# EAGLE schematic boardv2a (EAGLE 6.6.0), part 1 of 2

## Sheet 1 of 28

## Sheet 2 of 28: connector block
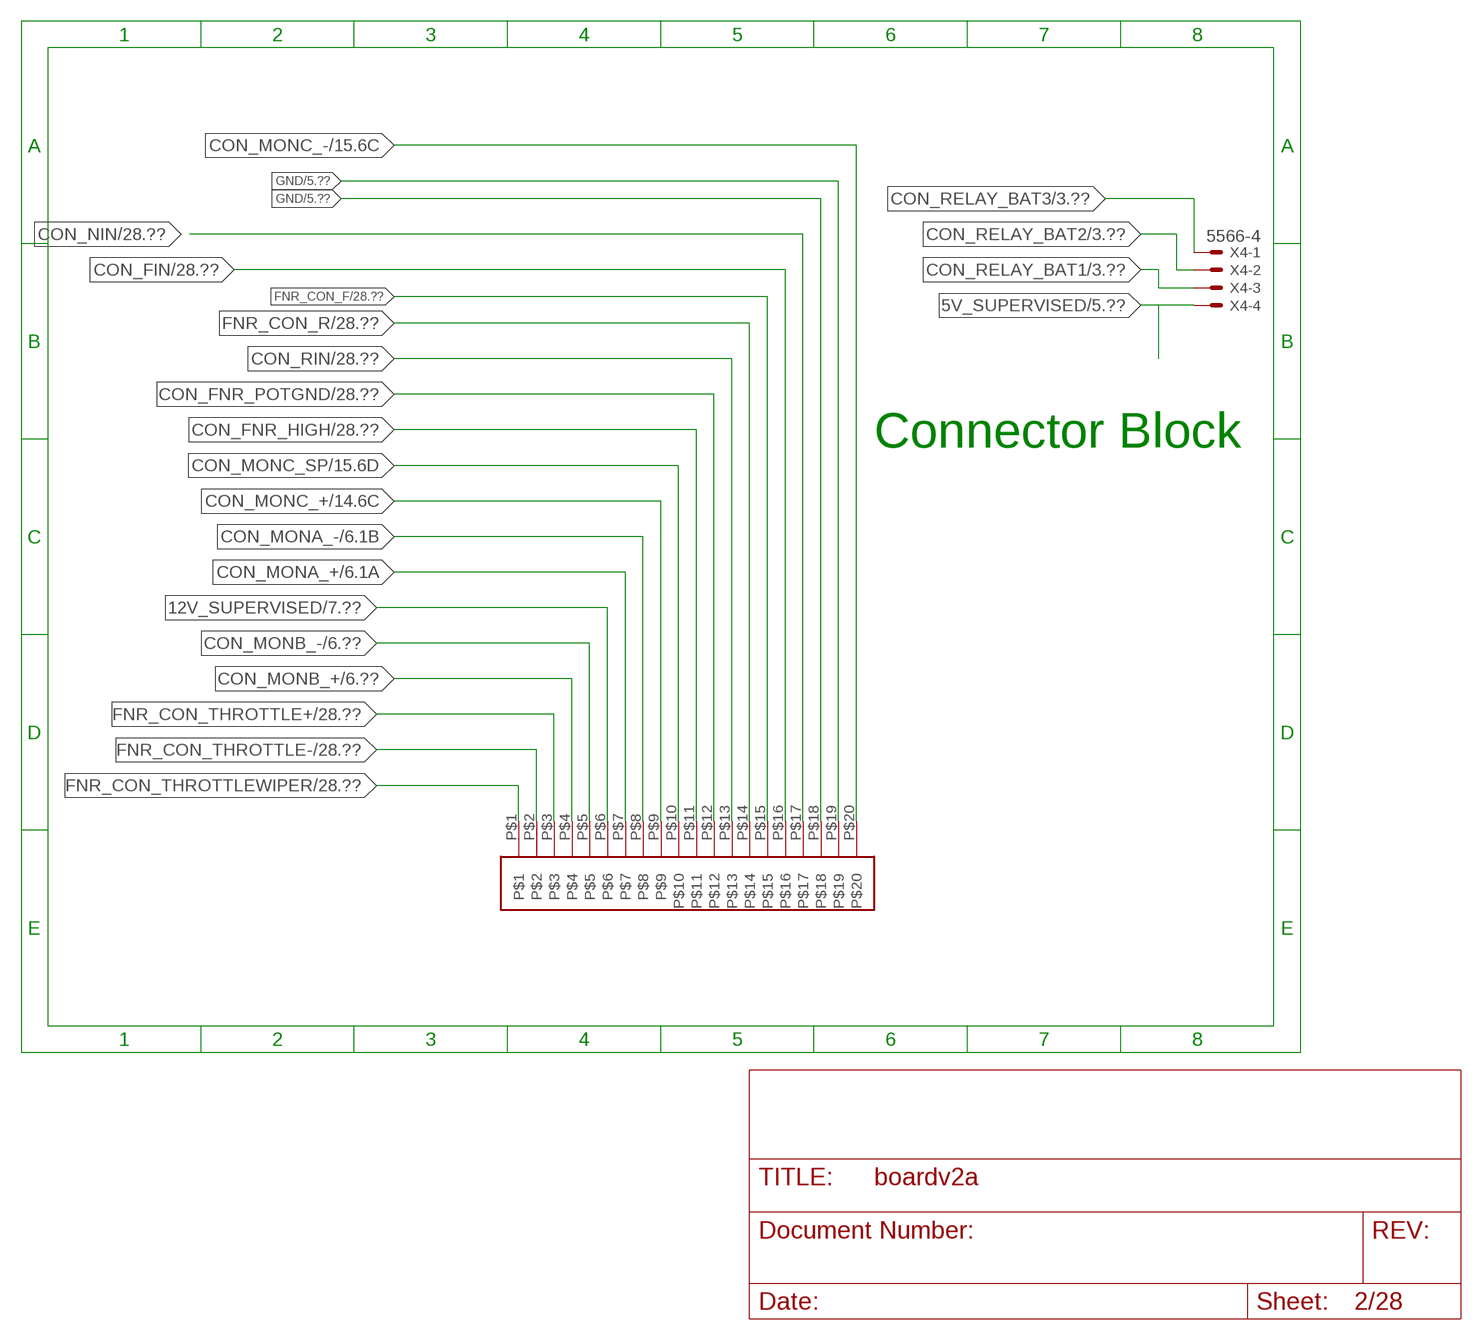
[diagram p0: schematic, sheet 2]

### Parts
U$5  34830-2001  [34830-2001]
X4  5566-4  [5566-4]

### Nets
5V_SUPERVISED: X4.4 ; also sheet 5,7,13,14,15,19,20,21,22,23,24,25,26
12V_SUPERVISED: U$5.P$6 ; also sheet 7
CON_FIN: U$5.P$16 ; also sheet 28
CON_FNR_HIGH: U$5.P$11 ; also sheet 28
CON_FNR_POTGND: U$5.P$12 ; also sheet 28
CON_MONA_+: U$5.P$7 ; also sheet 6,13
CON_MONA_-: U$5.P$8 ; also sheet 6,13
CON_MONB_+: U$5.P$4 ; also sheet 6,13,14
CON_MONB_-: U$5.P$5 ; also sheet 6,14,28
CON_MONC_+: U$5.P$9 ; also sheet 14,15
CON_MONC_-: U$5.P$20 ; also sheet 15
CON_MONC_SP: U$5.P$10 ; also sheet 15
CON_NIN: U$5.P$17 ; also sheet 28
CON_RELAY_BAT1: X4.3 ; also sheet 3
CON_RELAY_BAT2: X4.2 ; also sheet 3
CON_RELAY_BAT3: X4.1 ; also sheet 3
CON_RIN: U$5.P$13 ; also sheet 28
FNR_CON_F: U$5.P$15 ; also sheet 28
FNR_CON_R: U$5.P$14 ; also sheet 28
FNR_CON_THROTTLE+: U$5.P$3 ; also sheet 28
FNR_CON_THROTTLE-: U$5.P$2 ; also sheet 28
FNR_CON_THROTTLEWIPER: U$5.P$1 ; also sheet 28
GND: U$5.P$18 U$5.P$19 ; also sheet 3,4,5,6,7,8,9,12,13,14,15,17,18,19,20,21,22,23,24,25,26,28

### Notes on the sheet
- Connector Block

## Sheet 3 of 28: Relay
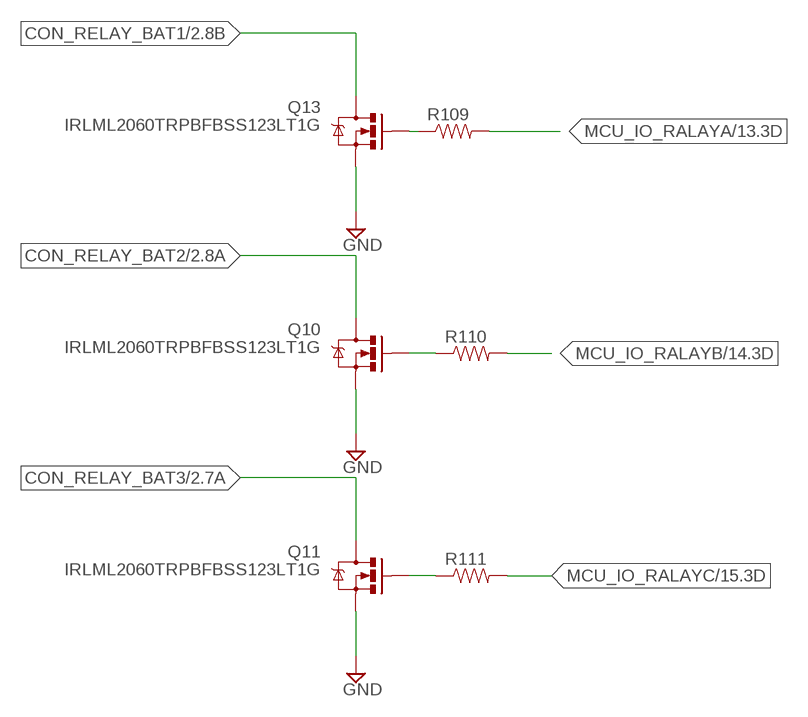
[diagram p1: schematic, sheet 3]

### Parts
Q10  IRLML2060TRPBFBSS123LT1G  [SOT23-3]
Q11  IRLML2060TRPBFBSS123LT1G  [SOT23-3]
Q13  IRLML2060TRPBFBSS123LT1G  [SOT23-3]
R109  RESISTOR0603-RES  [0603-RES]
R110  RESISTOR0603-RES  [0603-RES]
R111  RESISTOR0603-RES  [0603-RES]

### Nets
CON_RELAY_BAT1: Q13.3(D) ; also sheet 2
CON_RELAY_BAT2: Q10.3(D) ; also sheet 2
CON_RELAY_BAT3: Q11.3(D) ; also sheet 2
GND: Q10.2(S) Q11.2(S) Q13.2(S) ; also sheet 2,4,5,6,7,8,9,12,13,14,15,17,18,19,20,21,22,23,24,25,26,28
MCU_IO_RALAYA: R109.2 ; also sheet 13
MCU_IO_RALAYB: R110.2 ; also sheet 14
MCU_IO_RALAYC: R111.2 ; also sheet 15
N$252: Q13.1(G) R109.1
N$255: Q11.1(G) R111.1
N$257: Q10.1(G) R110.1

## Sheet 4 of 28: SPI to USB
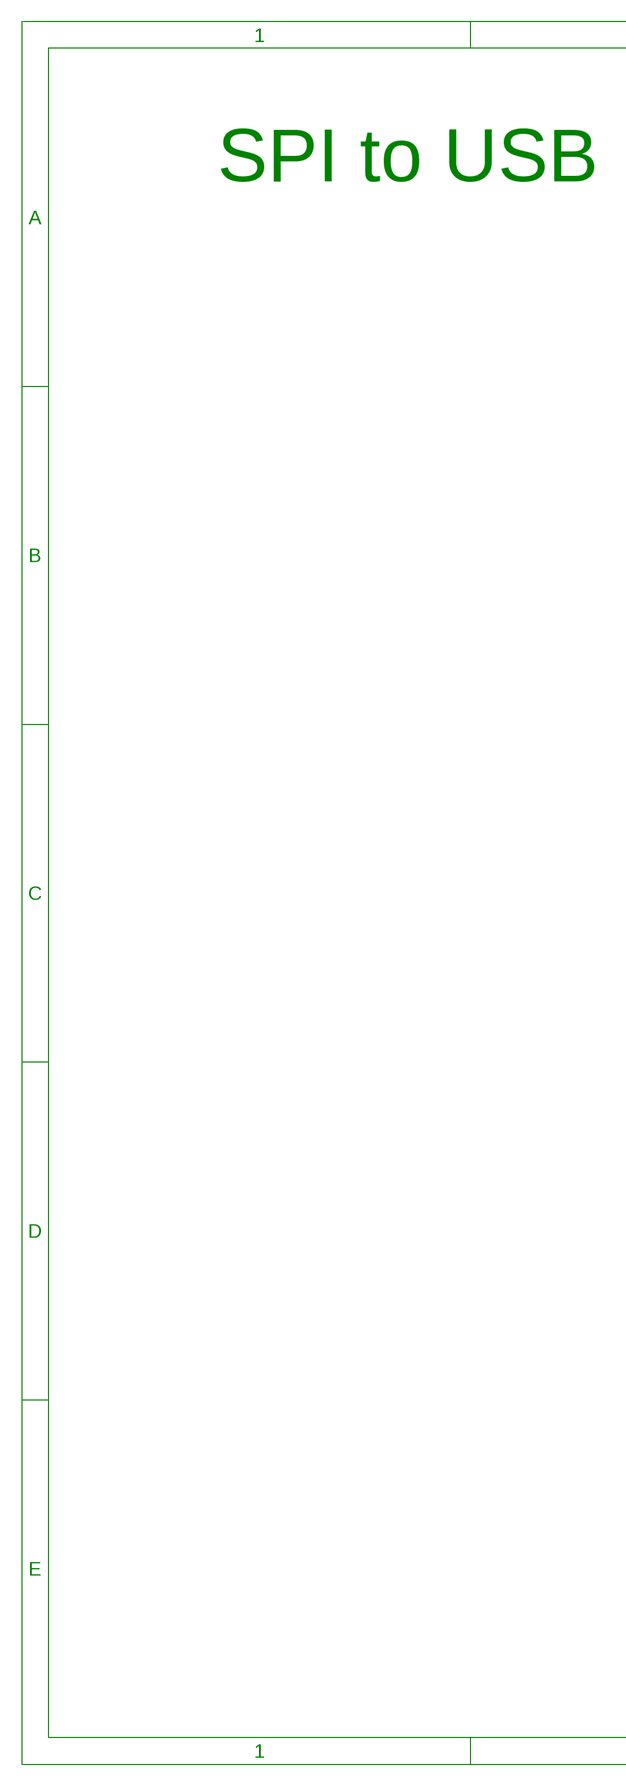
[diagram p2: schematic, sheet 4, part 1 of 2]
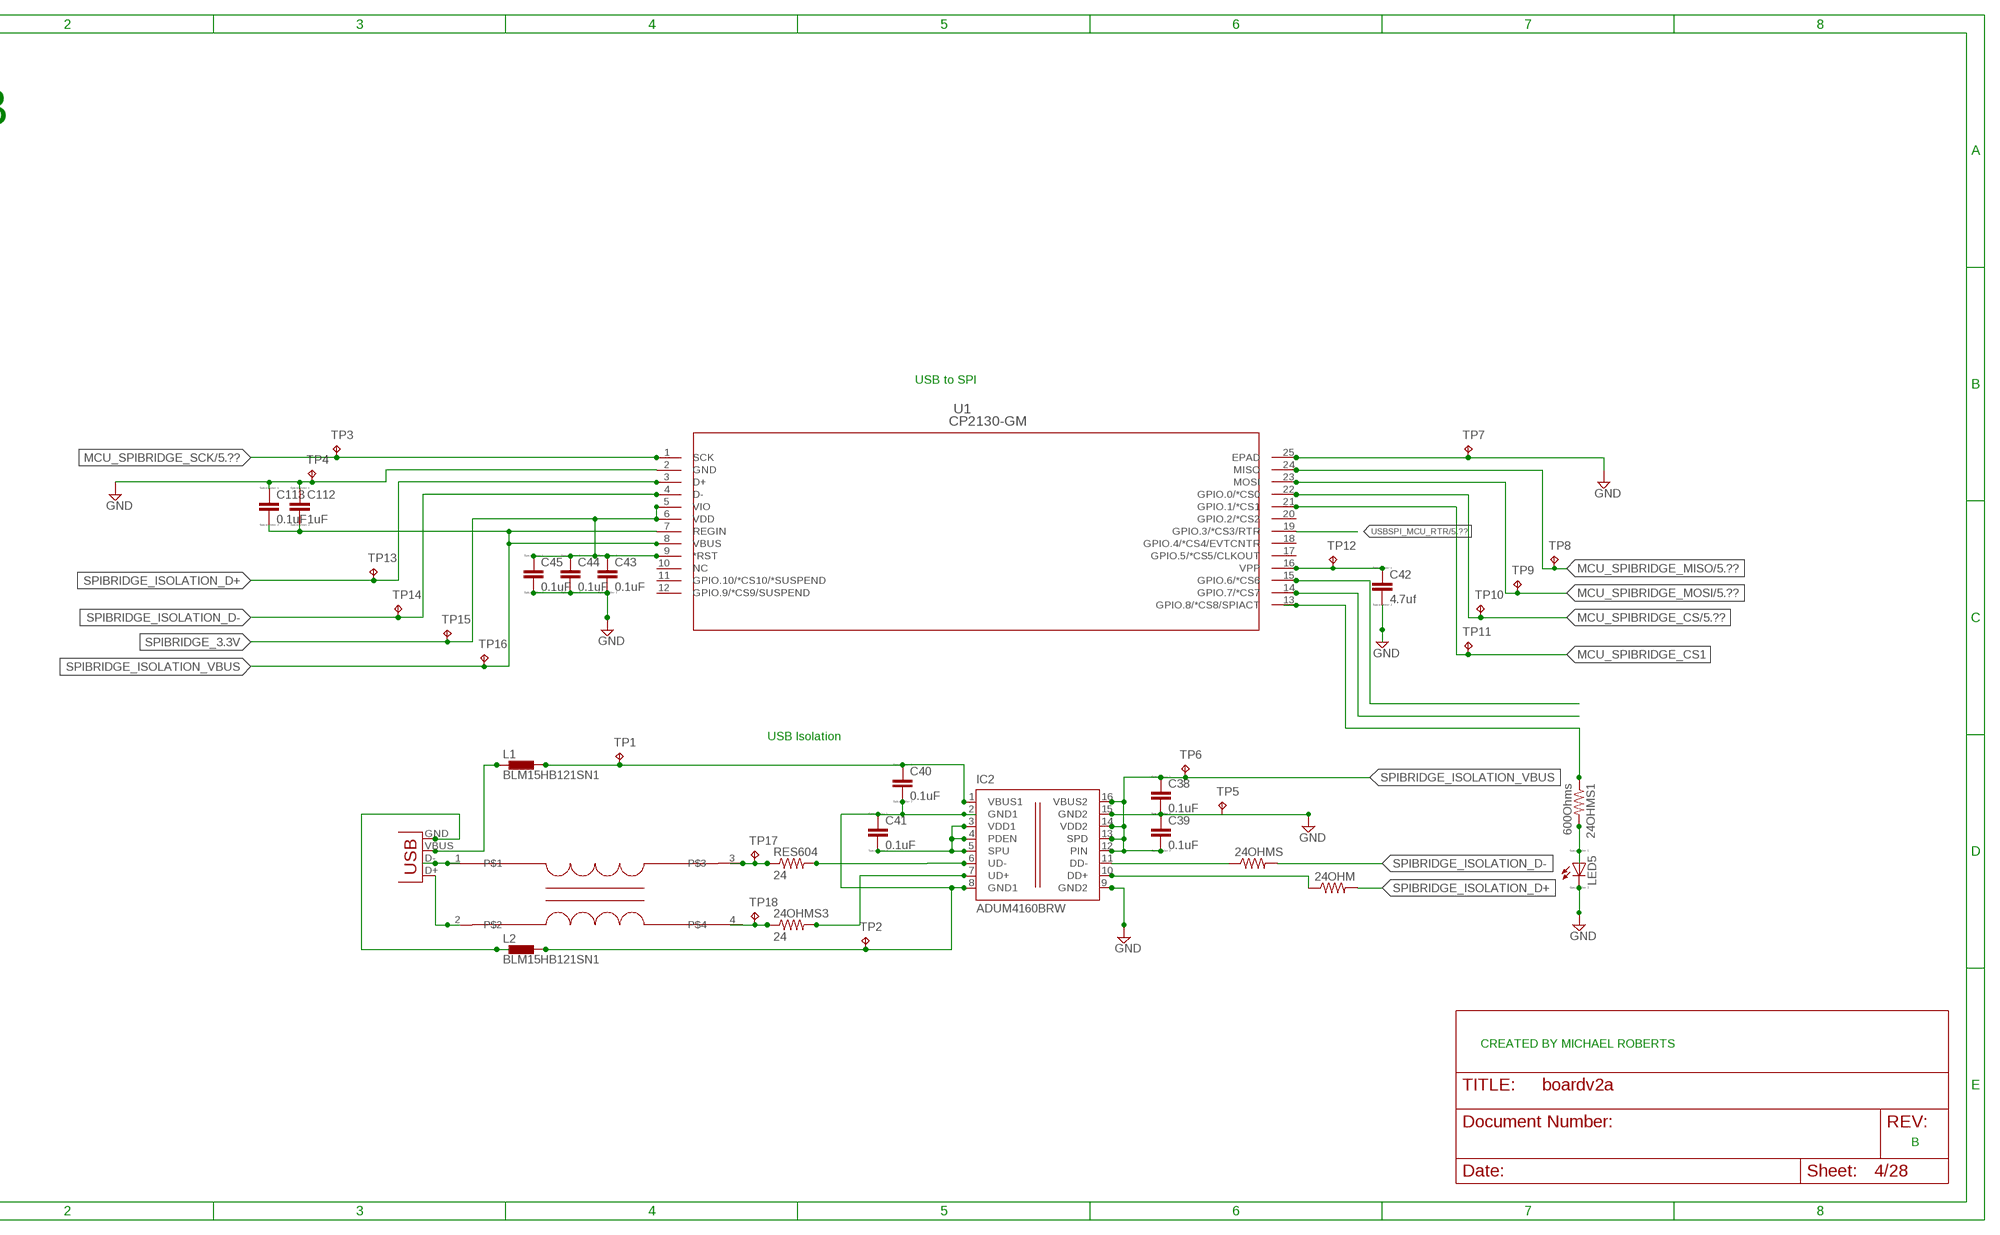
[diagram p3: schematic, sheet 4, part 2 of 2]

### Parts
24OHM  RESISTOR0603-RES  [0603-RES]
24OHMS  RESISTOR0603-RES  [0603-RES]
24OHMS1  600Ohms  RESISTOR0603-RES  [0603-RES]
24OHMS3  24  RESISTOR0603-RES  [0603-RES]
C38  0.1uF  CC0603  [C0603]
C39  0.1uF  CC0603  [C0603]
C40  0.1uF  CC0603  [C0603]
C41  0.1uF  CC0603  [C0603]
C42  4.7uf  CC0603  [C0603]
C43  0.1uF  CC0603  [C0603]
C44  0.1uF  CC0603  [C0603]
C45  0.1uF  CC0603  [C0603]
C112  1uF  CC0603  [C0603]
C113  0.1uF  CC0603  [C0603]
IC2  ADUM4160BRW  [SO16W]
JP81  USB-B  USBPTH  [USB-B-PTH]
L1  BLM15HB121SN1  [0402]
L2  BLM15HB121SN1  [0402]
LED5  LED_E  [LED_1206]
RES604  24  RESISTOR0603-RES  [0603-RES]
TP1  TPB1,27  [B1,27]
TP2  TPB1,27  [B1,27]
TP3  TPB1,27  [B1,27]
TP4  TPB1,27  [B1,27]
TP5  TPB1,27  [B1,27]
TP6  TPB1,27  [B1,27]
TP7  TPB1,27  [B1,27]
TP8  TPB2,54  [B2,54]
TP9  TPB2,54  [B2,54]
TP10  TPB2,54  [B2,54]
TP11  TPB2,54  [B2,54]
TP12  TPB1,27  [B1,27]
TP13  TPB1,27  [B1,27]
TP14  TPB1,27  [B1,27]
TP15  TPB1,27  [B1,27]
TP16  TPB1,27  [B1,27]
TP17  TPB2,54  [B2,54]
TP18  TPB2,54  [B2,54]
U1  CP2130-GM  [QFN24_4X4]
U$8  RFCMF1220100M3T  [RFCMF1220100M3T]

### Nets
GND: C38.2 C39.1 C42.2 C43.2 C44.2 C45.2 C112.1 C113.1 IC2.9(GND2) IC2.15(GND2) LED5.C TP4.TP TP5.TP TP7.TP U1.2(GND) U1.25(EPAD) ; also sheet 2,3,5,6,7,8,9,12,13,14,15,17,18,19,20,21,22,23,24,25,26,28
MCU_SPIBRIDGE_CS: TP10.TP U1.22(GPIO.0/*CS0) ; also sheet 5
MCU_SPIBRIDGE_CS1: TP11.TP U1.21(GPIO.1/*CS1)
MCU_SPIBRIDGE_MISO: TP8.TP U1.24(MISO) ; also sheet 5
MCU_SPIBRIDGE_MOSI: TP9.TP U1.23(MOSI) ; also sheet 5
MCU_SPIBRIDGE_SCK: TP3.TP U1.1(SCK) ; also sheet 5
N$114: 24OHMS.1 IC2.11(DD-)
N$115: 24OHMS3.1 TP18.TP U$8.4
N$144: 24OHMS3.2 IC2.7(UD+)
N$145: C40.2 C41.1 IC2.2(GND1) IC2.8(GND1) L2.2 TP2.TP
N$146: C40.1 IC2.1(VBUS1) L1.2 TP1.TP
N$148: JP81.D- U$8.1
N$149: JP81.D+ U$8.2
N$150: JP81.GND L2.1
N$151: C41.2 IC2.3(VDD1) IC2.4(PDEN) IC2.5(SPU)
N$152: C42.1 TP12.TP U1.16(VPP)
N$154: JP81.VBUS L1.1
N$155: 24OHMS1.1 U1.13(GPIO.8/*CS8/SPIACT)
N$156: U1.14(GPIO.7/*CS7)
N$157: U1.15(GPIO.6/*CS6)
N$158: 24OHMS1.2 LED5.A
N$159: IC2.6(UD-) RES604.2
N$160: RES604.1 TP17.TP U$8.3
N$162: 24OHM.1 IC2.10(DD+)
SPIBRIDGE_3.3V: C43.1 C44.1 C45.1 TP15.TP U1.5(VIO) U1.6(VDD) U1.9(*RST)
SPIBRIDGE_ISOLATION_D+: 24OHM.2 TP13.TP U1.3(D+)
SPIBRIDGE_ISOLATION_D-: 24OHMS.2 TP14.TP U1.4(D-)
SPIBRIDGE_ISOLATION_VBUS: C38.1 C39.2 C112.2 C113.2 IC2.12(PIN) IC2.13(SPD) IC2.14(VDD2) IC2.16(VBUS2) TP6.TP TP16.TP U1.7(REGIN) U1.8(VBUS)
USBSPI_MCU_RTR: U1.19(GPIO.3/*CS3/RTR) ; also sheet 5
Unconnected: U1.10(NC) U1.11(GPIO.10/*CS10/*SUSPEND) U1.12(GPIO.9/*CS9/SUSPEND) U1.17(GPIO.5/*CS5/CLKOUT) U1.18(GPIO.4/*CS4/EVTCNTR) U1.20(GPIO.2/*CS2)

### Notes on the sheet
- SPI to USB
- USB to SPI
- USB Isolation
- CREATED BY MICHAEL ROBERTS
- B

## Sheet 5 of 28: MCU Block
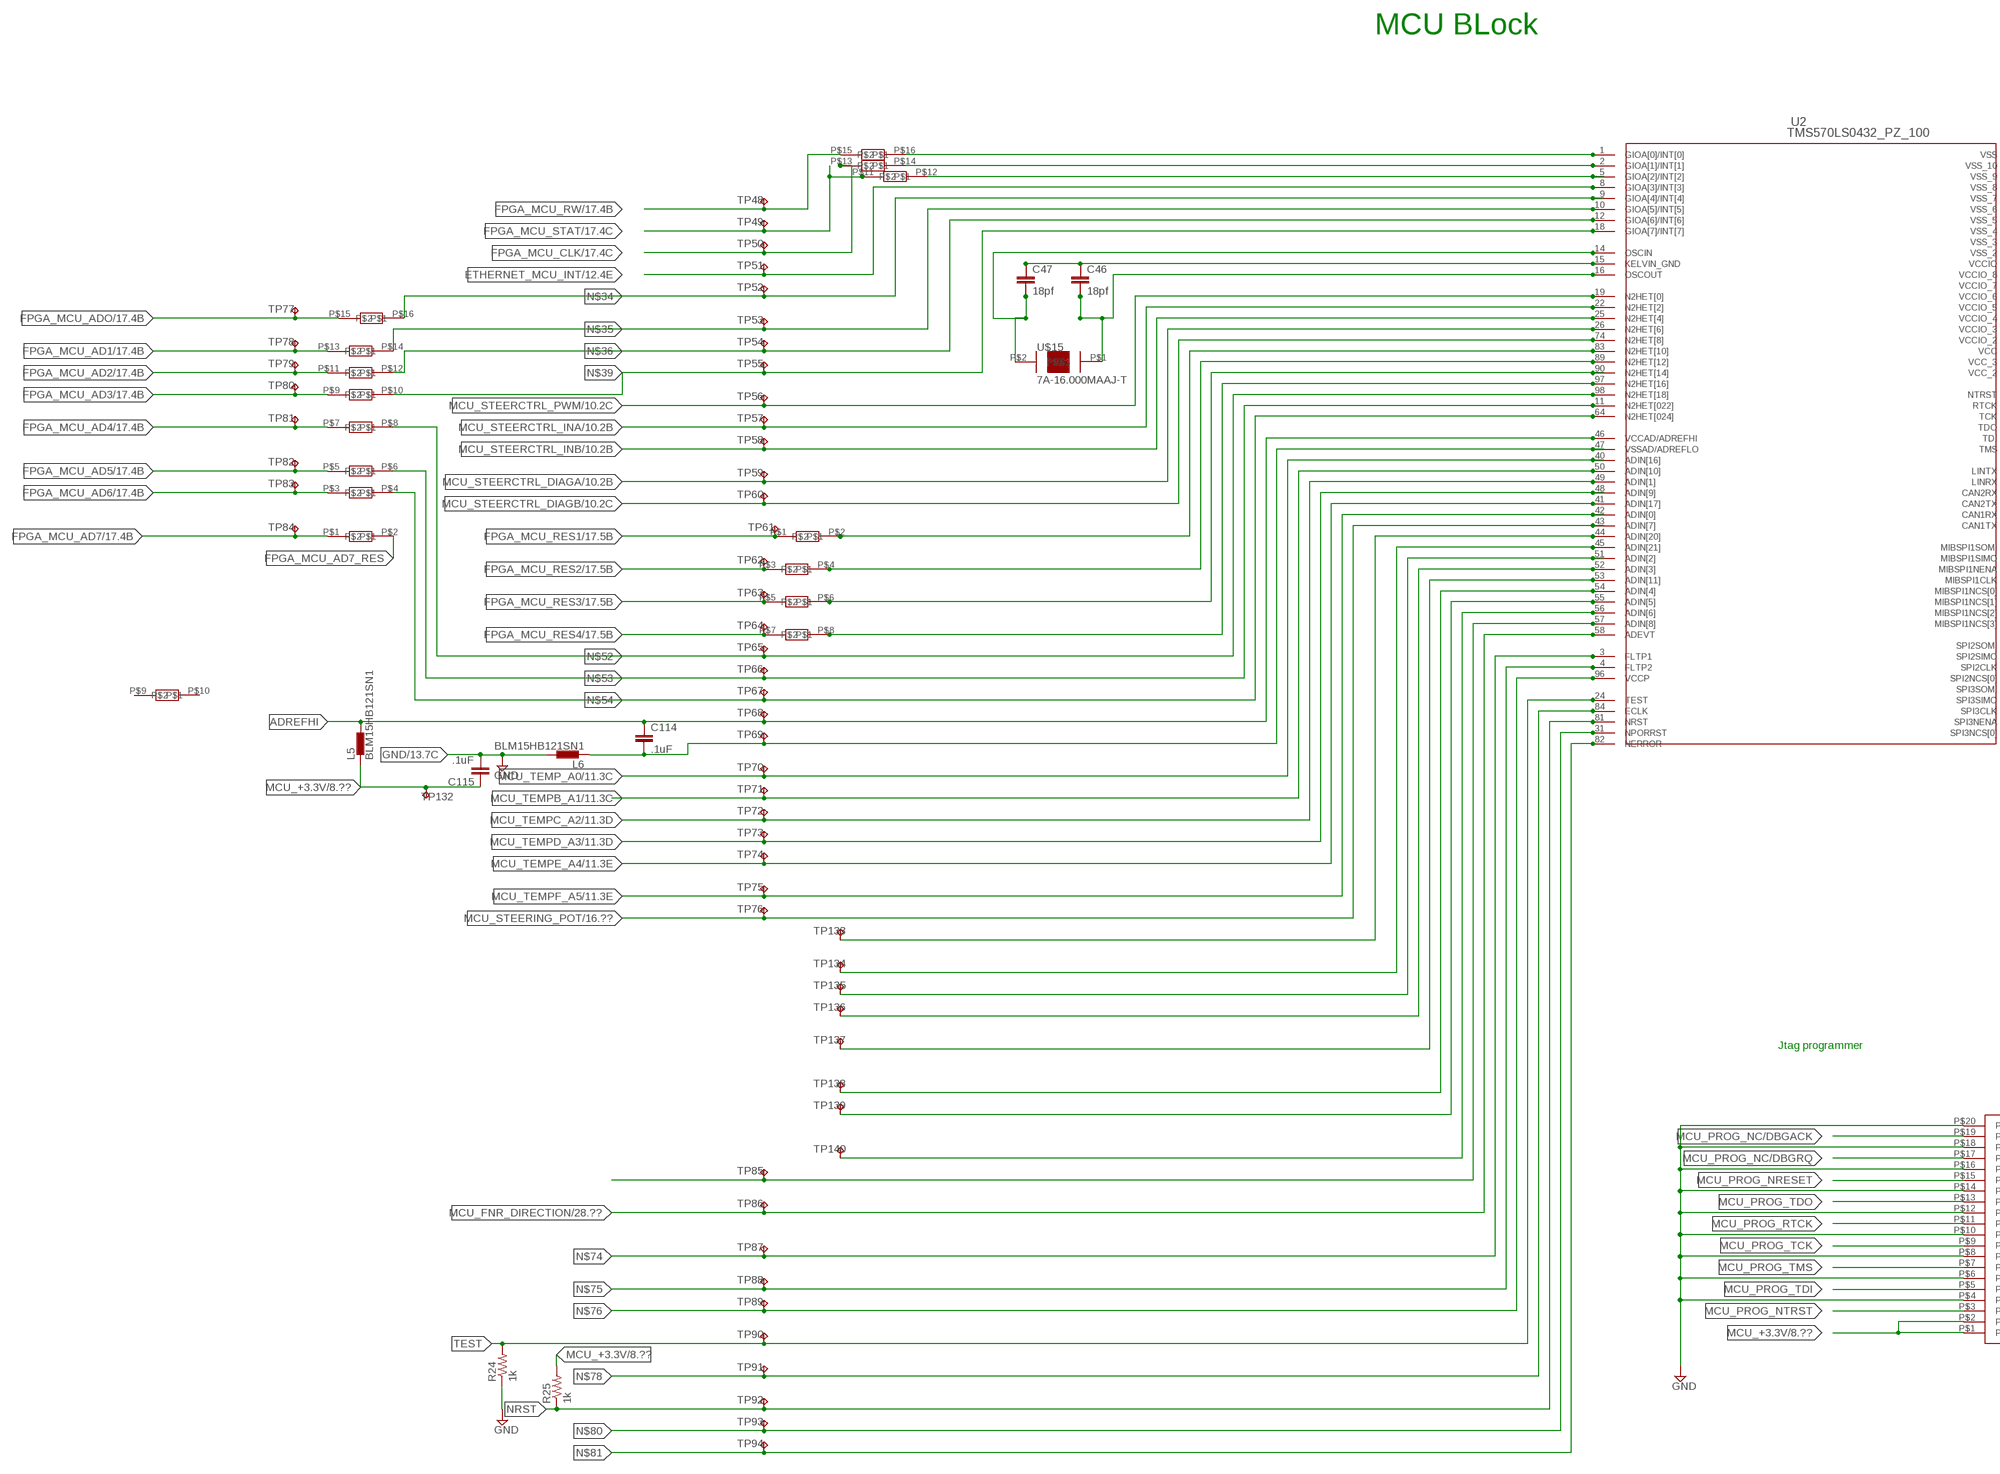
[diagram p4: schematic, sheet 5, part 1 of 2]
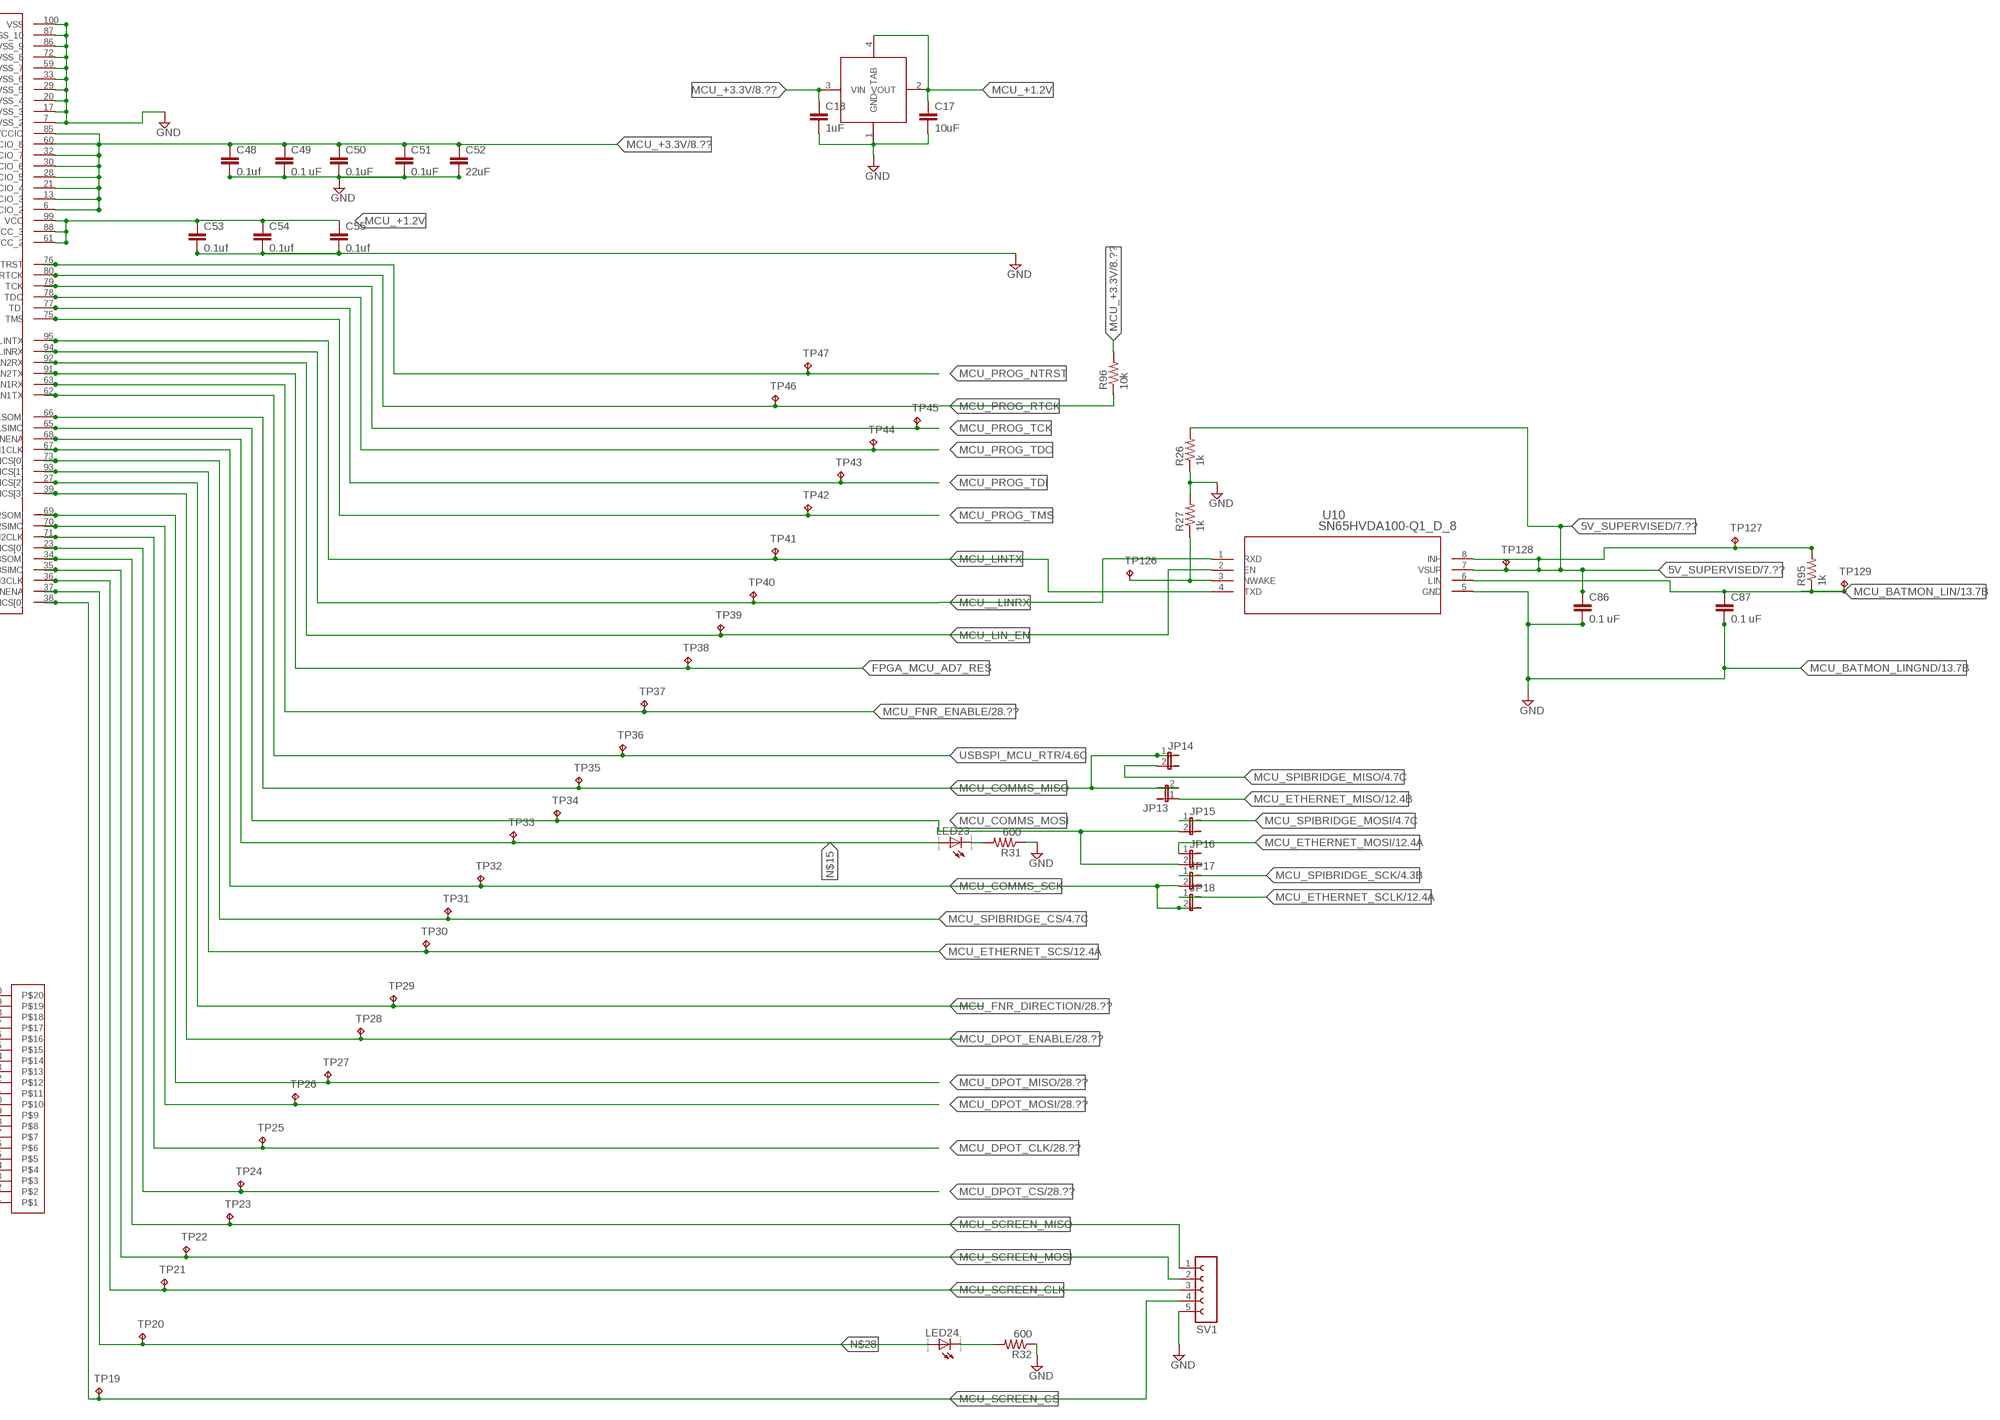
[diagram p5: schematic, sheet 5, part 2 of 2]

### Parts
C17  10uF  CAP0603-CAP  [0603-CAP]
C18  1uF  CAP0603-CAP  [0603-CAP]
C46  18pf  C-EUC0402  [C0402]
C47  18pf  C-EUC0402  [C0402]
C48  0.1uf  C-EUC0402  [C0402]
C49  0.1 uF  C-EUC0402  [C0402]
C50  0.1uF  C-EUC0402  [C0402]
C51  0.1uF  C-EUC0402  [C0402]
C52  22uF  C-EUC0603  [C0603]
C53  0.1uf  C-EUC0402  [C0402]
C54  0.1uf  C-EUC0402  [C0402]
C55  0.1uf  C-EUC0402  [C0402]
C86  0.1 uF  C-EUC0402  [C0402]
C87  0.1 uF  C-EUC0402  [C0402]
C114  .1uF  C-EUC0402  [C0402]
C115  .1uF  C-EUC0402  [C0402]
JP13  JP1E  [JP1]
JP14  JP1E  [JP1]
JP15  JP1E  [JP1]
JP16  JP1E  [JP1]
JP17  JP1E  [JP1]
JP18  JP1E  [JP1]
L5  BLM15HB121SN1  [0402]
L6  BLM15HB121SN1  [0402]
LED23  LED_E  [LED_1206]
LED24  LED_E  [LED_1206]
R24  1k  RESISTOR0603-RES  [0603-RES]
R25  1k  RESISTOR0603-RES  [0603-RES]
R26  1k  RESISTOR0603-RES  [0603-RES]
R27  1k  RESISTOR0603-RES  [0603-RES]
R31  600  RESISTOR0603-RES  [0603-RES]
R32  600  RESISTOR0603-RES  [0603-RES]
R95  1k  RESISTOR0603-RES  [0603-RES]
R96  10k  RESISTOR0603-RES  [0603-RES]
SV1  FE05-1  [FE05-1]
TP19  TPB2,54  [B2,54]
TP20  TPB2,54  [B2,54]
TP21  TPB2,54  [B2,54]
TP22  TPB2,54  [B2,54]
TP23  TPB2,54  [B2,54]
TP24  TPB2,54  [B2,54]
TP25  TPB2,54  [B2,54]
TP26  TPB2,54  [B2,54]
TP27  TPB2,54  [B2,54]
TP28  TPB2,54  [B2,54]
TP29  TPB2,54  [B2,54]
TP30  TPB2,54  [B2,54]
TP31  TPB2,54  [B2,54]
TP32  TPB2,54  [B2,54]
TP33  TPB2,54  [B2,54]
TP34  TPB2,54  [B2,54]
TP35  TPB2,54  [B2,54]
TP36  TPB2,54  [B2,54]
TP37  TPB2,54  [B2,54]
TP38  TPB2,54  [B2,54]
TP39  TPB2,54  [B2,54]
TP40  TPB2,54  [B2,54]
TP41  TPB2,54  [B2,54]
TP42  TPB2,54  [B2,54]
TP43  TPB2,54  [B2,54]
TP44  TPB2,54  [B2,54]
TP45  TPB2,54  [B2,54]
TP46  TPB2,54  [B2,54]
TP47  TPB2,54  [B2,54]
TP48  TPB2,54  [B2,54]
TP49  TPB2,54  [B2,54]
TP50  TPB2,54  [B2,54]
TP51  TPB2,54  [B2,54]
TP52  TPB2,54  [B2,54]
TP53  TPB2,54  [B2,54]
TP54  TPB2,54  [B2,54]
TP55  TPB2,54  [B2,54]
TP56  TPB2,54  [B2,54]
TP57  TPB2,54  [B2,54]
TP58  TPB2,54  [B2,54]
TP59  TPB2,54  [B2,54]
TP60  TPB2,54  [B2,54]
TP61  TPB2,54  [B2,54]
TP62  TPB2,54  [B2,54]
TP63  TPB2,54  [B2,54]
TP64  TPB2,54  [B2,54]
TP65  TPB2,54  [B2,54]
TP66  TPB2,54  [B2,54]
TP67  TPB2,54  [B2,54]
TP68  TPB2,54  [B2,54]
TP69  TPB2,54  [B2,54]
TP70  TPB2,54  [B2,54]
TP71  TPB2,54  [B2,54]
TP72  TPB2,54  [B2,54]
TP73  TPB2,54  [B2,54]
TP74  TPB2,54  [B2,54]
TP75  TPB2,54  [B2,54]
TP76  TPB2,54  [B2,54]
TP77  TPB2,54  [B2,54]
TP78  TPB2,54  [B2,54]
TP79  TPB2,54  [B2,54]
TP80  TPB2,54  [B2,54]
TP81  TPB2,54  [B2,54]
TP82  TPB2,54  [B2,54]
TP83  TPB2,54  [B2,54]
TP84  TPB2,54  [B2,54]
TP85  TPB2,54  [B2,54]
TP86  TPB2,54  [B2,54]
TP87  TPB2,54  [B2,54]
TP88  TPB2,54  [B2,54]
TP89  TPB2,54  [B2,54]
TP90  TPB2,54  [B2,54]
TP91  TPB2,54  [B2,54]
TP92  TPB2,54  [B2,54]
TP93  TPB2,54  [B2,54]
TP94  TPB2,54  [B2,54]
TP126  TPB2,54  [B2,54]
TP127  TPB2,54  [B2,54]
TP128  TPB2,54  [B2,54]
TP129  TPB2,54  [B2,54]
TP132  TPB2,54  [B2,54]
TP133  TPPAD1-13  [P1-13]
TP134  TPPAD1-13  [P1-13]
TP135  TPPAD1-13  [P1-13]
TP136  TPPAD1-13  [P1-13]
TP137  TPPAD1-13  [P1-13]
TP138  TPPAD1-13  [P1-13]
TP139  TPPAD1-13  [P1-13]
TP140  TPPAD1-13  [P1-13]
U2  TMS570LS0432_PZ_100  [PZ100]
U10  SN65HVDA100-Q1_D_8  [D8]
U$4  RHM1620CT-ND  [MNR18]
U$9  JTAG20PIN  [15-80-0201]
U$15  7A-16.000MAAJ-T  [2-SMD]
U$32  RHM1620CT-ND  [MNR18]
U$33  1.2VREG  [SOT-223]

### Nets
5V_SUPERVISED: C86.1 R26.2 R95.2 TP127.TP TP128.TP U10.7(VSUP) U10.8(INH) ; also sheet 2,7,13,14,15,19,20,21,22,23,24,25,26
ADREFHI: C114.1 L5.2 TP68.TP U2.46(VCCAD/ADREFHI)
ETHERNET_MCU_INT: TP51.TP U2.8(GIOA[3]/INT[3]) ; also sheet 12
FPGA_MCU_AD1: TP78.TP U$4.P$13 ; also sheet 17
FPGA_MCU_AD2: TP79.TP U$4.P$11 ; also sheet 17
FPGA_MCU_AD3: TP80.TP U$4.P$9 ; also sheet 17
FPGA_MCU_AD4: TP81.TP U$4.P$7 ; also sheet 17
FPGA_MCU_AD5: TP82.TP U$4.P$5 ; also sheet 17
FPGA_MCU_AD6: TP83.TP U$4.P$3 ; also sheet 17
FPGA_MCU_AD7: TP84.TP U$4.P$1 ; also sheet 17
FPGA_MCU_AD7_RES: TP38.TP U2.91(CAN2TX) U$4.P$2
FPGA_MCU_ADO: TP77.TP U$4.P$15 ; also sheet 17
FPGA_MCU_CLK: TP50.TP U$32.P$13 ; also sheet 17
FPGA_MCU_CLKJ: U2.5(GIOA[2]/INT[2]) U$32.P$12
FPGA_MCU_RES1: TP61.TP U$32.P$1 ; also sheet 17
FPGA_MCU_RES1_RES: U2.83(N2HET[10]) U$32.P$2
FPGA_MCU_RES2: TP62.TP U$32.P$3 ; also sheet 17
FPGA_MCU_RES2_RES: U2.89(N2HET[12]) U$32.P$4
FPGA_MCU_RES3: TP63.TP U$32.P$5 ; also sheet 17
FPGA_MCU_RES3_RES: U2.90(N2HET[14]) U$32.P$6
FPGA_MCU_RES4: TP64.TP U$32.P$7 ; also sheet 17
FPGA_MCU_RES4_RES: U2.97(N2HET[16]) U$32.P$8
FPGA_MCU_RW: TP48.TP U$32.P$15 ; also sheet 17
FPGA_MCU_RWJ: U2.1(GIOA[0]/INT[0]) U$32.P$16
FPGA_MCU_STAT: TP49.TP U$32.P$11 ; also sheet 17
FPGA_MCU_STATJ: U2.2(GIOA[1]/INT[1]) U$32.P$14
GND: C17.2 C18.2 C48.2 C49.2 C50.2 C51.2 C52.2 C53.2 C54.2 C55.2 C115.2 L6.2 R24.1 R26.1 R27.2 R31.1 R32.1 SV1.5 U2.7(VSS_2) U2.17(VSS_3) U2.20(VSS_4) U2.29(VSS_5) U2.33(VSS_6) U2.59(VSS_7) U2.72(VSS_8) U2.86(VSS_9) U2.87(VSS_10) U2.100(VSS) U$9.P$4 U$9.P$6 U$9.P$8 U$9.P$10 U$9.P$12 U$9.P$14 U$9.P$16 U$9.P$18 U$9.P$20 U$33.1(GND) ; also sheet 2,3,4,6,7,8,9,12,13,14,15,17,18,19,20,21,22,23,24,25,26,28
MCU_+1.2V: C17.1 C53.1 C54.1 C55.1 U2.61(VCC_2) U2.88(VCC_3) U2.99(VCC) U$33.2(VOUT) U$33.4(TAB)
MCU_+3.3V: C18.1 C48.1 C49.1 C50.1 C51.1 C52.1 C115.1 L5.1 R25.2 R96.2 TP132.TP U2.6(VCCIO_2) U2.13(VCCIO_3) U2.21(VCCIO_4) U2.28(VCCIO_5) U2.30(VCCIO_6) U2.32(VCCIO_7) U2.60(VCCIO_8) U2.85(VCCIO) U$9.P$1 U$9.P$2 U$33.3(VIN) ; also sheet 8,11,16,28
MCU__LINRX: TP40.TP U2.94(LINRX) U10.1(RXD)
MCU_A_GND: C114.2 L6.1 TP69.TP U2.47(VSSAD/ADREFLO) ; also sheet 11,16
MCU_BATMON_LIN: C87.1 R95.1 TP129.TP U10.6(LIN) ; also sheet 13,14,15
MCU_BATMON_LINGND: C86.2 C87.2 U10.5(GND) ; supply symbol labelled GND ; also sheet 13,14,15
MCU_COMMS_MISO: JP13.2 JP14.1 TP35.TP U2.66(MIBSPI1SOMI)
MCU_COMMS_MOSI: JP15.2 JP16.2 TP34.TP U2.65(MIBSPI1SIMO)
MCU_COMMS_SCK: JP17.2 JP18.2 TP32.TP U2.67(MIBSPI1CLK)
MCU_DPOT_CLK: TP25.TP U2.71(SPI2CLK) ; also sheet 28
MCU_DPOT_CS: TP24.TP U2.23(SPI2NCS[0]) ; also sheet 28
MCU_DPOT_ENABLE: TP28.TP U2.39(MIBSPI1NCS[3]) ; also sheet 28
MCU_DPOT_MISO: TP27.TP U2.69(SPI2SOMI) ; also sheet 28
MCU_DPOT_MOSI: TP26.TP U2.70(SPI2SIMO) ; also sheet 28
MCU_ETHERNET_MISO: JP13.1 ; also sheet 12
MCU_ETHERNET_MOSI: JP16.1 ; also sheet 12
MCU_ETHERNET_SCLK: JP18.1 ; also sheet 12
MCU_ETHERNET_SCS: TP30.TP U2.93(MIBSPI1NCS[1]) ; also sheet 12
MCU_FNR_DIRECTION: TP29.TP TP86.TP U2.27(MIBSPI1NCS[2]) U2.58(ADEVT) ; also sheet 28
MCU_FNR_ENABLE: TP37.TP U2.63(CAN1RX) ; also sheet 28
MCU_LIN_EN: TP39.TP U2.92(CAN2RX) U10.2(EN)
MCU_LINTX: TP41.TP U2.95(LINTX) U10.4(TXD)
MCU_PROG_NC/DBGACK: U$9.P$19
MCU_PROG_NC/DBGRQ: U$9.P$17
MCU_PROG_NRESET: U$9.P$15
MCU_PROG_NTRST: TP47.TP U2.76(NTRST) U$9.P$3
MCU_PROG_RTCK: R96.1 TP46.TP U2.80(RTCK) U$9.P$11
MCU_PROG_TCK: TP45.TP U2.79(TCK) U$9.P$9
MCU_PROG_TDI: TP43.TP U2.77(TDI) U$9.P$5
MCU_PROG_TDO: TP44.TP U2.78(TDO) U$9.P$13
MCU_PROG_TMS: TP42.TP U2.75(TMS) U$9.P$7
MCU_SCREEN_CLK: SV1.3 TP21.TP U2.36(SPI3CLK)
MCU_SCREEN_CS: SV1.4 TP19.TP U2.38(SPI3NCS[0])
MCU_SCREEN_MISO: SV1.1 TP23.TP U2.34(SPI3SOMI)
MCU_SCREEN_MOSI: SV1.2 TP22.TP U2.35(SPI3SIMO)
MCU_SPIBRIDGE_CS: TP31.TP U2.73(MIBSPI1NCS[0]) ; also sheet 4
MCU_SPIBRIDGE_MISO: JP14.2 ; also sheet 4
MCU_SPIBRIDGE_MOSI: JP15.1 ; also sheet 4
MCU_SPIBRIDGE_SCK: JP17.1 ; also sheet 4
MCU_STEERCTRL_DIAGA: TP59.TP U2.26(N2HET[6]) ; also sheet 10
MCU_STEERCTRL_DIAGB: TP60.TP U2.74(N2HET[8]) ; also sheet 10
MCU_STEERCTRL_INA: TP57.TP U2.22(N2HET[2]) ; also sheet 10
MCU_STEERCTRL_INB: TP58.TP U2.25(N2HET[4]) ; also sheet 10
MCU_STEERCTRL_PWM: TP56.TP U2.19(N2HET[0]) ; also sheet 10
MCU_STEERING_POT: TP76.TP U2.43(ADIN[7]) ; also sheet 16
MCU_TEMP_A0: TP70.TP U2.40(ADIN[16]) ; also sheet 11
MCU_TEMPB_A1: TP71.TP U2.50(ADIN[10]) ; also sheet 11
MCU_TEMPC_A2: TP72.TP U2.49(ADIN[1]) ; also sheet 11
MCU_TEMPD_A3: TP73.TP U2.48(ADIN[9]) ; also sheet 11
MCU_TEMPE_A4: TP74.TP U2.41(ADIN[17]) ; also sheet 11
MCU_TEMPF_A5: TP75.TP U2.42(ADIN[0]) ; also sheet 11
N$15: LED23.A TP33.TP U2.68(MIBSPI1NENA)
N$18: LED23.C R31.2
N$22: LED24.C R32.2
N$28: LED24.A TP20.TP U2.37(SPI3NENA)
N$34: TP52.TP U2.9(GIOA[4]/INT[4]) U$4.P$16
N$35: TP53.TP U2.10(GIOA[5]/INT[5]) U$4.P$14
N$36: TP54.TP U2.12(GIOA[6]/INT[6]) U$4.P$12
N$39: TP55.TP U2.18(GIOA[7]/INT[7]) U$4.P$10
N$52: TP65.TP U2.98(N2HET[18]) U$4.P$8
N$53: TP66.TP U2.11(N2HET[022]) U$4.P$6
N$54: TP67.TP U2.64(N2HET[024]) U$4.P$4
N$74: TP87.TP U2.3(FLTP1)
N$75: TP88.TP U2.4(FLTP2)
N$76: TP89.TP U2.96(VCCP)
N$78: TP91.TP U2.84(ECLK)
N$80: TP93.TP U2.31(NPORRST)
N$81: TP94.TP U2.82(NERROR)
N$116: R27.1 TP126.TP U10.3(NWAKE)
N$164: C46.1 C47.1 U2.15(KELVIN_GND)
N$165: C47.2 U2.14(OSCIN) U$15.P$2
N$166: C46.2 U2.16(OSCOUT) U$15.P$1
N$300: TP85.TP U2.57(ADIN[8])
N$306: TP133.TP U2.44(ADIN[20])
N$307: TP134.TP U2.45(ADIN[21])
N$308: TP135.TP U2.51(ADIN[2])
N$309: TP136.TP U2.52(ADIN[3])
N$310: TP137.TP U2.53(ADIN[11])
N$311: TP138.TP U2.54(ADIN[4])
N$312: TP139.TP U2.55(ADIN[5])
N$313: TP140.TP U2.56(ADIN[6])
NRST: R25.1 TP92.TP U2.81(NRST)
TEST: R24.2 TP90.TP U2.24(TEST)
USBSPI_MCU_RTR: TP36.TP U2.62(CAN1TX) ; also sheet 4
Unconnected: U$32.P$9 U$32.P$10

### Notes on the sheet
- MCU BLock
- Jtag programmer

## Sheet 6 of 28: Power Regulators
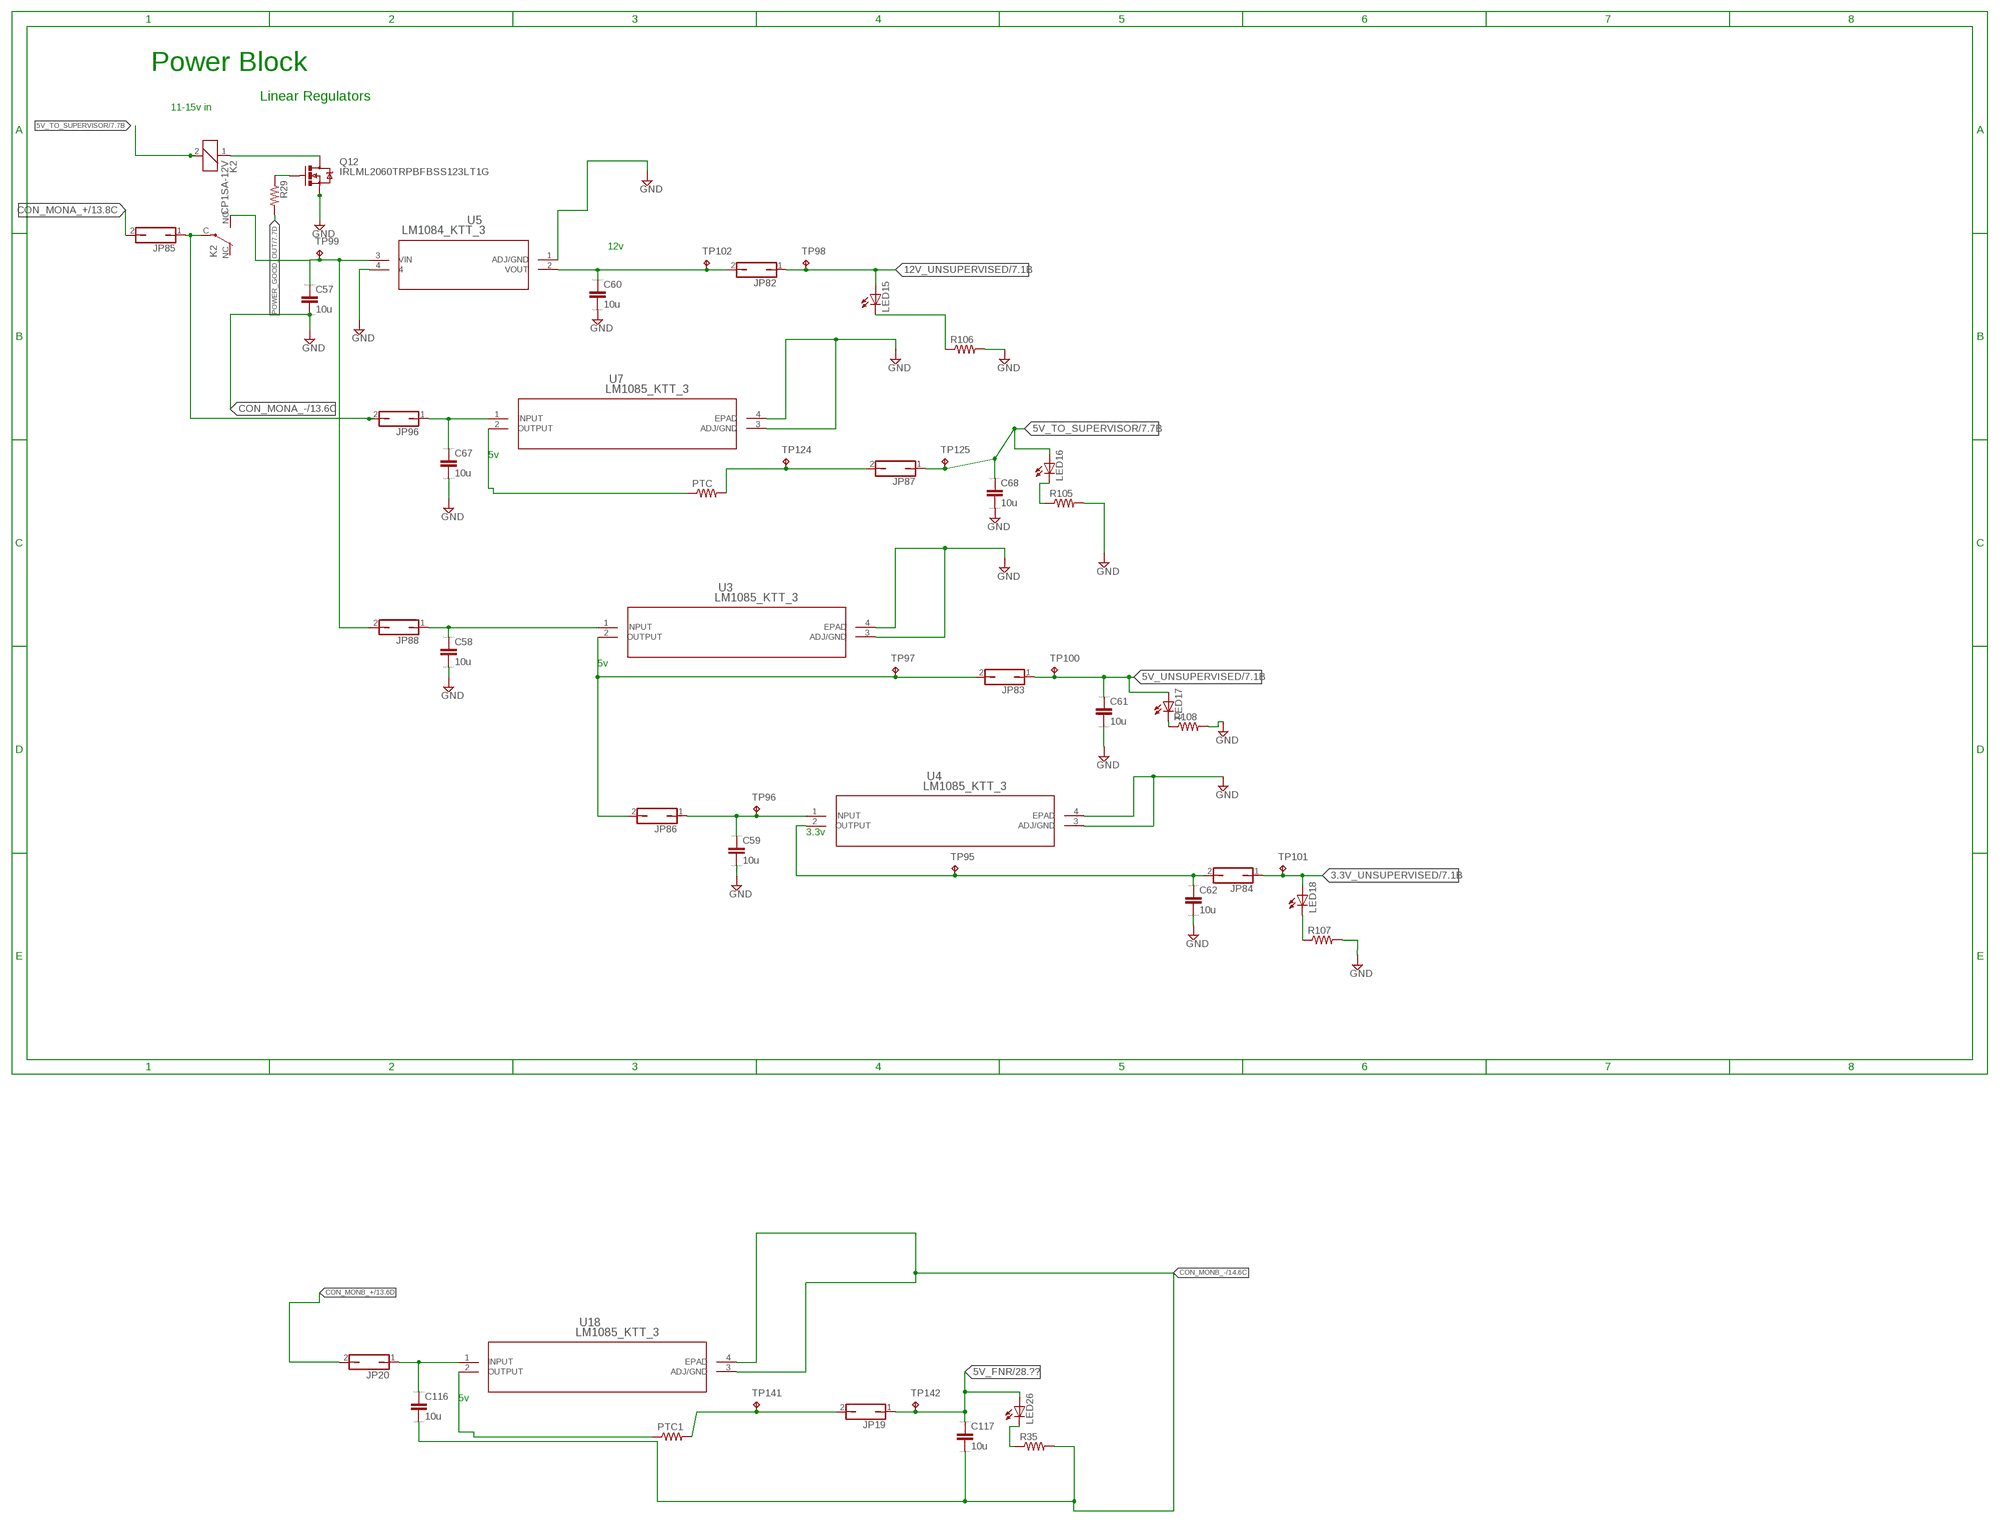
[diagram p6: schematic, sheet 6]

### Parts
C57  10u  CC0603  [C0603]
C58  10u  CC0603  [C0603]
C59  10u  CC0603  [C0603]
C60  10u  CC0603  [C0603]
C61  10u  CC0603  [C0603]
C62  10u  CC0603  [C0603]
C67  10u  CC0603  [C0603]
C68  10u  CC0603  [C0603]
C116  10u  CC0603  [C0603]
C117  10u  CC0603  [C0603]
JP19  JP1Q  [JP1]
JP20  JP1Q  [JP1]
JP82  JP1Q  [JP1]
JP83  JP1Q  [JP1]
JP84  JP1Q  [JP1]
JP85  JP1Q  [JP1]
JP86  JP1Q  [JP1]
JP87  JP1Q  [JP1]
JP88  JP1Q  [JP1]
JP96  JP1Q  [JP1]
K2  CP1SA-12V  [CP1SA]
LED15  LEDSML1206  [SML1206]
LED16  LEDSML1206  [SML1206]
LED17  LEDSML1206  [SML1206]
LED18  LEDSML1206  [SML1206]
LED26  LEDSML1206  [SML1206]
PTC  R-US_R1206W  [R1206W]
PTC1  R-US_R1206W  [R1206W]
Q12  IRLML2060TRPBFBSS123LT1G  [SOT23-3]
R29  RESISTOR0603-RES  [0603-RES]
R35  RESISTOR0603-RES  [0603-RES]
R105  RESISTOR0603-RES  [0603-RES]
R106  RESISTOR0603-RES  [0603-RES]
R107  RESISTOR0603-RES  [0603-RES]
R108  RESISTOR0603-RES  [0603-RES]
TP95  TPB1,27  [B1,27]
TP96  TPB1,27  [B1,27]
TP97  TPB1,27  [B1,27]
TP98  TPB1,27  [B1,27]
TP99  TPB1,27  [B1,27]
TP100  TPB1,27  [B1,27]
TP101  TPB1,27  [B1,27]
TP102  TPB1,27  [B1,27]
TP124  TPB1,27  [B1,27]
TP125  TPB1,27  [B1,27]
TP141  TPB1,27  [B1,27]
TP142  TPB1,27  [B1,27]
U3  LM1085_KTT_3  [KTT3]
U4  LM1085_KTT_3  [KTT3]
U5  LM1084_KTT_3  [TS3B]
U7  LM1085_KTT_3  [KTT3]
U18  LM1085_KTT_3  [KTT3]

### Nets
3.3V_UNSUPERVISED: JP84.1 LED18.A TP101.TP ; also sheet 7
5V_FNR: C117.1 JP19.1 LED26.A TP142.TP ; also sheet 28
5V_TO_SUPERVISOR: C68.1 JP87.1 K2.2 LED16.A TP125.TP ; also sheet 7
5V_UNSUPERVISED: C61.1 JP83.1 LED17.A TP100.TP ; also sheet 7
12V_UNSUPERVISED: JP82.1 LED15.A TP98.TP ; also sheet 7
CON_MONA_+: JP85.2 ; also sheet 2,13
CON_MONA_-: C57.2 ; supply symbol labelled GND ; also sheet 2,13
CON_MONB_+: JP20.2 ; also sheet 2,13,14
CON_MONB_-: C116.2 C117.2 R35.2 U18.3(ADJ/GND) U18.4(EPAD) ; also sheet 2,14,28
GND: C58.2 C59.2 C60.2 C61.2 C62.2 C67.2 C68.2 Q12.2(S) R105.2 R106.2 R107.2 R108.2 U3.3(ADJ/GND) U3.4(EPAD) U4.3(ADJ/GND) U4.4(EPAD) U5.1(ADJ/GND) U5.4 U7.3(ADJ/GND) U7.4(EPAD) ; also sheet 2,3,4,5,7,8,9,12,13,14,15,17,18,19,20,21,22,23,24,25,26,28
N$10: JP19.2 PTC1.2 TP141.TP
N$11: C116.1 JP20.1 U18.1(INPUT)
N$20: JP85.1 JP96.2 K2.C(2:P)
N$24: LED26.C R35.1
N$25: PTC1.1 U18.2(OUTPUT)
N$63: K2.1 Q12.3(D)
N$167: C60.1 JP82.2 TP102.TP U5.2(VOUT)
N$169: C62.1 JP84.2 TP95.TP U4.2(OUTPUT)
N$173: C59.1 JP86.1 TP96.TP U4.1(INPUT)
N$174: JP87.2 PTC.2 TP124.TP
N$176: C58.1 JP88.1 U3.1(INPUT)
N$177: C67.1 JP96.1 U7.1(INPUT)
N$242: LED15.C R106.1
N$249: LED16.C R105.1
N$251: LED17.C R108.1
N$253: LED18.C R107.1
N$261: JP83.2 JP86.2 TP97.TP U3.2(OUTPUT)
N$262: PTC.1 U7.2(OUTPUT)
POWER_GOOD_OUT: R29.2 ; also sheet 7
POWER_GOOD_OUTD: Q12.1(G) R29.1
VOLTAGEJMP_+_TO_INPUT_VREG: C57.1 JP88.2 K2.NO(2:S) TP99.TP U5.3(VIN)
Unconnected: K2.NC(2:O)

### Notes on the sheet
- Power Block
- Linear Regulators
- 11-15v in
- 12v
- 5v
- 5v
- 3.3v
- 5v

## Sheet 7 of 28: Supervisor
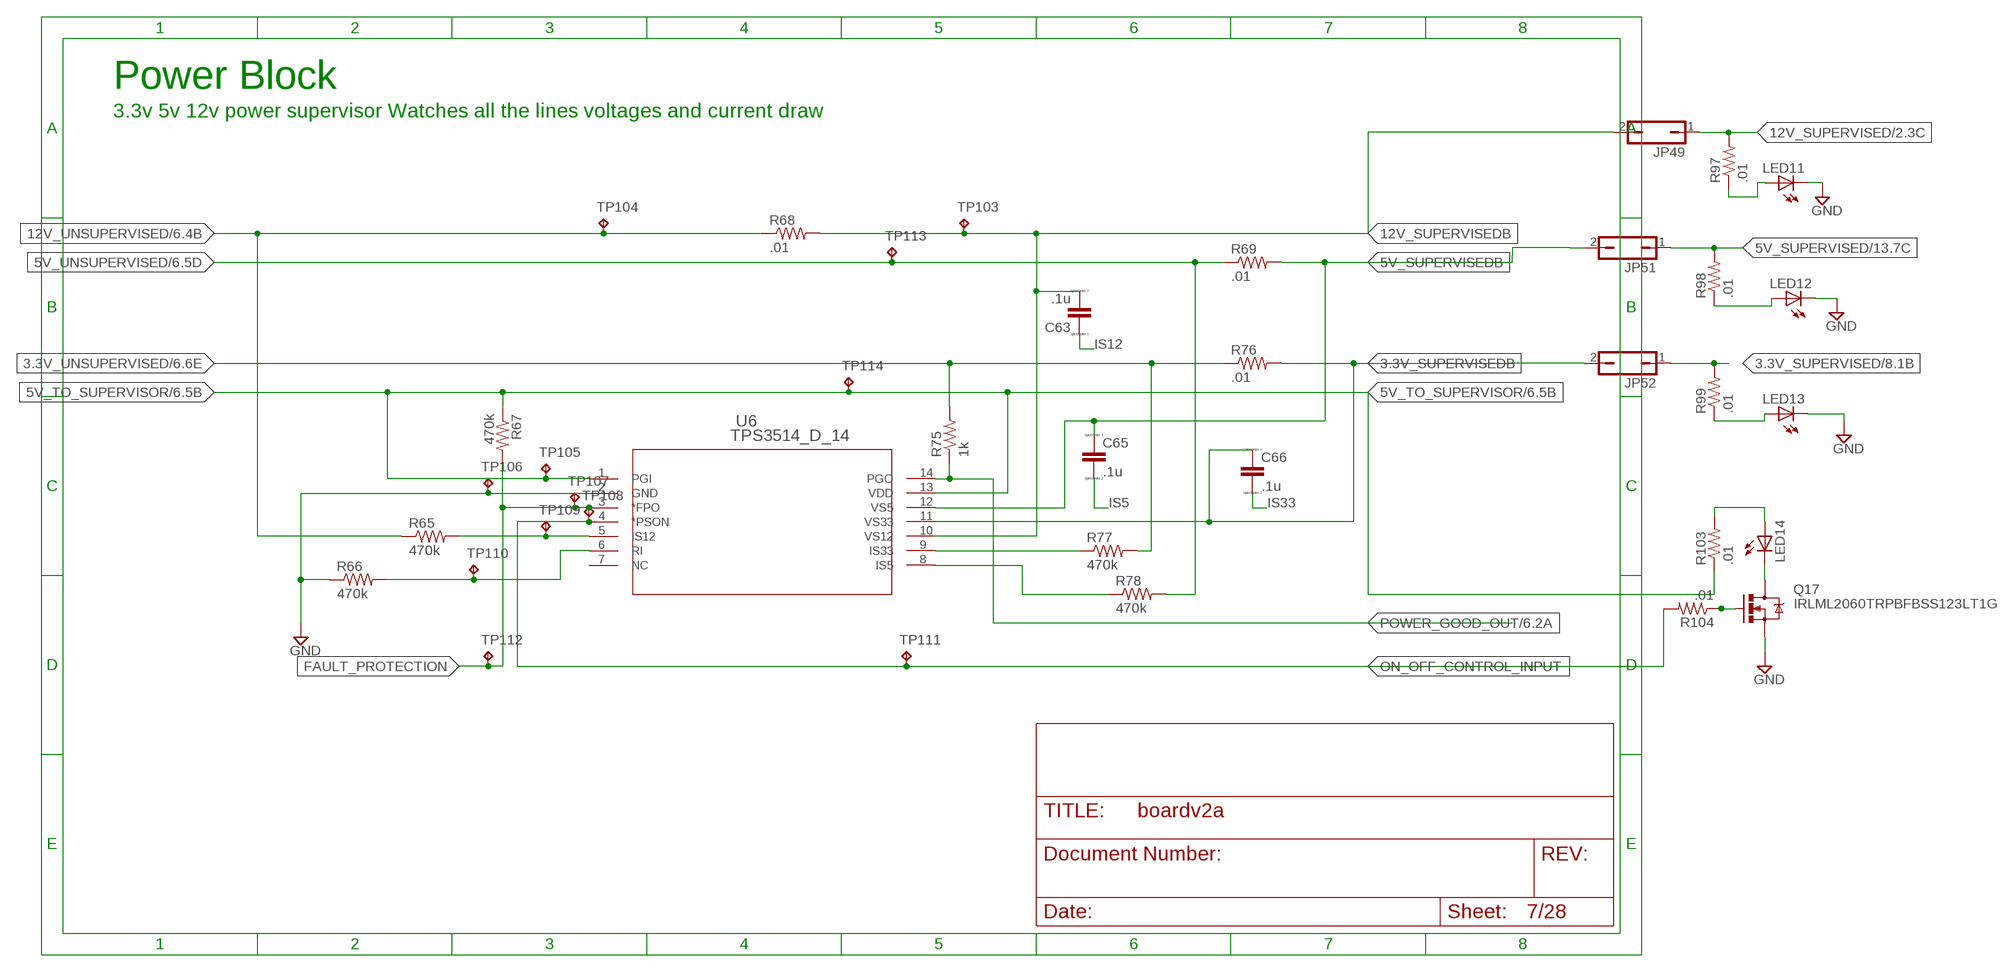
[diagram p7: schematic, sheet 7]

### Parts
C63  .1u  CC0603  [C0603]
C65  .1u  CC0603  [C0603]
C66  .1u  CC0603  [C0603]
JP49  JP1Q  [JP1]
JP51  JP1Q  [JP1]
JP52  JP1Q  [JP1]
LED11  LEDSML1206  [SML1206]
LED12  LEDSML1206  [SML1206]
LED13  LEDSML1206  [SML1206]
LED14  LEDSML1206  [SML1206]
Q17  IRLML2060TRPBFBSS123LT1G  [SOT23-3]
R65  470k  RESISTOR0603-RES  [0603-RES]
R66  470k  RESISTOR0603-RES  [0603-RES]
R67  470k  RESISTOR0603-RES  [0603-RES]
R68  .01  RESISTOR0603-RES  [0603-RES]
R69  .01  RESISTOR0603-RES  [0603-RES]
R75  1k  RESISTOR0603-RES  [0603-RES]
R76  .01  RESISTOR0603-RES  [0603-RES]
R77  470k  RESISTOR0603-RES  [0603-RES]
R78  470k  RESISTOR0603-RES  [0603-RES]
R97  .01  RESISTOR0603-RES  [0603-RES]
R98  .01  RESISTOR0603-RES  [0603-RES]
R99  .01  RESISTOR0603-RES  [0603-RES]
R103  .01  RESISTOR0603-RES  [0603-RES]
R104  .01  RESISTOR0603-RES  [0603-RES]
TP103  TPB1,27  [B1,27]
TP104  TPTP06R  [TP06R]
TP105  TPB1,27  [B1,27]
TP106  TPB1,27  [B1,27]
TP107  TPB1,27  [B1,27]
TP108  TPB1,27  [B1,27]
TP109  TPB1,27  [B1,27]
TP110  TPB1,27  [B1,27]
TP111  TPB1,27  [B1,27]
TP112  TPB1,27  [B1,27]
TP113  TPB1,27  [B1,27]
TP114  TPB1,27  [B1,27]
U6  TPS3514_D_14  [D14]

### Nets
3.3V_SUPERVISED: JP52.1 R99.2 ; also sheet 8,9,12,19,20,21,22,23,24,25,26
3.3V_SUPERVISEDB: C66.1 JP52.2 R76.2 U6.11(VS33)
3.3V_UNSUPERVISED: R75.2 R76.1 R77.2 ; also sheet 6
5V_SUPERVISED: JP51.1 R98.2 ; also sheet 2,5,13,14,15,19,20,21,22,23,24,25,26
5V_SUPERVISEDB: C65.1 JP51.2 R69.2 U6.12(VS5)
5V_TO_SUPERVISOR: R67.1 R103.1 TP105.TP TP114.TP U6.1(PGI) U6.13(VDD) ; also sheet 6
5V_UNSUPERVISED: R69.1 R78.2 TP113.TP ; also sheet 6
12V_SUPERVISED: JP49.1 R97.2 ; also sheet 2
12V_SUPERVISEDB: C63.2 JP49.2 R68.2 TP103.TP U6.10(VS12)
12V_UNSUPERVISED: R65.1 R68.1 TP104.TP ; also sheet 6
FAULT_PROTECTION: R67.2 TP107.TP TP112.TP U6.3(*FPO)
GND: LED11.C LED12.C LED13.C Q17.2(S) R66.1 TP106.TP U6.2(GND) ; also sheet 2,3,4,5,6,8,9,12,13,14,15,17,18,19,20,21,22,23,24,25,26,28
IS5: C65.2 R78.1 U6.8(IS5)
IS12: C63.1 R65.2 TP109.TP U6.5(IS12)
IS33: C66.2 R77.1 U6.9(IS33)
N$12: LED14.C Q17.3(D)
N$178: R66.2 TP110.TP U6.6(RI)
N$241: LED13.A R99.1
N$245: LED12.A R98.1
N$246: LED11.A R97.1
N$247: LED14.A R103.2
N$248: Q17.1(G) R104.1
ON_OFF_CONTROL_INPUT: R104.2 TP108.TP TP111.TP U6.4(*PSON)
POWER_GOOD_OUT: R75.1 U6.14(PGO) ; also sheet 6
Unconnected: U6.7(NC)

### Notes on the sheet
- Power Block
- 3.3v 5v 12v power supervisor Watches all the lines voltages and current draw

## Sheet 8 of 28: MCU Power Protection
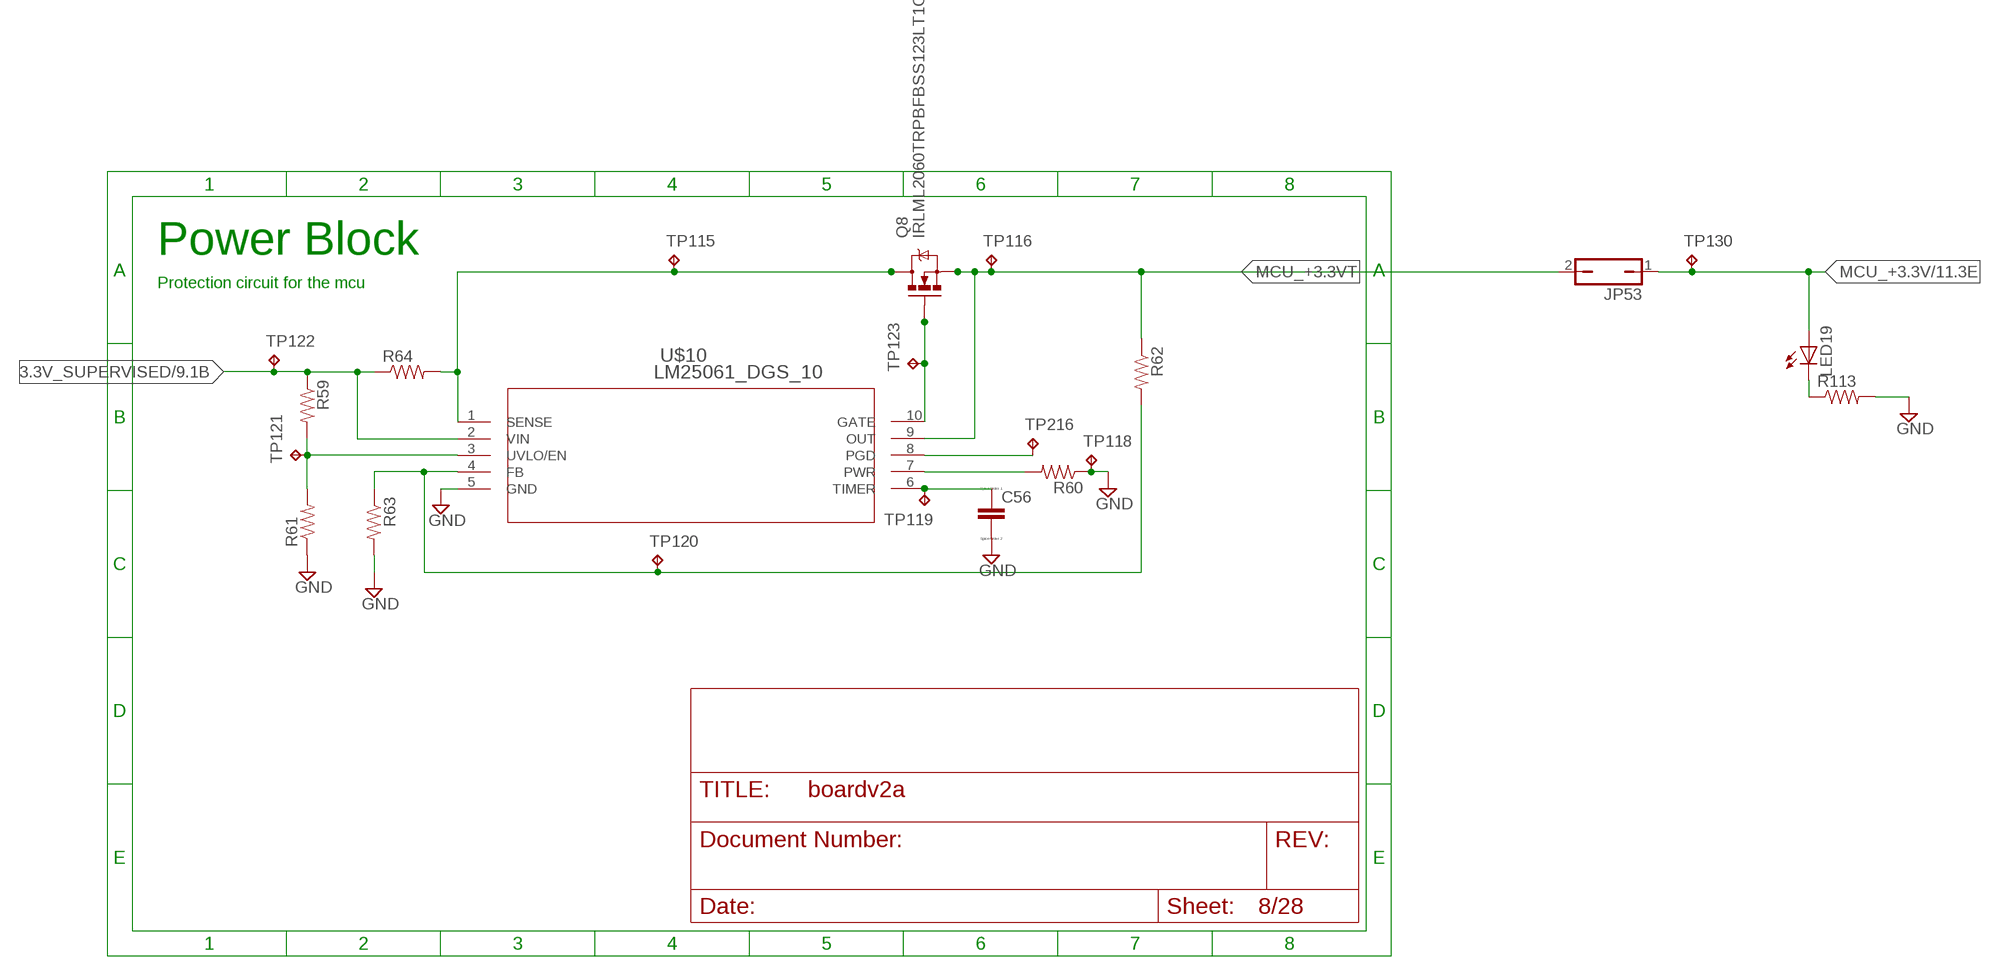
[diagram p8: schematic, sheet 8]

### Parts
C56  CC0603  [C0603]
JP53  JP1Q  [JP1]
LED19  LEDSML1206  [SML1206]
Q8  IRLML2060TRPBFBSS123LT1G  [SOT23-3]
R59  RESISTOR0603-RES  [0603-RES]
R60  RESISTOR0603-RES  [0603-RES]
R61  RESISTOR0603-RES  [0603-RES]
R62  RESISTOR0603-RES  [0603-RES]
R63  RESISTOR0603-RES  [0603-RES]
R64  RESISTOR0603-RES  [0603-RES]
R113  RESISTOR0603-RES  [0603-RES]
TP115  TPB1,27  [B1,27]
TP116  TPB1,27  [B1,27]
TP118  TPB1,27  [B1,27]
TP119  TPB1,27  [B1,27]
TP120  TPB1,27  [B1,27]
TP121  TPB1,27  [B1,27]
TP122  TPB1,27  [B1,27]
TP123  TPB1,27  [B1,27]
TP130  TPB1,27  [B1,27]
TP216  TPB1,27  [B1,27]
U$10  LM25061_DGS_10  [MUB10A]

### Nets
3.3V_SUPERVISED: R59.1 R64.1 TP122.TP U$10.2(VIN) ; also sheet 7,9,12,19,20,21,22,23,24,25,26
GND: C56.2 R60.1 R61.1 R63.2 R113.2 TP118.TP U$10.5(GND) ; also sheet 2,3,4,5,6,7,9,12,13,14,15,17,18,19,20,21,22,23,24,25,26,28
MCU_+3.3V: JP53.1 LED19.A TP130.TP ; also sheet 5,11,16,28
MCU_+3.3VT: JP53.2 Q8.2(S) R62.1 TP116.TP U$10.9(OUT)
N$179: C56.1 TP119.TP U$10.6(TIMER)
N$180: R60.2 U$10.7(PWR)
N$181: R59.2 R61.2 TP121.TP U$10.3(UVLO/EN)
N$182: Q8.3(D) R64.2 TP115.TP U$10.1(SENSE)
N$183: Q8.1(G) TP123.TP U$10.10(GATE)
N$184: R62.2 R63.1 TP120.TP U$10.4(FB)
N$185: TP216.TP U$10.8(PGD)
N$258: LED19.C R113.1

### Notes on the sheet
- Power Block
- Protection circuit for the mcu

## Sheet 9 of 28: FPGA Power Protection
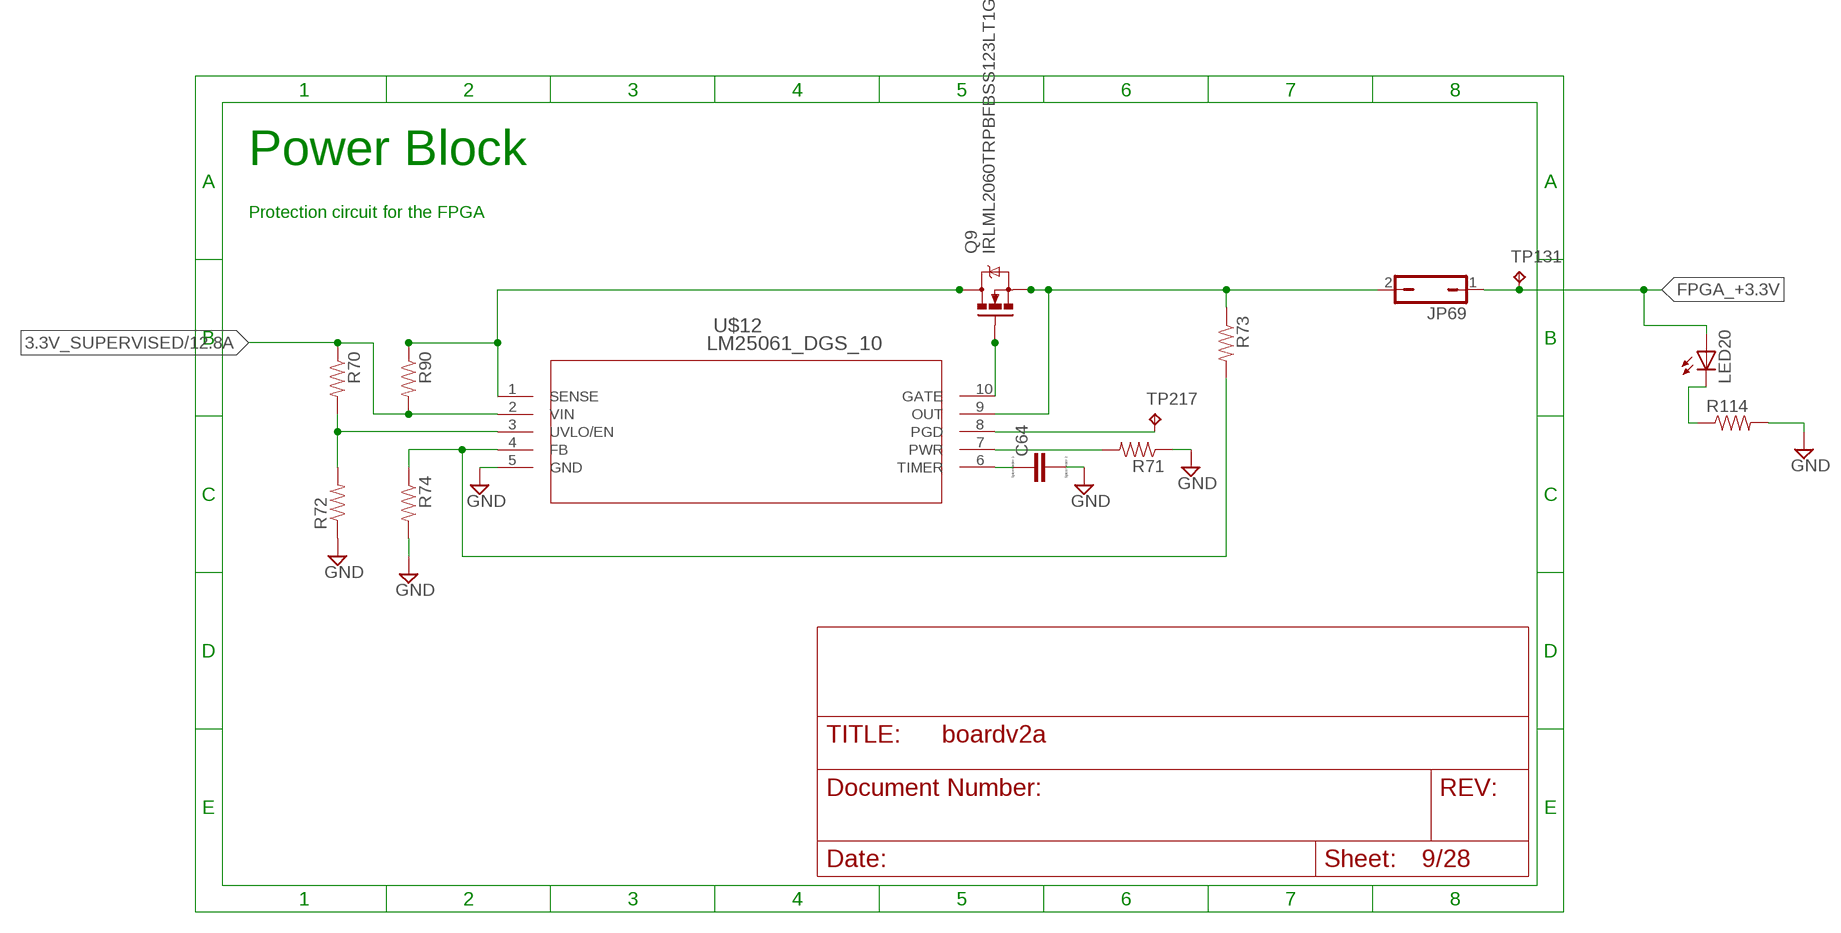
[diagram p9: schematic, sheet 9]

### Parts
C64  CC0603  [C0603]
JP69  JP1Q  [JP1]
LED20  LEDSML1206  [SML1206]
Q9  IRLML2060TRPBFBSS123LT1G  [SOT23-3]
R70  RESISTOR0603-RES  [0603-RES]
R71  RESISTOR0603-RES  [0603-RES]
R72  RESISTOR0603-RES  [0603-RES]
R73  RESISTOR0603-RES  [0603-RES]
R74  RESISTOR0603-RES  [0603-RES]
R90  RESISTOR0603-RES  [0603-RES]
R114  RESISTOR0603-RES  [0603-RES]
TP131  TPB1,27  [B1,27]
TP217  TPB1,27  [B1,27]
U$12  LM25061_DGS_10  [MUB10A]

### Nets
3.3V_SUPERVISED: R70.1 R90.2 U$12.2(VIN) ; also sheet 7,8,12,19,20,21,22,23,24,25,26
FPGA_+3.3V: JP69.1 LED20.A TP131.TP
GND: C64.2 R71.1 R72.1 R74.2 R114.2 U$12.5(GND) ; also sheet 2,3,4,5,6,7,8,12,13,14,15,17,18,19,20,21,22,23,24,25,26,28
N$186: C64.1 U$12.6(TIMER)
N$187: R71.2 U$12.7(PWR)
N$188: R70.2 R72.2 U$12.3(UVLO/EN)
N$189: Q9.3(D) R90.1 U$12.1(SENSE)
N$190: Q9.1(G) U$12.10(GATE)
N$191: R73.2 R74.1 U$12.4(FB)
N$192: JP69.2 Q9.2(S) R73.1 U$12.9(OUT)
N$193: TP217.TP U$12.8(PGD)
N$195: LED20.C R114.1

### Notes on the sheet
- Power Block
- Protection circuit for the FPGA

## Sheet 10 of 28: Steering Controller
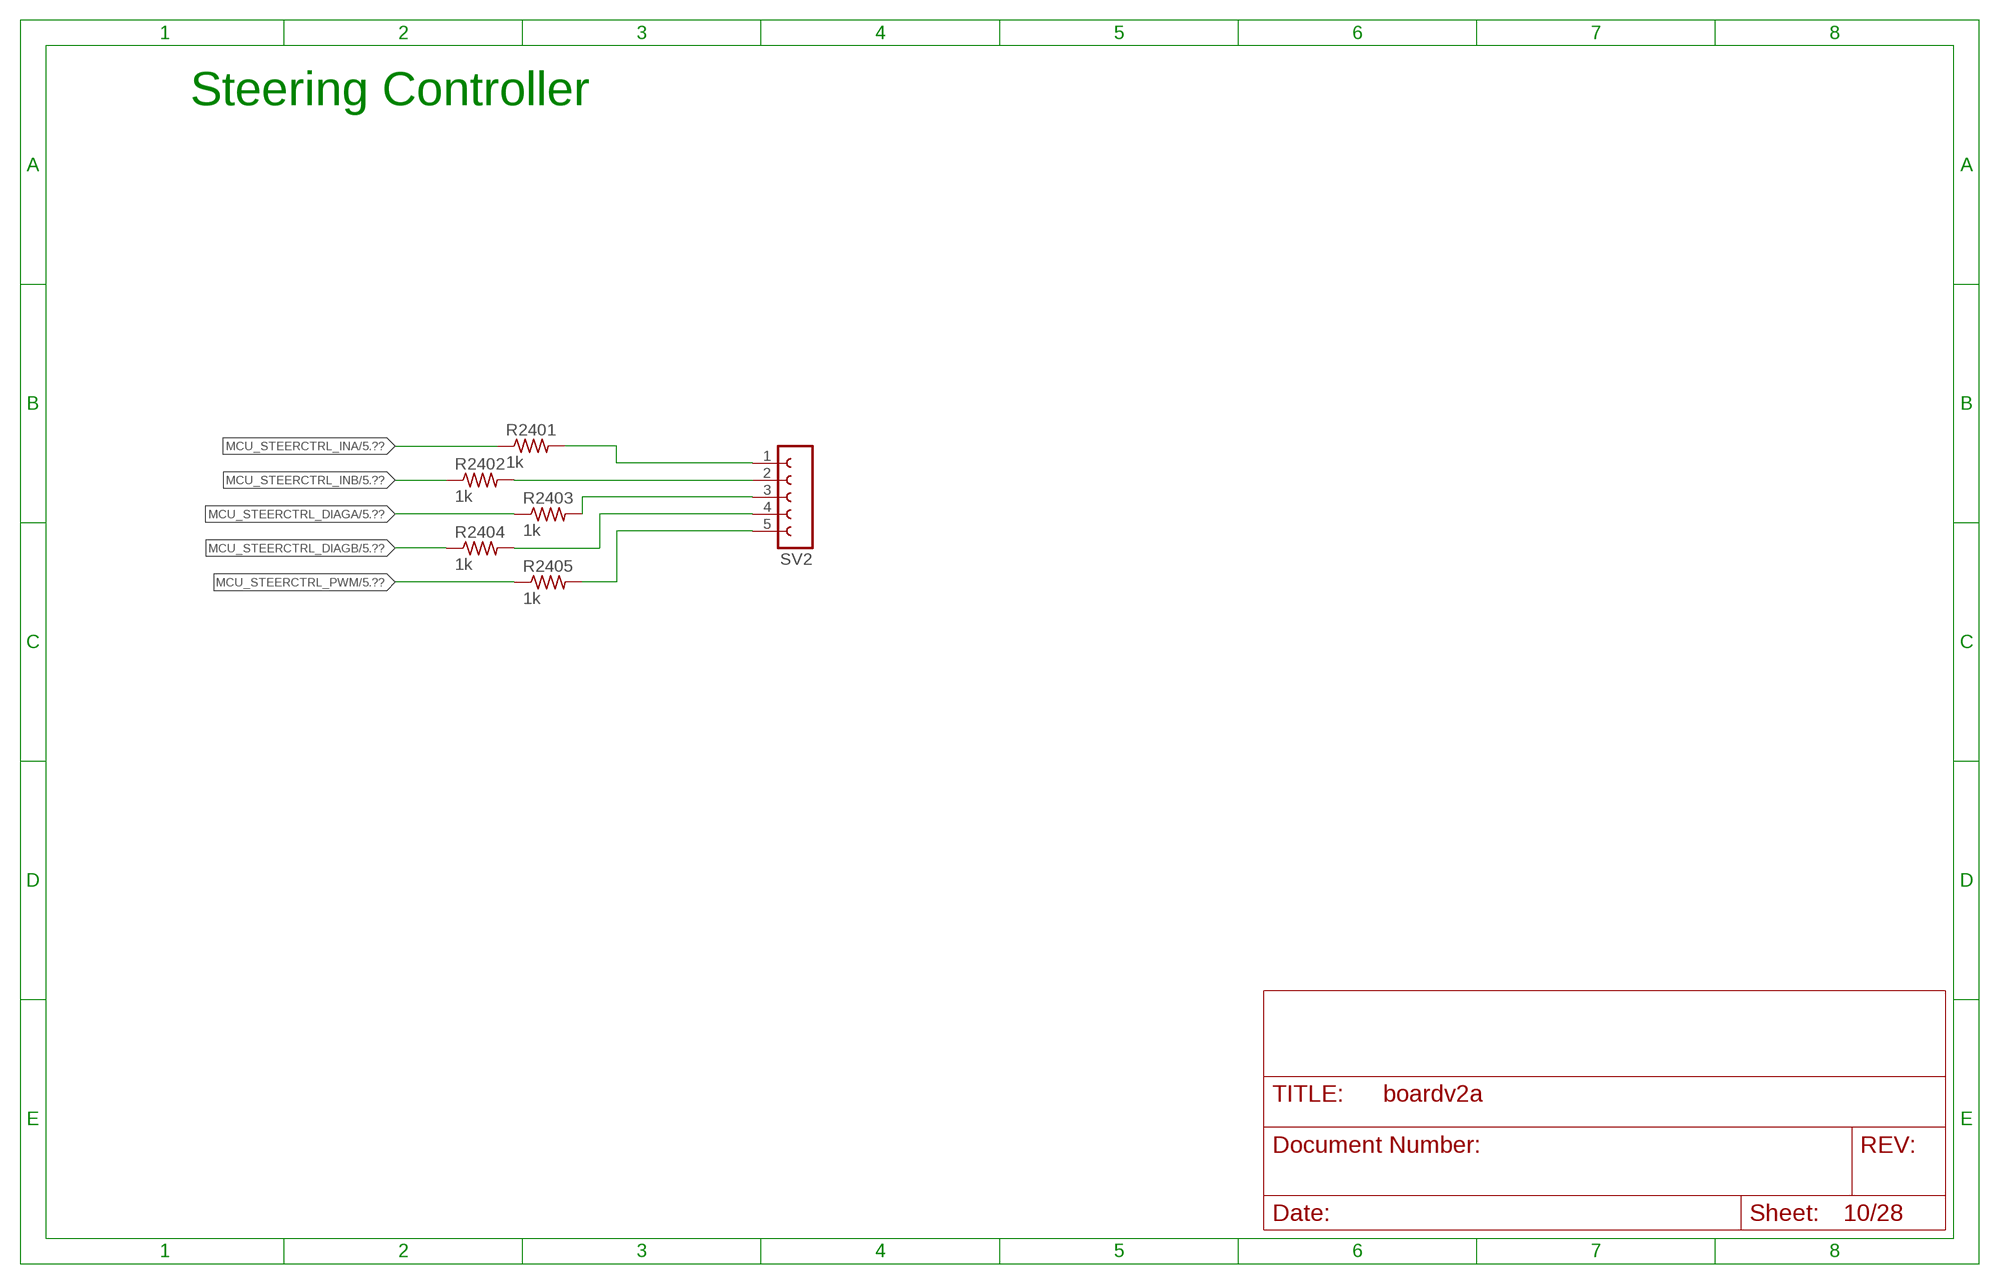
[diagram p10: schematic, sheet 10]

### Parts
R2401  1k  R-US_R0603  [R0603]
R2402  1k  R-US_R0603  [R0603]
R2403  1k  R-US_R0603  [R0603]
R2404  1k  R-US_R0603  [R0603]
R2405  1k  R-US_R0603  [R0603]
SV2  FE05-1  [FE05-1]

### Nets
MCU_STEERCTRL_DIAGA: R2403.1 ; also sheet 5
MCU_STEERCTRL_DIAGB: R2404.1 ; also sheet 5
MCU_STEERCTRL_INA: R2401.1 ; also sheet 5
MCU_STEERCTRL_INB: R2402.1 ; also sheet 5
MCU_STEERCTRL_PWM: R2405.1 ; also sheet 5
N$26: R2401.2 SV2.1
N$27: R2404.2 SV2.4
N$29: R2402.2 SV2.2
N$72: R2403.2 SV2.3
N$77: R2405.2 SV2.5

### Notes on the sheet
- Steering Controller

## Sheet 11 of 28: Temperature Measurement Block
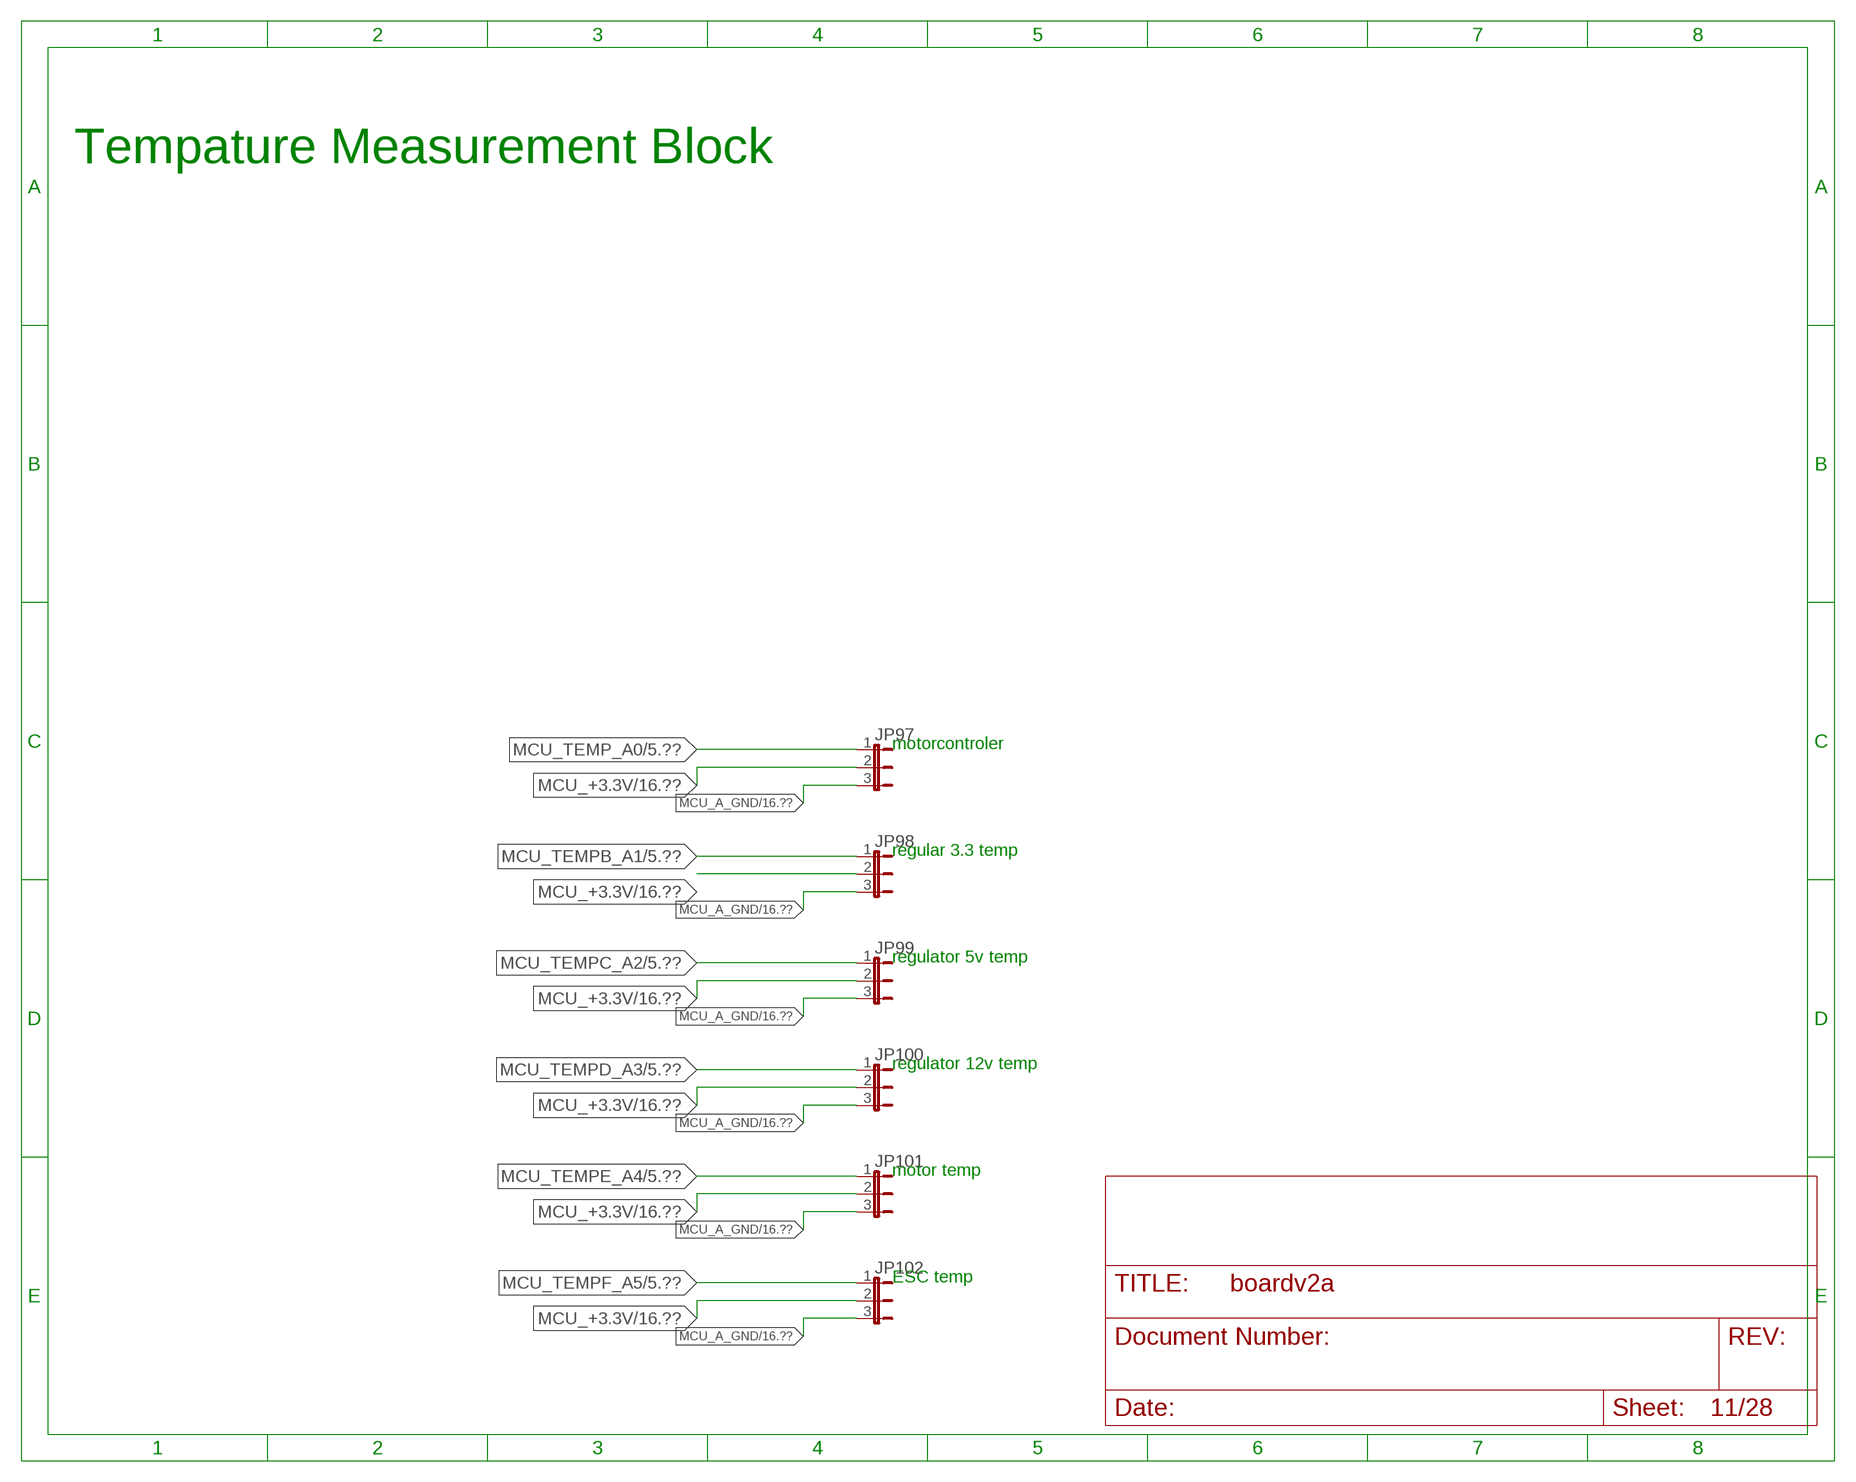
[diagram p11: schematic, sheet 11]

### Parts
JP97  JP2E  [JP2]
JP98  JP2E  [JP2]
JP99  JP2E  [JP2]
JP100  JP2E  [JP2]
JP101  JP2E  [JP2]
JP102  JP2E  [JP2]

### Nets
MCU_+3.3V: JP97.2 JP98.2 JP99.2 JP100.2 JP101.2 JP102.2 ; also sheet 5,8,16,28
MCU_A_GND: JP97.3 JP98.3 JP99.3 JP100.3 JP101.3 JP102.3 ; also sheet 5,16
MCU_TEMP_A0: JP97.1 ; also sheet 5
MCU_TEMPB_A1: JP98.1 ; also sheet 5
MCU_TEMPC_A2: JP99.1 ; also sheet 5
MCU_TEMPD_A3: JP100.1 ; also sheet 5
MCU_TEMPE_A4: JP101.1 ; also sheet 5
MCU_TEMPF_A5: JP102.1 ; also sheet 5

### Notes on the sheet
- Tempature Measurement Block
- motorcontroler
- regular 3.3 temp
- regulator 5v temp
- regulator 12v temp
- motor temp
- ESC temp

## Sheet 12 of 28: Ethernet Hardware
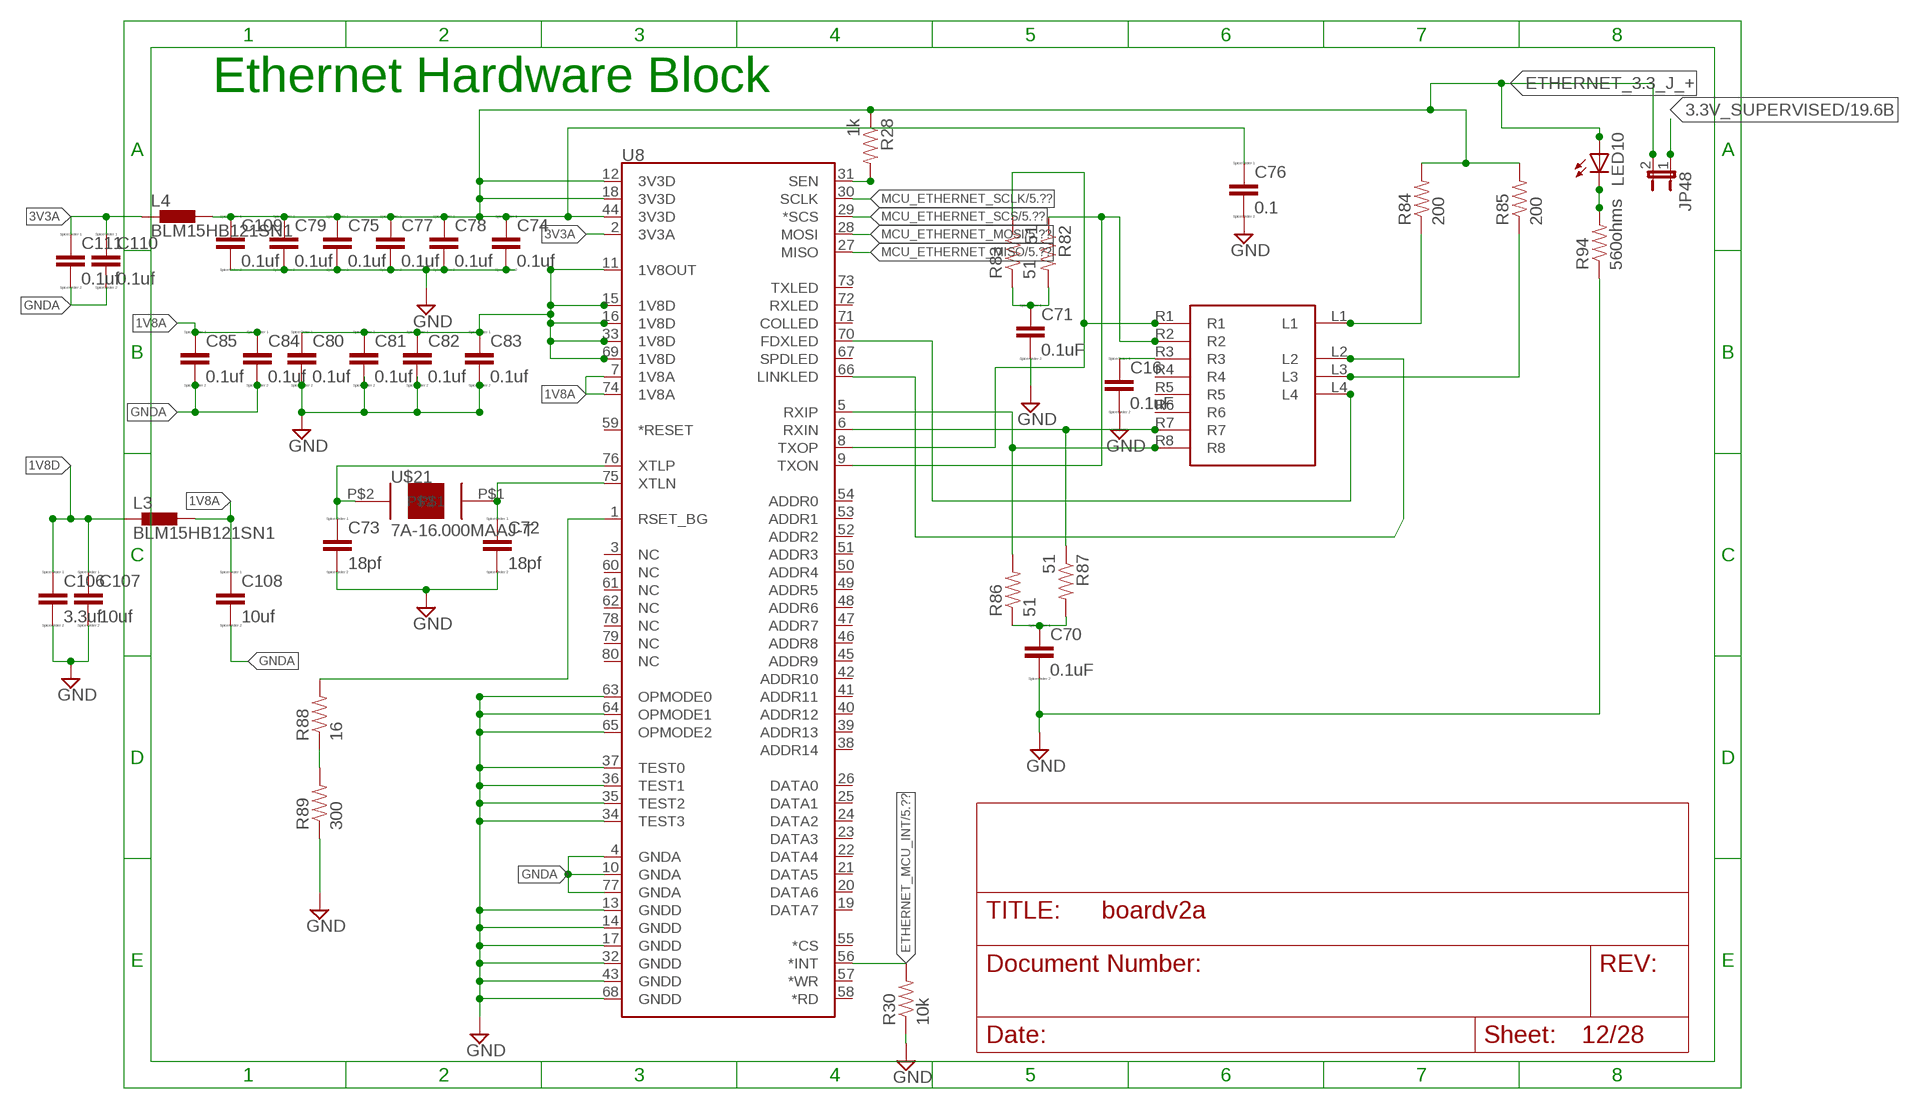
[diagram p12: schematic, sheet 12]

### Parts
C16  0.1uF  CC0603  [C0603]
C70  0.1uF  CC0603  [C0603]
C71  0.1uF  CC0603  [C0603]
C72  18pf  CC0603  [C0603]
C73  18pf  CC0603  [C0603]
C74  0.1uf  CC0603  [C0603]
C75  0.1uf  CC0603  [C0603]
C76  0.1  CC0603  [C0603]
C77  0.1uf  CC0603  [C0603]
C78  0.1uf  CC0603  [C0603]
C79  0.1uf  CC0603  [C0603]
C80  0.1uf  CC0603  [C0603]
C81  0.1uf  CC0603  [C0603]
C82  0.1uf  CC0603  [C0603]
C83  0.1uf  CC0603  [C0603]
C84  0.1uf  CC0603  [C0603]
C85  0.1uf  CC0603  [C0603]
C106  3.3uf  CC0603  [C0603]
C107  10uf  CC0603  [C0603]
C108  10uf  CC0603  [C0603]
C109  0.1uf  CC0603  [C0603]
C110  0.1uf  CC0603  [C0603]
C111  0.1uf  CC0603  [C0603]
JP48  JP1E  [JP1]
L3  BLM15HB121SN1  [0402]
L4  BLM15HB121SN1  [0402]
LED10  LEDSML1206  [SML1206]
R28  1k  RESISTOR0603-RES  [0603-RES]
R30  10k  RESISTOR0603-RES  [0603-RES]
R82  51  RESISTOR0603-RES  [0603-RES]
R83  51  RESISTOR0603-RES  [0603-RES]
R84  200  RESISTOR0603-RES  [0603-RES]
R85  200  RESISTOR0603-RES  [0603-RES]
R86  51  RESISTOR0603-RES  [0603-RES]
R87  51  RESISTOR0603-RES  [0603-RES]
R88  16  RESISTOR0603-RES  [0603-RES]
R89  300  RESISTOR0603-RES  [0603-RES]
R94  560ohms  RESISTOR0603-RES  [0603-RES]
U8  W5100  [LQFP-80]
U$21  7A-16.000MAAJ-T  [2-SMD]
U$22  ETHERNET_CONNECTOR  [RB1-125BAG1A]

### Nets
0.1: R83.2 U8.8(TXOP) U$22.R1
1V8A: C84.1 C85.1 C108.1 L3.2 U8.7(1V8A) U8.74(1V8A)
1V8D: C106.1 C107.1 L3.1
3.3V_SUPERVISED: JP48.1 ; also sheet 7,8,9,19,20,21,22,23,24,25,26
3V3A: C110.1 C111.1 L4.1 U8.2(3V3A)
ETHERNET_3.3_J_+: C16.1 C74.1 C75.1 C76.1 C77.1 C78.1 C79.1 C109.1 JP48.2 L4.2 LED10.A R28.1 R84.2 R85.2 U8.12(3V3D) U8.18(3V3D) U8.44(3V3D) U$22.R3
ETHERNET_MCU_INT: R30.2 U8.56(*INT) ; also sheet 5
GND: C16.2 C70.2 C71.2 C72.2 C73.2 C74.2 C75.2 C76.2 C77.2 C78.2 C79.2 C80.2 C81.2 C82.2 C83.2 C106.2 C107.2 C109.2 R30.1 R89.1 R94.1 ; also sheet 2,3,4,5,6,7,8,9,13,14,15,17,18,19,20,21,22,23,24,25,26,28
GNDA: C84.2 C85.2 C108.2 C110.2 C111.2 U8.4(GNDA) U8.10(GNDA) U8.77(GNDA)
MCU_ETHERNET_MISO: U8.27(MISO) ; also sheet 5
MCU_ETHERNET_MOSI: U8.28(MOSI) ; also sheet 5
MCU_ETHERNET_SCLK: U8.30(SCLK) ; also sheet 5
MCU_ETHERNET_SCS: U8.29(*SCS) ; also sheet 5
MCU_ETHERNET_SEN: R28.2 U8.31(SEN)
N$196: C71.1 R82.2 R83.1
N$197: C70.1 R86.1 R87.2
N$199: R82.1 U8.9(TXON) U$22.R2
N$200: R84.1 U$22.L1
N$201: R85.1 U$22.L3
N$202: R87.1 U8.6(RXIN) U$22.R7
N$203: R86.2 U8.5(RXIP) U$22.R8
N$204: U8.66(LINKLED) U$22.L2
N$205: U8.70(FDXLED) U$22.L4
N$206: LED10.C R94.2
N$207: C80.1 C81.1 C82.1 C83.1 U8.11(1V8OUT) U8.15(1V8D) U8.16(1V8D) U8.33(1V8D) U8.69(1V8D)
N$208: R88.1 R89.2
N$209: R88.2 U8.1(RSET_BG)
P$1_CLK_TO_XTLN_WIZNET: C72.1 U8.75(XTLN) U$21.P$1
P$2_CLK_TO_XTLP_WIZNET: C73.1 U8.76(XTLP) U$21.P$2
WIZNET_TO_GND: U8.13(GNDD) U8.14(GNDD) U8.17(GNDD) U8.32(GNDD) U8.34(TEST3) U8.35(TEST2) U8.36(TEST1) U8.37(TEST0) U8.43(GNDD) U8.63(OPMODE0) U8.64(OPMODE1) U8.65(OPMODE2) U8.68(GNDD) ; supply symbol labelled GND
Unconnected: U8.3(NC) U8.19(DATA7) U8.20(DATA6) U8.21(DATA5) U8.22(DATA4) U8.23(DATA3) U8.24(DATA2) U8.25(DATA1) U8.26(DATA0) U8.38(ADDR14) U8.39(ADDR13) U8.40(ADDR12) U8.41(ADDR11) U8.42(ADDR10) U8.45(ADDR9) U8.46(ADDR8) U8.47(ADDR7) U8.48(ADDR6) U8.49(ADDR5) U8.50(ADDR4) U8.51(ADDR3) U8.52(ADDR2) U8.53(ADDR1) U8.54(ADDR0) U8.55(*CS) U8.57(*WR) U8.58(*RD) U8.59(*RESET) U8.60(NC) U8.61(NC) U8.62(NC) U8.67(SPDLED) U8.71(COLLED) U8.72(RXLED) U8.73(TXLED) U8.78(NC) U8.79(NC) U8.80(NC) U$22.R4 U$22.R5 U$22.R6

### Notes on the sheet
- Ethernet Hardware Block

## Sheet 13 of 28: Battery A
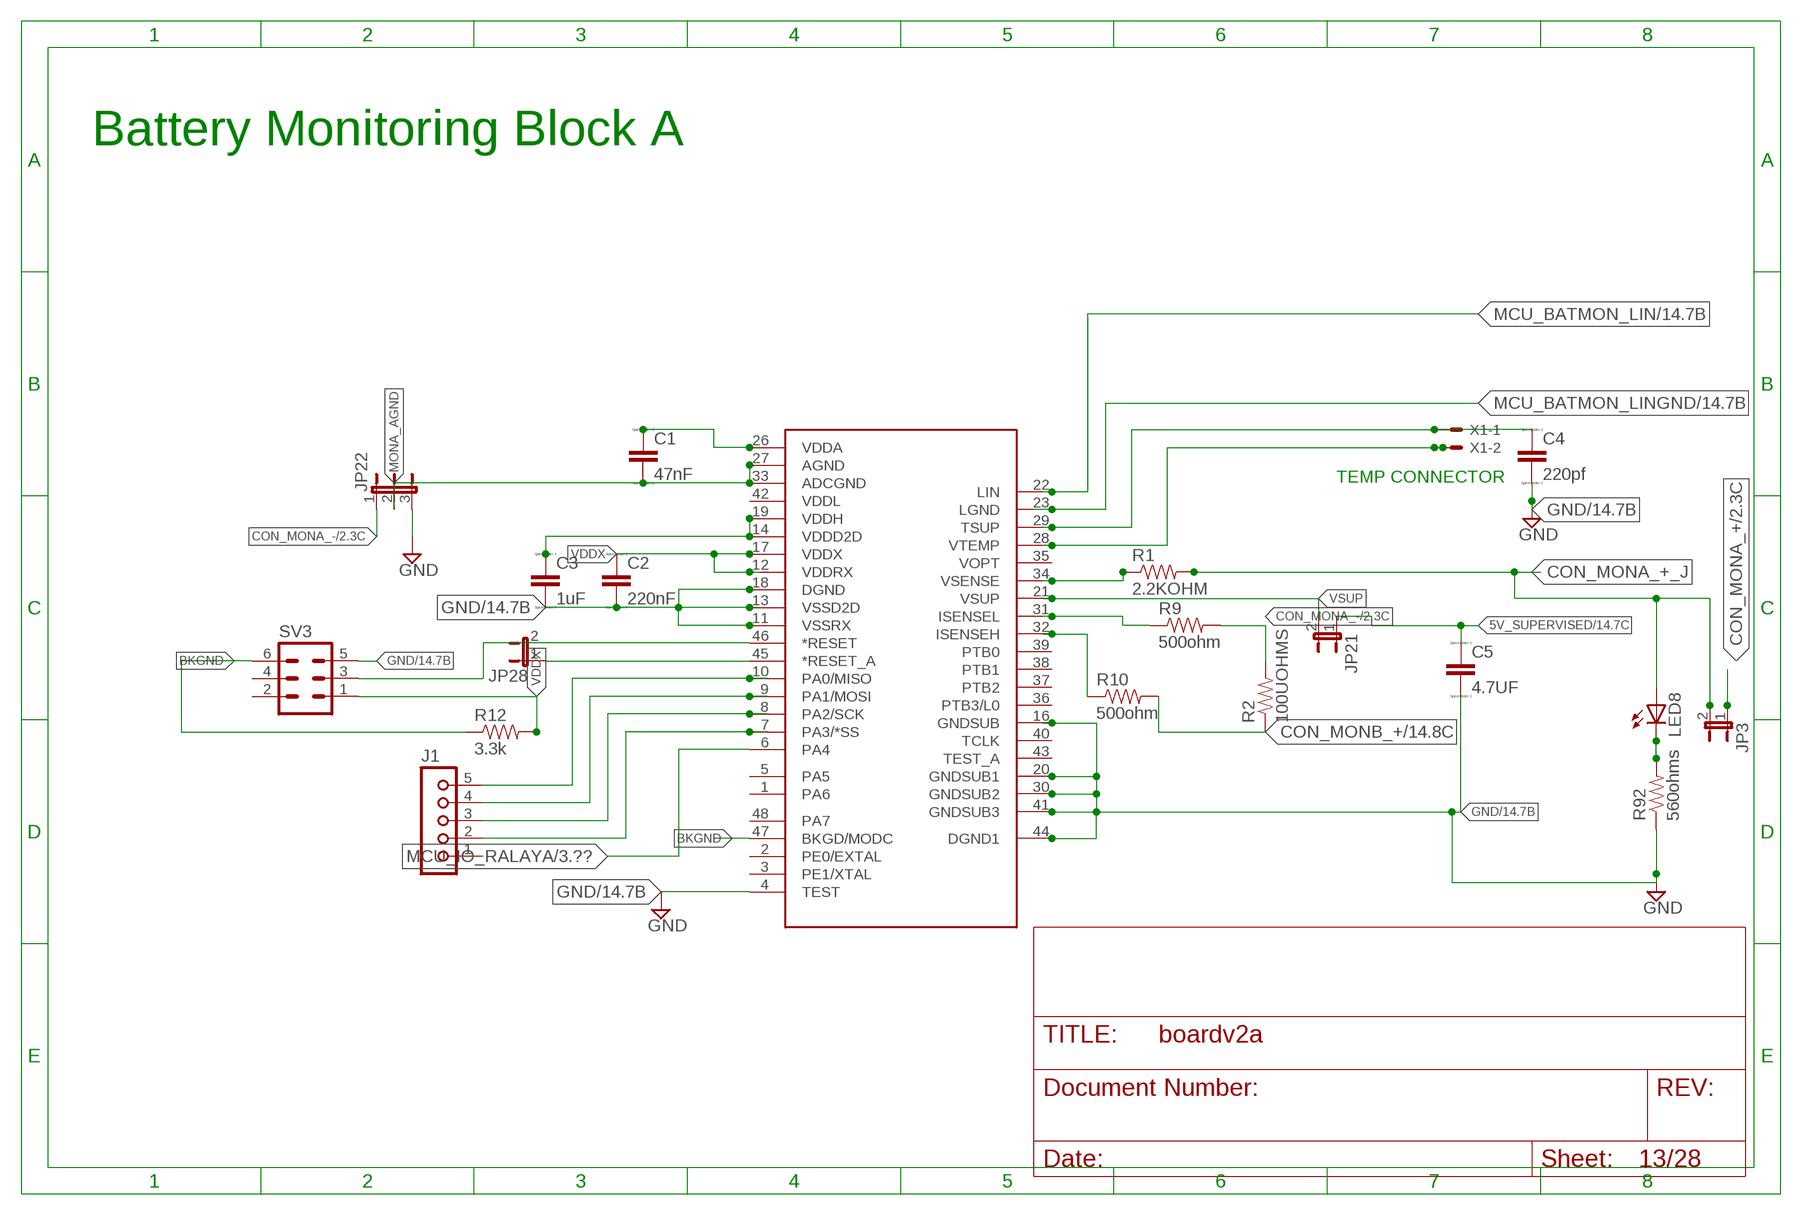
[diagram p13: schematic, sheet 13]

### Parts
C1  47nF  CC0603  [C0603]
C2  220nF  CC0603  [C0603]
C3  1uF  CC0603  [C0603]
C4  220pf  CC0603  [C0603]
C5  4.7UF  CC0603  [C0603]
J1  JU05  [JU05]
JP3  JP1E  [JP1]
JP21  JP1E  [JP1]
JP22  JP2E  [JP2]
JP28  JP1E  [JP1]
LED8  LEDSML1206  [SML1206]
R1  2.2KOHM  RESISTOR0603-RES  [0603-RES]
R2  100UOHMS  RESISTOR0603-RES  [0603-RES]
R9  500ohm  RESISTOR0603-RES  [0603-RES]
R10  500ohm  RESISTOR0603-RES  [0603-RES]
R12  3.3k  RESISTOR0603-RES  [0603-RES]
R92  560ohms  RESISTOR0603-RES  [0603-RES]
SV3  MA03-2  [MA03-2]
U$1  MM912_637D1  [QFN48]
X1  KK-156-2  [KK-156-2]

### Nets
5V_SUPERVISED: C5.1 JP21.1 ; also sheet 2,5,7,14,15,19,20,21,22,23,24,25,26
BKGND: R12.1 SV3.6 U$1.47(BKGD/MODC)
CON_MONA_+: JP3.1 ; also sheet 2,6
CON_MONA_+_J: JP3.2 LED8.A R1.2
CON_MONA_-: JP22.1 R2.2 R9.2 ; also sheet 2,6
CON_MONB_+: R2.1 R10.2 ; also sheet 2,6,14
GND: C2.2 C3.2 C4.2 C5.2 JP22.3 R92.1 SV3.5 U$1.4(TEST) U$1.11(VSSRX) U$1.13(VSSD2D) U$1.16(GNDSUB) U$1.18(DGND) U$1.20(GNDSUB1) U$1.30(GNDSUB2) U$1.41(GNDSUB3) U$1.44(DGND1) ; also sheet 2,3,4,5,6,7,8,9,12,14,15,17,18,19,20,21,22,23,24,25,26,28
MCU_BATMON_LIN: U$1.22(LIN) ; also sheet 5,14,15
MCU_BATMON_LINGND: U$1.23(LGND) ; also sheet 5,14,15
MCU_IO_RALAYA: U$1.6(PA4) ; also sheet 3
MONA_AGND: C1.2 JP22.2 U$1.27(AGND) U$1.33(ADCGND)
N$1: R1.1 U$1.34(VSENSE)
N$4: J1.5 U$1.10(PA0/MISO)
N$5: J1.4 U$1.9(PA1/MOSI)
N$6: J1.3 U$1.8(PA2/SCK)
N$7: J1.2 U$1.7(PA3/*SS)
N$8: C4.1 U$1.29(TSUP) X1.1
N$13: U$1.28(VTEMP) X1.2
N$14: JP28.2 SV3.3 U$1.46(*RESET)
N$16: C3.1 U$1.14(VDDD2D) U$1.19(VDDH)
N$21: JP28.1 U$1.45(*RESET_A)
N$45: R10.1 U$1.32(ISENSEH)
N$46: R9.1 U$1.31(ISENSEL)
N$47: C1.1 U$1.26(VDDA)
N$233: LED8.C R92.2
VDDX: C2.1 R12.2 SV3.1 U$1.12(VDDRX) U$1.17(VDDX)
VSUP: JP21.2 U$1.21(VSUP)
Unconnected: J1.1 SV3.2 SV3.4 U$1.1(PA6) U$1.2(PE0/EXTAL) U$1.3(PE1/XTAL) U$1.5(PA5) U$1.35(VOPT) U$1.36(PTB3/L0) U$1.37(PTB2) U$1.38(PTB1) U$1.39(PTB0) U$1.40(TCLK) U$1.42(VDDL) U$1.43(TEST_A) U$1.48(PA7)

### Notes on the sheet
- Battery Monitoring Block A
- TEMP CONNECTOR

## Sheet 14 of 28: Battery B
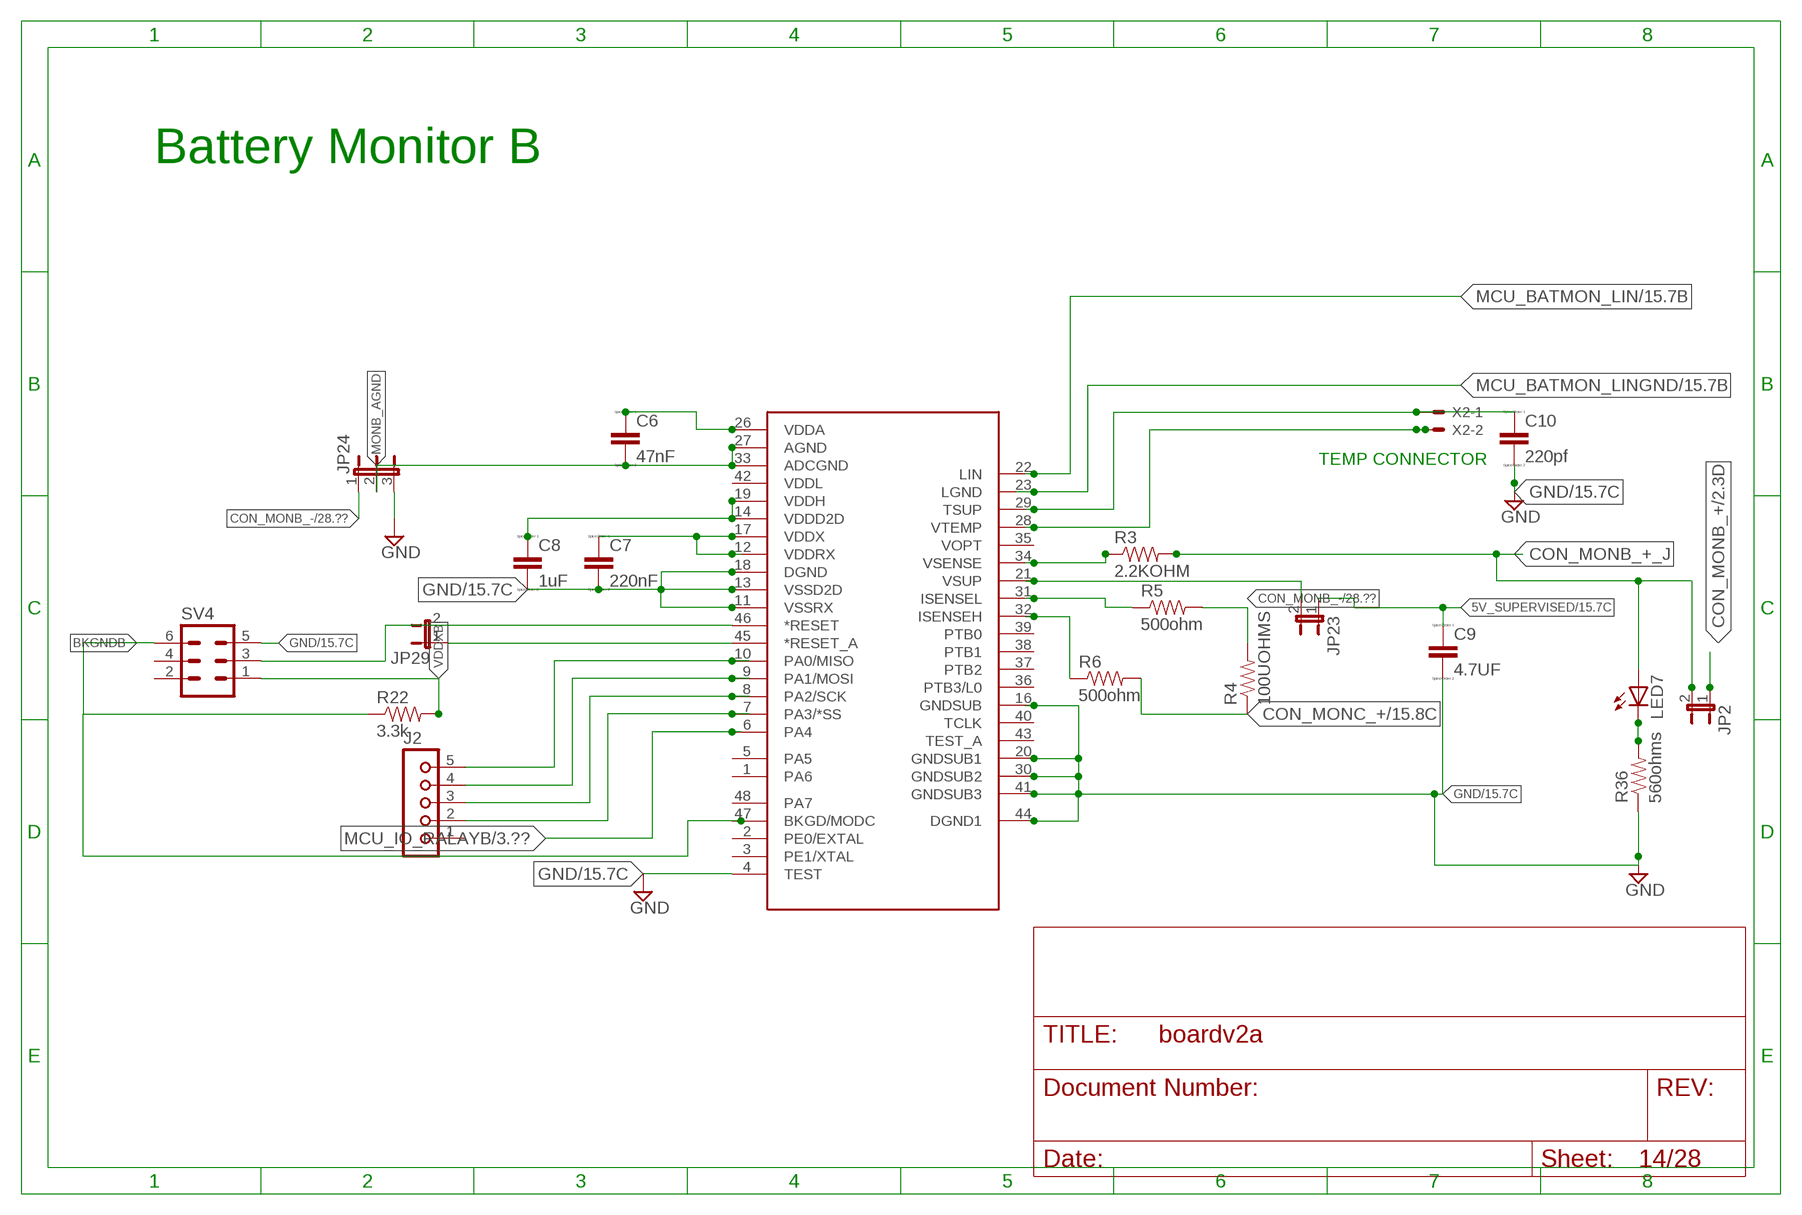
[diagram p14: schematic, sheet 14]

### Parts
C6  47nF  CC0603  [C0603]
C7  220nF  CC0603  [C0603]
C8  1uF  CC0603  [C0603]
C9  4.7UF  CC0603  [C0603]
C10  220pf  CC0603  [C0603]
J2  JU05  [JU05]
JP2  JP1E  [JP1]
JP23  JP1E  [JP1]
JP24  JP2E  [JP2]
JP29  JP1E  [JP1]
LED7  LEDSML1206  [SML1206]
R3  2.2KOHM  RESISTOR0603-RES  [0603-RES]
R4  100UOHMS  RESISTOR0603-RES  [0603-RES]
R5  500ohm  RESISTOR0603-RES  [0603-RES]
R6  500ohm  RESISTOR0603-RES  [0603-RES]
R22  3.3k  RESISTOR0603-RES  [0603-RES]
R36  560ohms  RESISTOR0603-RES  [0603-RES]
SV4  MA03-2  [MA03-2]
U$2  MM912_637D1  [QFN48]
X2  KK-156-2  [KK-156-2]

### Nets
5V_SUP_J1: JP23.2 U$2.21(VSUP)
5V_SUPERVISED: C9.1 JP23.1 ; also sheet 2,5,7,13,15,19,20,21,22,23,24,25,26
BKGNDB: R22.1 SV4.6
CON_MONB_+: JP2.1 ; also sheet 2,6,13
CON_MONB_+_J: JP2.2 LED7.A R3.2
CON_MONB_-: JP24.1 R4.2 R5.2 ; also sheet 2,6,28
CON_MONC_+: R4.1 R6.2 ; also sheet 2,15
GND: C7.2 C8.2 C9.2 C10.2 JP24.3 R36.1 SV4.5 U$2.4(TEST) U$2.11(VSSRX) U$2.13(VSSD2D) U$2.16(GNDSUB) U$2.18(DGND) U$2.20(GNDSUB1) U$2.30(GNDSUB2) U$2.41(GNDSUB3) U$2.44(DGND1) ; also sheet 2,3,4,5,6,7,8,9,12,13,15,17,18,19,20,21,22,23,24,25,26,28
MCU_BATMON_LIN: U$2.22(LIN) ; also sheet 5,13,15
MCU_BATMON_LINGND: U$2.23(LGND) ; also sheet 5,13,15
MCU_IO_RALAYB: U$2.6(PA4) ; also sheet 3
MONB_AGND: C6.2 JP24.2 U$2.27(AGND) U$2.33(ADCGND)
N$3: J2.5 U$2.10(PA0/MISO)
N$9: JP29.1 U$2.45(*RESET_A)
N$17: J2.4 U$2.9(PA1/MOSI)
N$30: J2.3 U$2.8(PA2/SCK)
N$31: J2.2 U$2.7(PA3/*SS)
N$32: R3.1 U$2.34(VSENSE)
N$37: C10.1 U$2.29(TSUP) X2.1
N$38: U$2.28(VTEMP) X2.2
N$40: JP29.2 SV4.3 U$2.46(*RESET)
N$41: R6.1 U$2.32(ISENSEH)
N$42: C6.1 U$2.26(VDDA)
N$43: R5.1 U$2.31(ISENSEL)
N$44: C8.1 U$2.14(VDDD2D) U$2.19(VDDH)
N$73: LED7.C R36.2
VDDXB: C7.1 R22.2 SV4.1 U$2.12(VDDRX) U$2.17(VDDX)
Unconnected: J2.1 SV4.2 SV4.4 U$2.1(PA6) U$2.2(PE0/EXTAL) U$2.3(PE1/XTAL) U$2.5(PA5) U$2.35(VOPT) U$2.36(PTB3/L0) U$2.37(PTB2) U$2.38(PTB1) U$2.39(PTB0) U$2.40(TCLK) U$2.42(VDDL) U$2.43(TEST_A) U$2.47(BKGD/MODC) U$2.48(PA7)

### Notes on the sheet
- Battery Monitor B
- TEMP CONNECTOR

## Sheet 15 of 28: Battery C
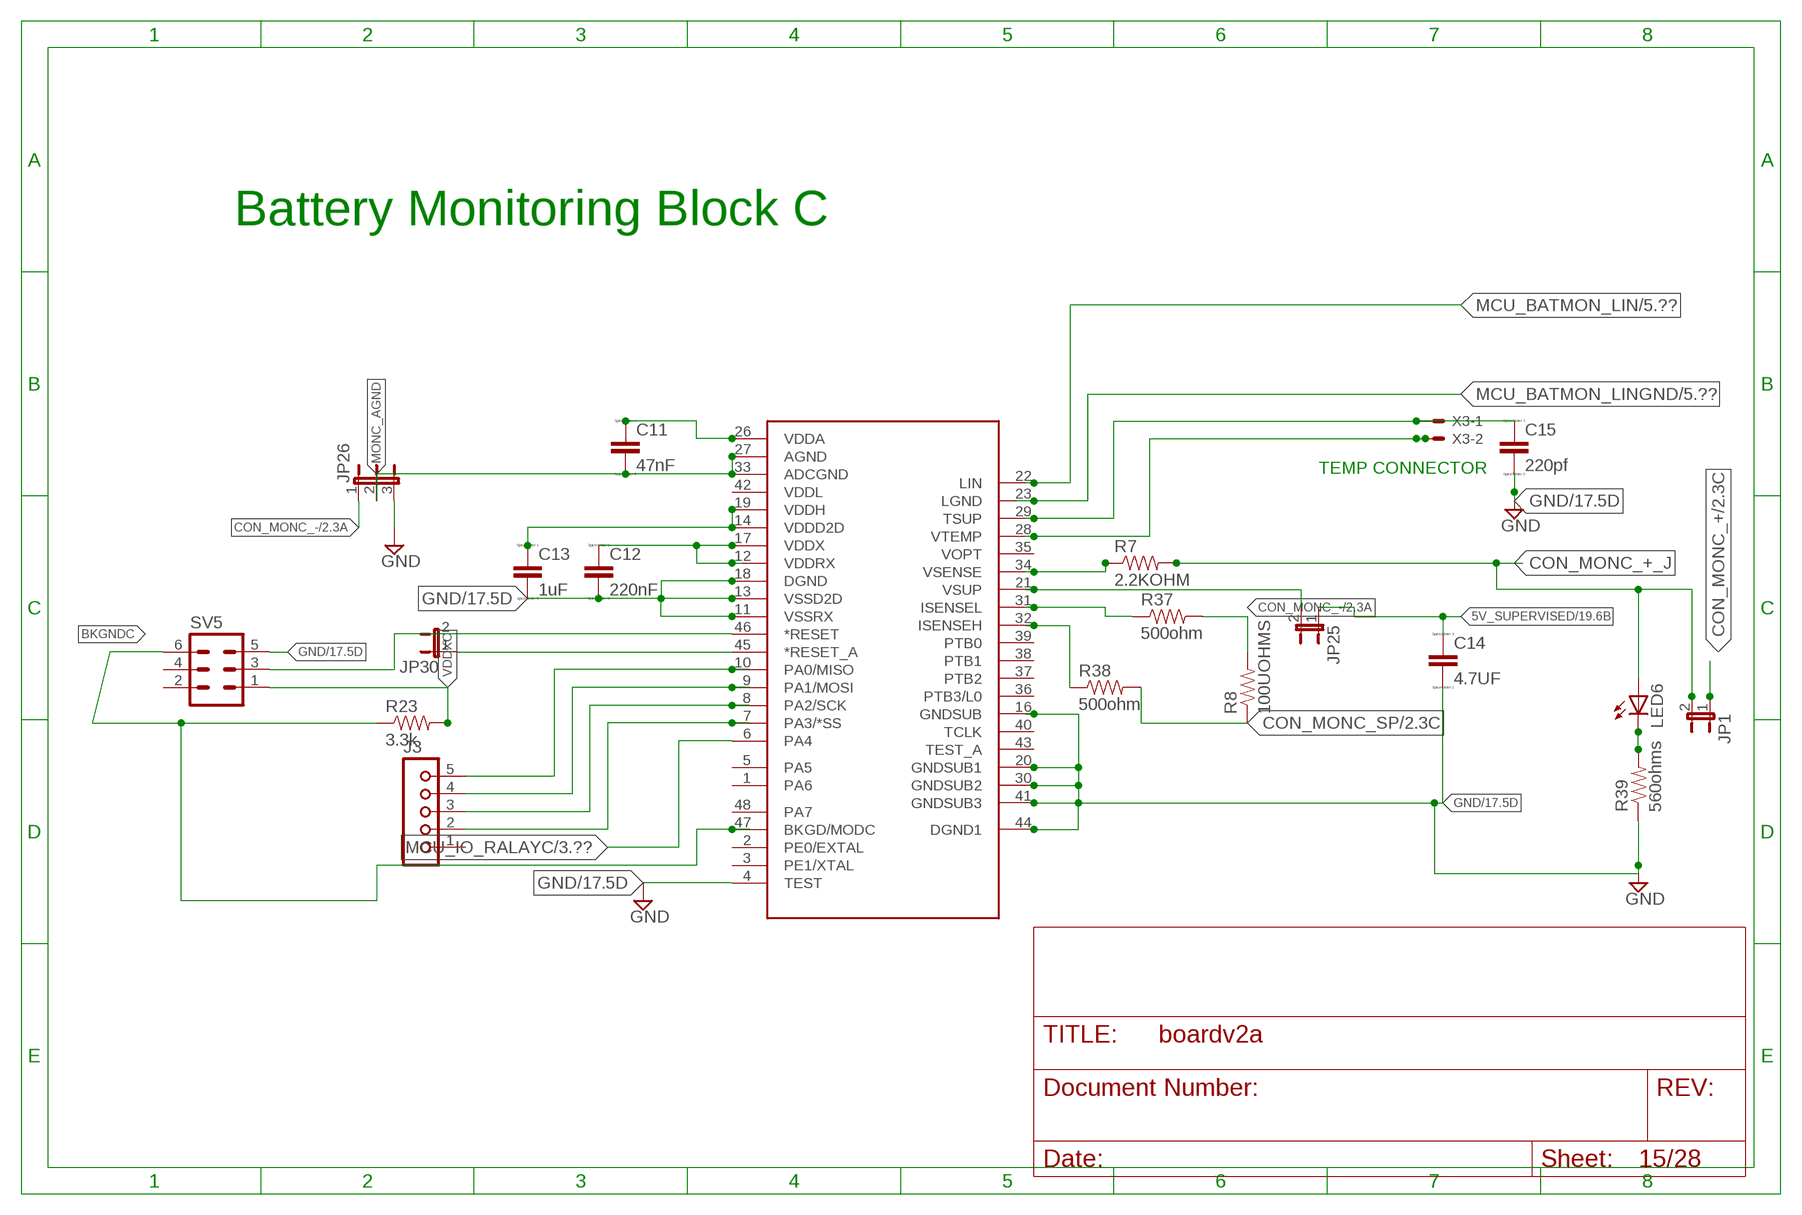
[diagram p15: schematic, sheet 15]

### Parts
C11  47nF  CC0603  [C0603]
C12  220nF  CC0603  [C0603]
C13  1uF  CC0603  [C0603]
C14  4.7UF  CC0603  [C0603]
C15  220pf  CC0603  [C0603]
J3  JU05  [JU05]
JP1  JP1E  [JP1]
JP25  JP1E  [JP1]
JP26  JP2E  [JP2]
JP30  JP1E  [JP1]
LED6  LEDSML1206  [SML1206]
R7  2.2KOHM  RESISTOR0603-RES  [0603-RES]
R8  100UOHMS  RESISTOR0603-RES  [0603-RES]
R23  3.3k  RESISTOR0603-RES  [0603-RES]
R37  500ohm  RESISTOR0603-RES  [0603-RES]
R38  500ohm  RESISTOR0603-RES  [0603-RES]
R39  560ohms  RESISTOR0603-RES  [0603-RES]
SV5  MA03-2  [MA03-2]
U$3  MM912_637D1  [QFN48]
X3  KK-156-2  [KK-156-2]

### Nets
5V_SU_J123: JP25.2 U$3.21(VSUP)
5V_SUPERVISED: C14.1 JP25.1 ; also sheet 2,5,7,13,14,19,20,21,22,23,24,25,26
BKGNDC: R23.1 SV5.6 U$3.47(BKGD/MODC)
CON_MONC_+: JP1.1 ; also sheet 2,14
CON_MONC_+_J: JP1.2 LED6.A R7.2
CON_MONC_-: JP26.1 R8.2 R37.2 ; also sheet 2
CON_MONC_SP: R8.1 R38.2 ; also sheet 2
GND: C12.2 C13.2 C14.2 C15.2 JP26.3 R39.1 SV5.5 U$3.4(TEST) U$3.11(VSSRX) U$3.13(VSSD2D) U$3.16(GNDSUB) U$3.18(DGND) U$3.20(GNDSUB1) U$3.30(GNDSUB2) U$3.41(GNDSUB3) U$3.44(DGND1) ; also sheet 2,3,4,5,6,7,8,9,12,13,14,17,18,19,20,21,22,23,24,25,26,28
MCU_BATMON_LIN: U$3.22(LIN) ; also sheet 5,13,14
MCU_BATMON_LINGND: U$3.23(LGND) ; also sheet 5,13,14
MCU_IO_RALAYC: U$3.6(PA4) ; also sheet 3
MONC_AGND: C11.2 JP26.2 U$3.27(AGND) U$3.33(ADCGND)
N$2: JP30.2 SV5.3 U$3.46(*RESET)
N$19: JP30.1 U$3.45(*RESET_A)
N$79: J3.5 U$3.10(PA0/MISO)
N$117: J3.4 U$3.9(PA1/MOSI)
N$118: J3.3 U$3.8(PA2/SCK)
N$119: J3.2 U$3.7(PA3/*SS)
N$120: R7.1 U$3.34(VSENSE)
N$121: C12.1 U$3.12(VDDRX) U$3.17(VDDX)
N$122: C15.1 U$3.29(TSUP) X3.1
N$123: U$3.28(VTEMP) X3.2
N$125: R38.1 U$3.32(ISENSEH)
N$126: C11.1 U$3.26(VDDA)
N$127: R37.1 U$3.31(ISENSEL)
N$129: LED6.C R39.2
VDDXC: C13.1 R23.2 SV5.1 U$3.14(VDDD2D) U$3.19(VDDH)
Unconnected: J3.1 SV5.2 SV5.4 U$3.1(PA6) U$3.2(PE0/EXTAL) U$3.3(PE1/XTAL) U$3.5(PA5) U$3.35(VOPT) U$3.36(PTB3/L0) U$3.37(PTB2) U$3.38(PTB1) U$3.39(PTB0) U$3.40(TCLK) U$3.42(VDDL) U$3.43(TEST_A) U$3.48(PA7)

### Notes on the sheet
- Battery Monitoring Block C
- TEMP CONNECTOR

## Sheet 16 of 28: Analog Connector
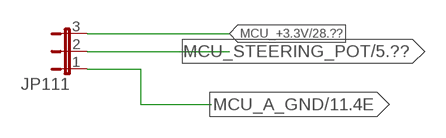
[diagram p16: schematic, sheet 16]

### Parts
JP111  JP2E  [JP2]

### Nets
MCU_+3.3V: JP111.3 ; also sheet 5,8,11,28
MCU_A_GND: JP111.1 ; also sheet 5,11
MCU_STEERING_POT: JP111.2 ; also sheet 5

## Sheet 17 of 28: Primary FPGA Block
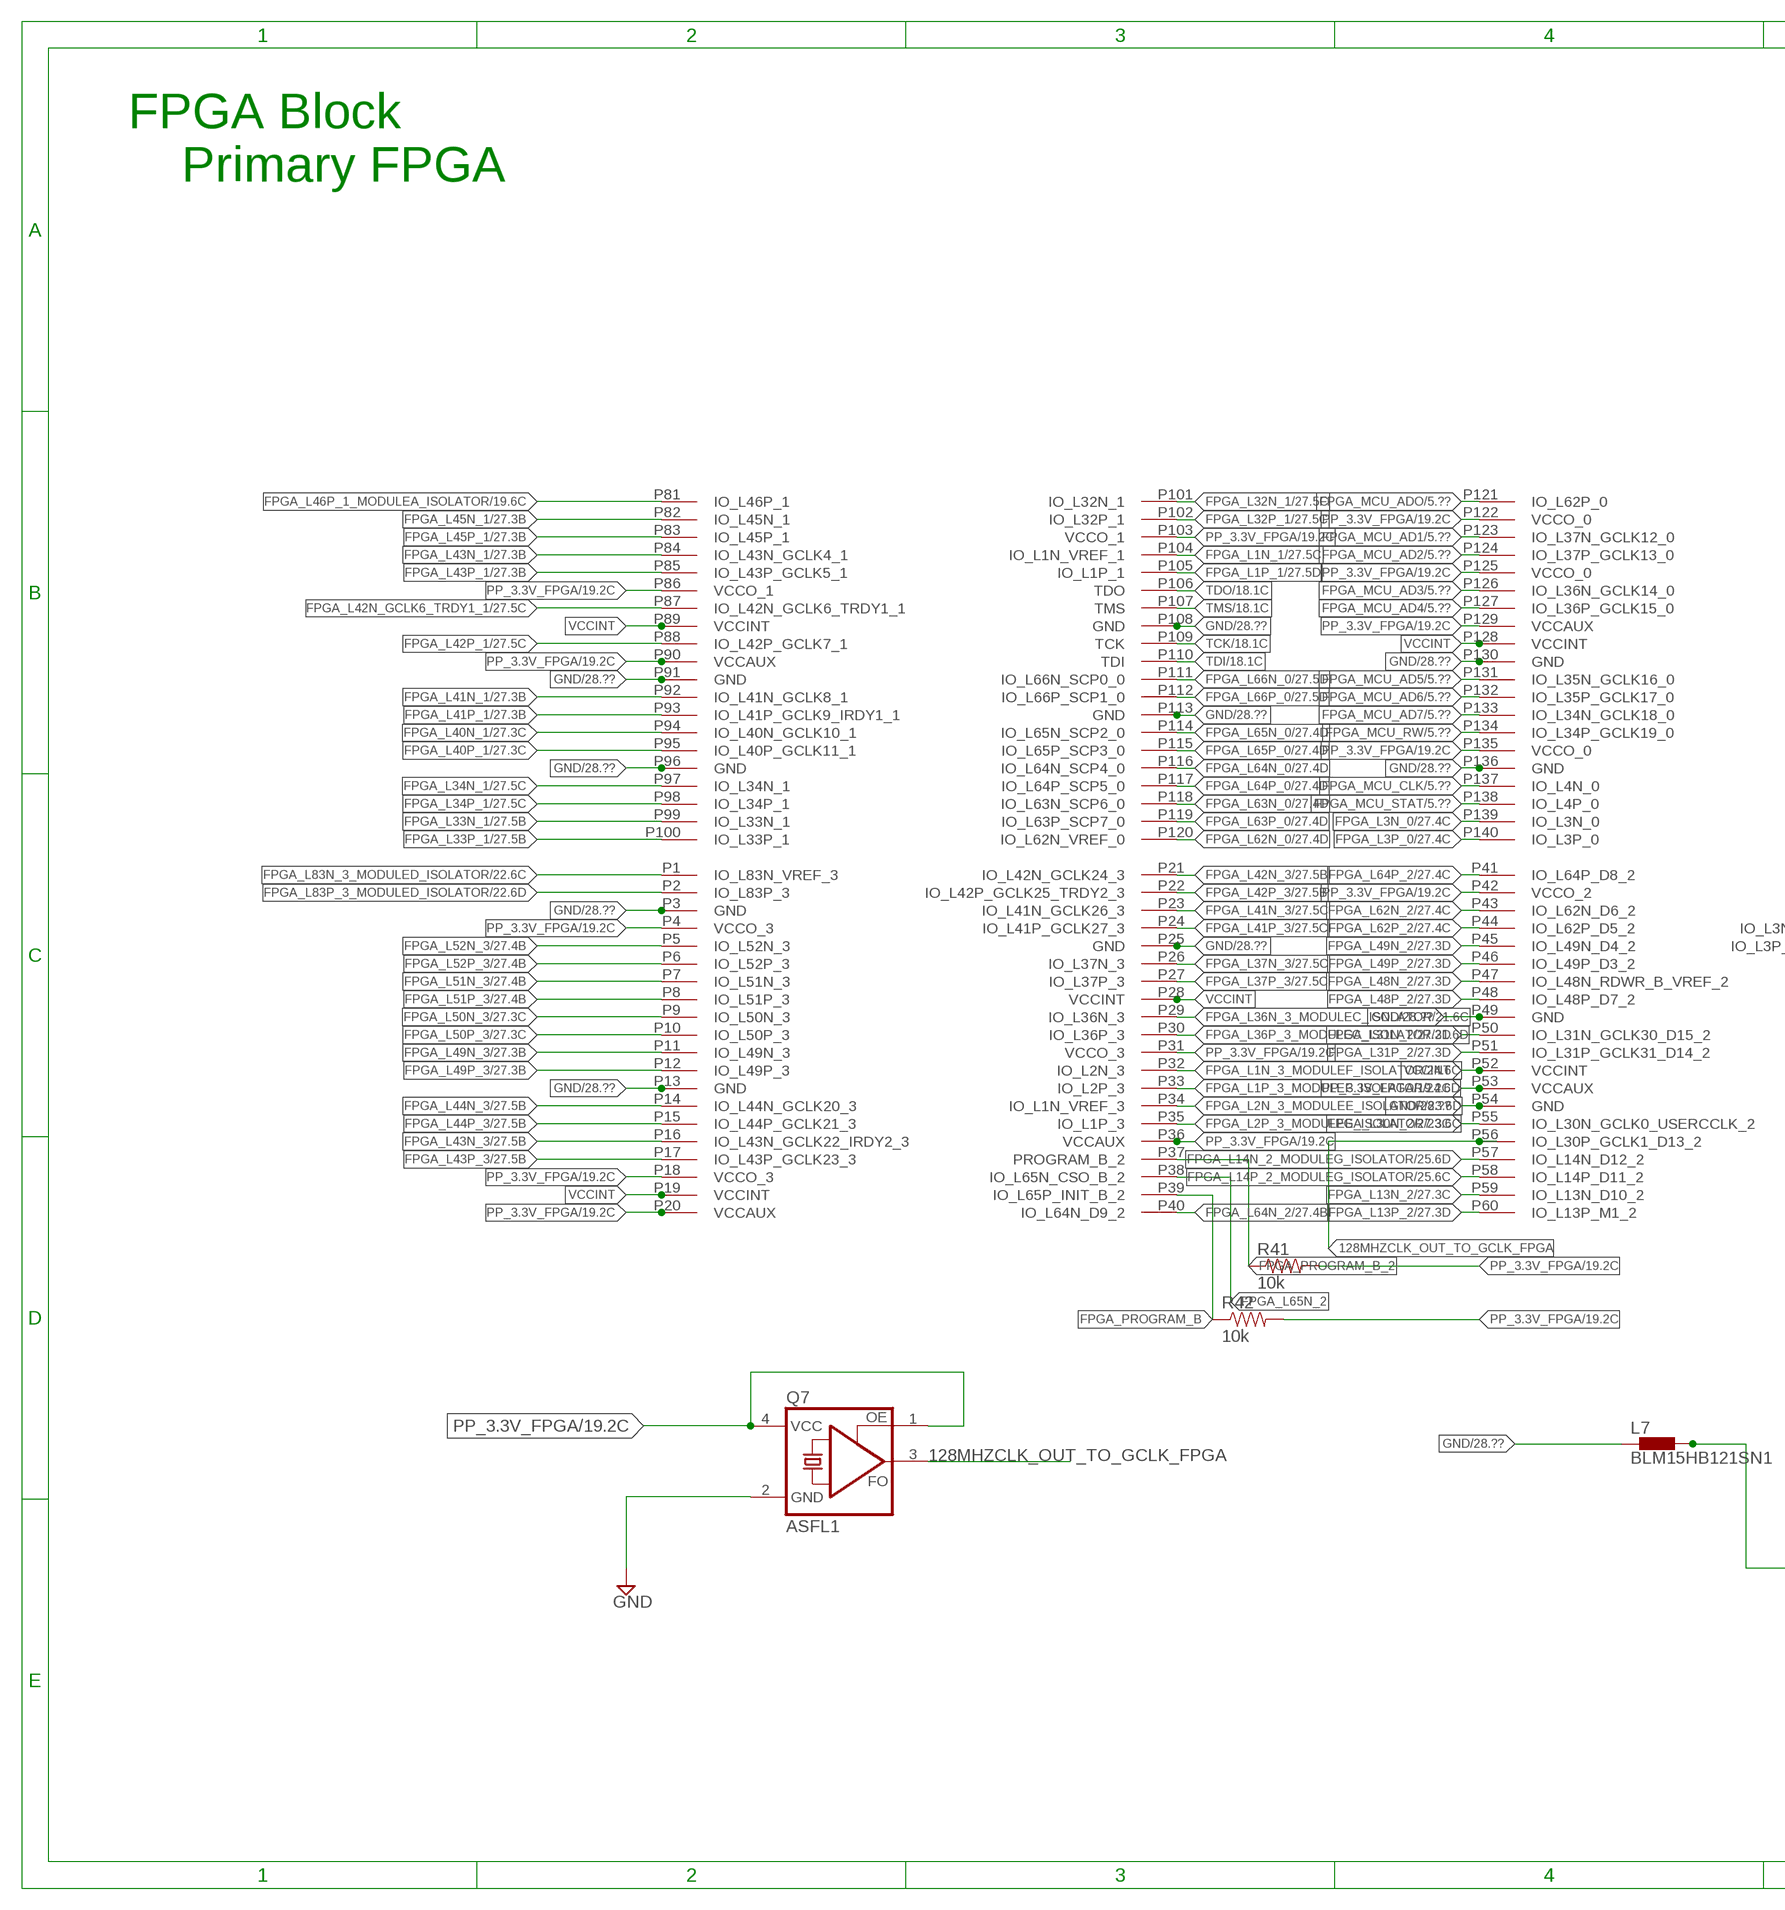
[diagram p17: schematic, sheet 17, part 1 of 2]
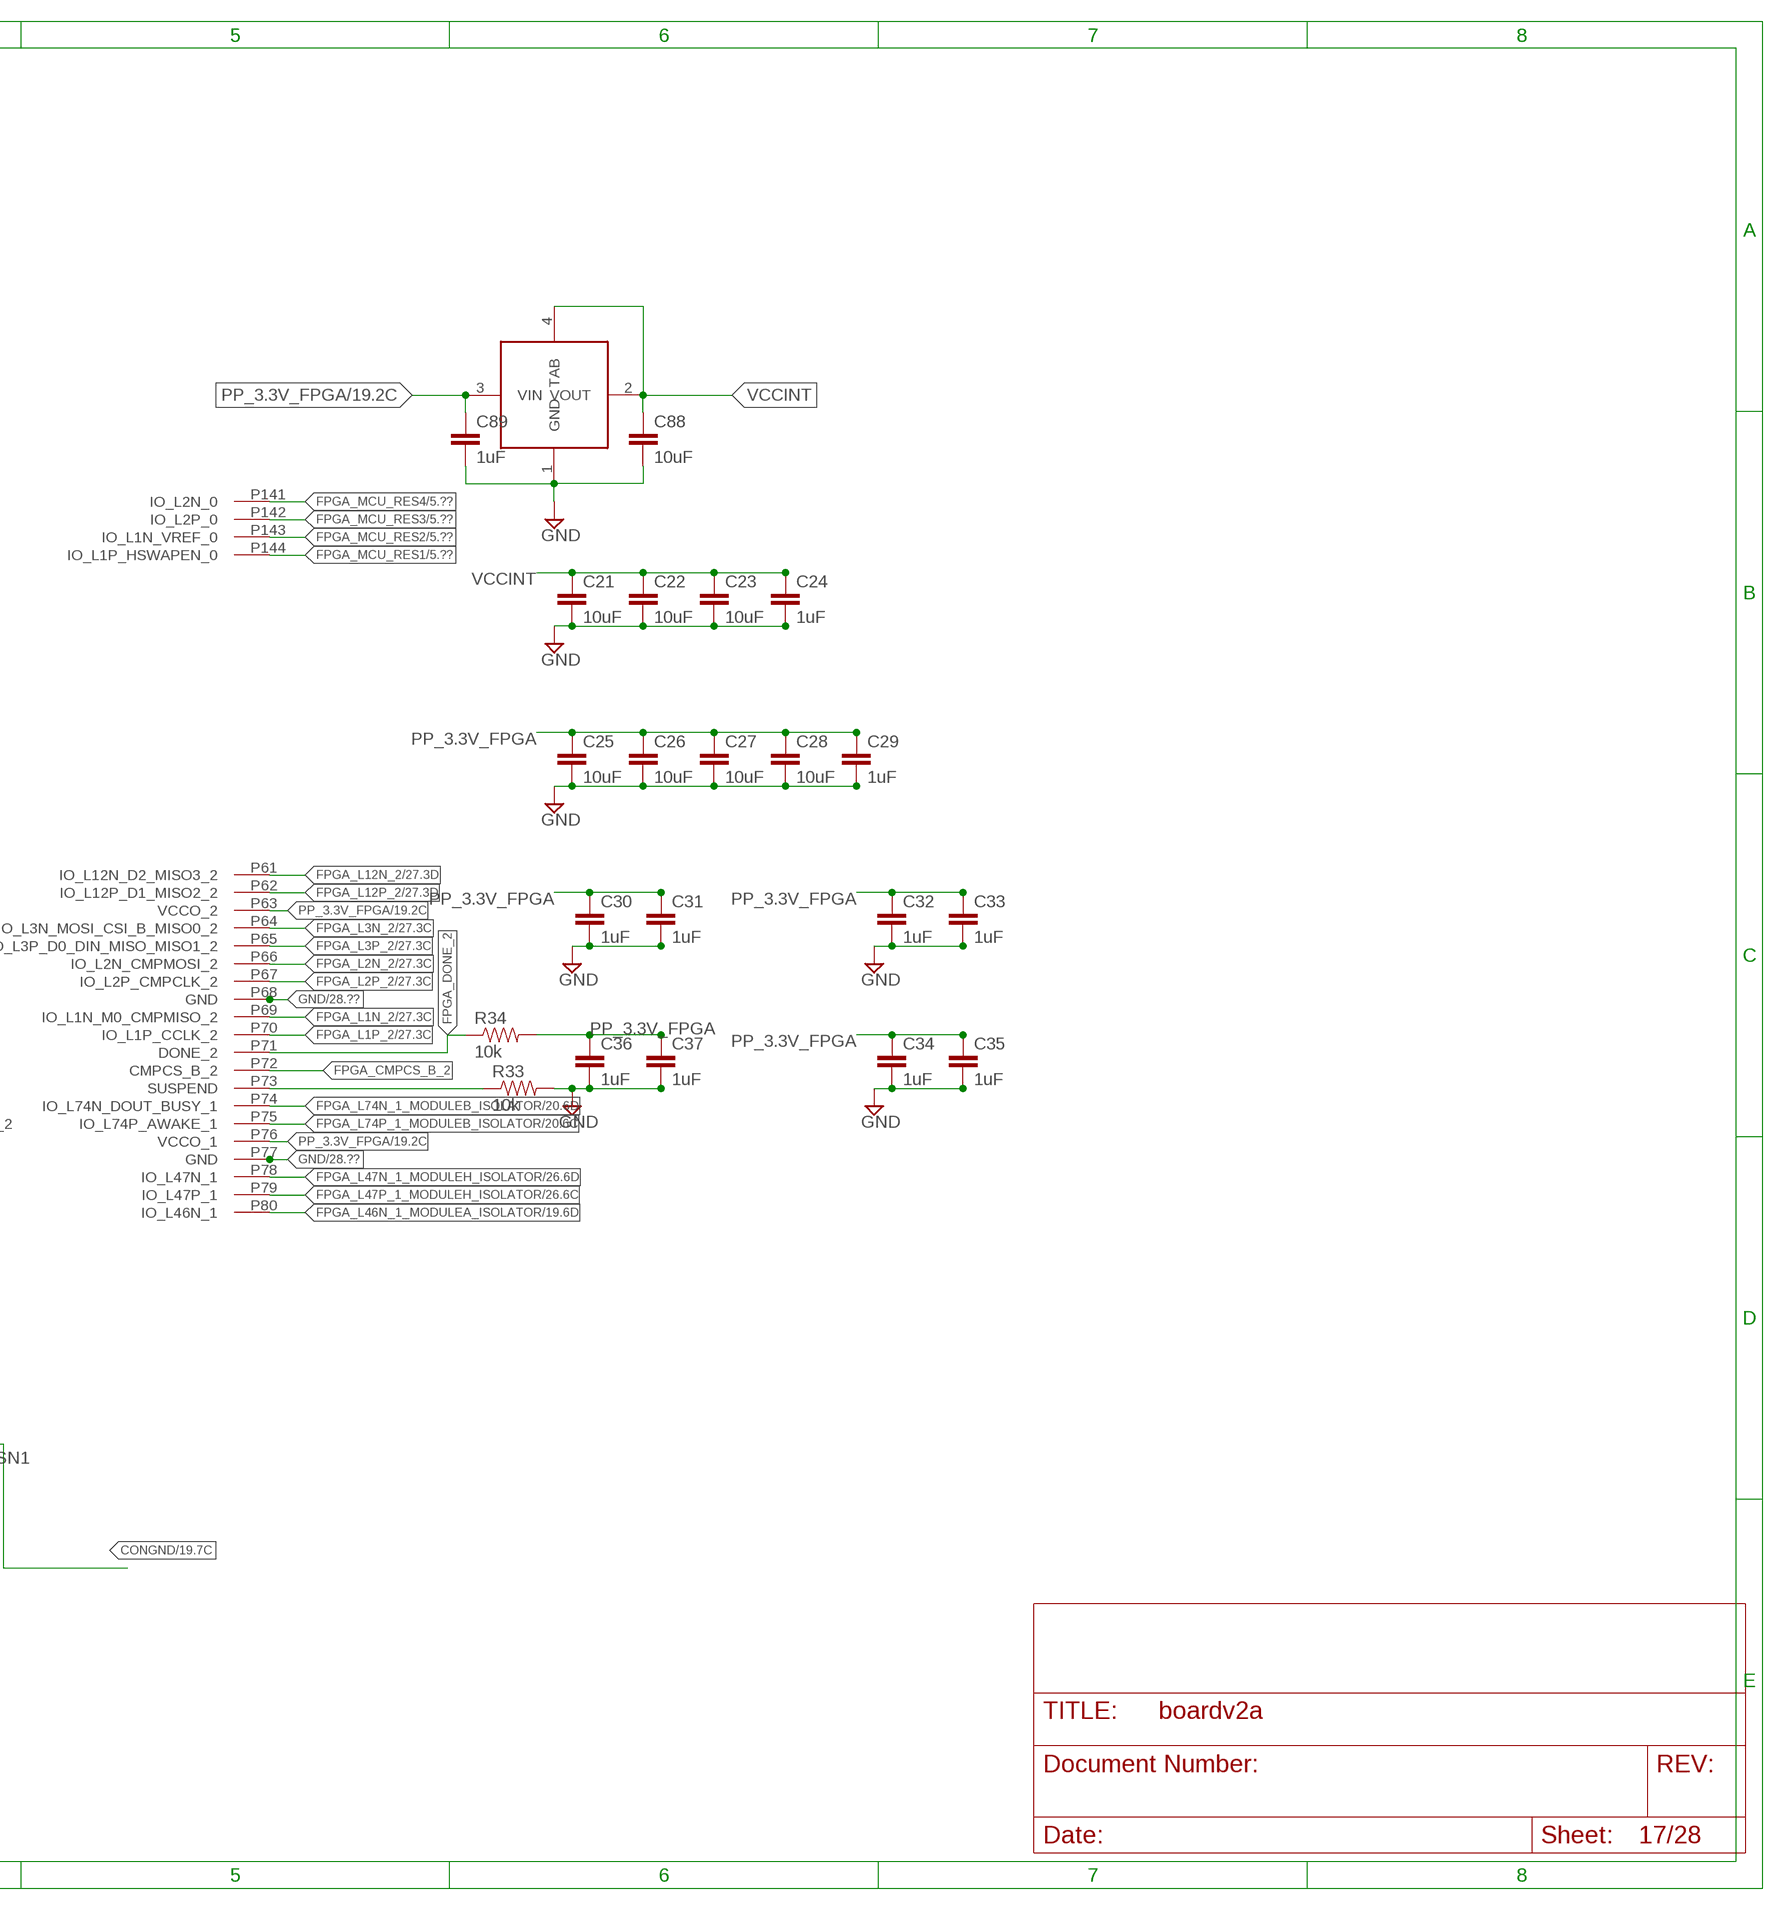
[diagram p18: schematic, sheet 17, part 2 of 2]

### Parts
C21  10uF  CAP0603-CAP  [0603-CAP]
C22  10uF  CAP0603-CAP  [0603-CAP]
C23  10uF  CAP0603-CAP  [0603-CAP]
C24  1uF  CAP0603-CAP  [0603-CAP]
C25  10uF  CAP0603-CAP  [0603-CAP]
C26  10uF  CAP0603-CAP  [0603-CAP]
C27  10uF  CAP0603-CAP  [0603-CAP]
C28  10uF  CAP0603-CAP  [0603-CAP]
C29  1uF  CAP0603-CAP  [0603-CAP]
C30  1uF  CAP0603-CAP  [0603-CAP]
C31  1uF  CAP0603-CAP  [0603-CAP]
C32  1uF  CAP0603-CAP  [0603-CAP]
C33  1uF  CAP0603-CAP  [0603-CAP]
C34  1uF  CAP0603-CAP  [0603-CAP]
C35  1uF  CAP0603-CAP  [0603-CAP]
C36  1uF  CAP0603-CAP  [0603-CAP]
C37  1uF  CAP0603-CAP  [0603-CAP]
C88  10uF  CAP0603-CAP  [0603-CAP]
C89  1uF  CAP0603-CAP  [0603-CAP]
L7  BLM15HB121SN1  [0402]
Q7  ASFL1  [ASF]
R33  10k  RESISTOR0603-RES  [0603-RES]
R34  10k  RESISTOR0603-RES  [0603-RES]
R41  10k  RESISTOR0603-RES  [0603-RES]
R42  10k  RESISTOR0603-RES  [0603-RES]
U$6  XC6SLX4-2TQG144C  [TQ144]
U$11  1.2VREG  [SOT-223]

### Nets
128MHZCLK_OUT_TO_GCLK_FPGA: Q7.3(FO) U$6.P56(IO_L30P_GCLK1_D13_2)
CONGND: L7.2 ; also sheet 19,20,21,22,23,24,25,26
FPGA_CMPCS_B_2: U$6.P72(CMPCS_B_2)
FPGA_DONE_2: R34.1 U$6.P71(DONE_2)
FPGA_L1N_1: U$6.P104(IO_L1N_VREF_1) ; also sheet 27
FPGA_L1N_2: U$6.P69(IO_L1N_M0_CMPMISO_2) ; also sheet 27
FPGA_L1N_3_MODULEF_ISOLATOR: U$6.P32(IO_L2N_3) ; also sheet 24
FPGA_L1P_1: U$6.P105(IO_L1P_1) ; also sheet 27
FPGA_L1P_2: U$6.P70(IO_L1P_CCLK_2) ; also sheet 27
FPGA_L1P_3_MODULEF_ISOLATOR: U$6.P33(IO_L2P_3) ; also sheet 24
FPGA_L2N_2: U$6.P66(IO_L2N_CMPMOSI_2) ; also sheet 27
FPGA_L2N_3_MODULEE_ISOLATOR: U$6.P34(IO_L1N_VREF_3) ; also sheet 23
FPGA_L2P_2: U$6.P67(IO_L2P_CMPCLK_2) ; also sheet 27
FPGA_L2P_3_MODULEE_ISOLATOR: U$6.P35(IO_L1P_3) ; also sheet 23
FPGA_L3N_0: U$6.P139(IO_L3N_0) ; also sheet 27
FPGA_L3N_2: U$6.P64(IO_L3N_MOSI_CSI_B_MISO0_2) ; also sheet 27
FPGA_L3P_0: U$6.P140(IO_L3P_0) ; also sheet 27
FPGA_L3P_2: U$6.P65(IO_L3P_D0_DIN_MISO_MISO1_2) ; also sheet 27
FPGA_L12N_2: U$6.P61(IO_L12N_D2_MISO3_2) ; also sheet 27
FPGA_L12P_2: U$6.P62(IO_L12P_D1_MISO2_2) ; also sheet 27
FPGA_L13N_2: U$6.P59(IO_L13N_D10_2) ; also sheet 27
FPGA_L13P_2: U$6.P60(IO_L13P_M1_2) ; also sheet 27
FPGA_L14N_2_MODULEG_ISOLATOR: U$6.P57(IO_L14N_D12_2) ; also sheet 25
FPGA_L14P_2_MODULEG_ISOLATOR: U$6.P58(IO_L14P_D11_2) ; also sheet 25
FPGA_L30N_2: U$6.P55(IO_L30N_GCLK0_USERCCLK_2) ; also sheet 27
FPGA_L31N_2: U$6.P50(IO_L31N_GCLK30_D15_2) ; also sheet 27
FPGA_L31P_2: U$6.P51(IO_L31P_GCLK31_D14_2) ; also sheet 27
FPGA_L32N_1: U$6.P101(IO_L32N_1) ; also sheet 27
FPGA_L32P_1: U$6.P102(IO_L32P_1) ; also sheet 27
FPGA_L33N_1: U$6.P99(IO_L33N_1) ; also sheet 27
FPGA_L33P_1: U$6.P100(IO_L33P_1) ; also sheet 27
FPGA_L34N_1: U$6.P97(IO_L34N_1) ; also sheet 27
FPGA_L34P_1: U$6.P98(IO_L34P_1) ; also sheet 27
FPGA_L36N_3_MODULEC_ISOLATOR: U$6.P29(IO_L36N_3) ; also sheet 21
FPGA_L36P_3_MODULEC_ISOLATOR: U$6.P30(IO_L36P_3) ; also sheet 21
FPGA_L37N_3: U$6.P26(IO_L37N_3) ; also sheet 27
FPGA_L37P_3: U$6.P27(IO_L37P_3) ; also sheet 27
FPGA_L40N_1: U$6.P94(IO_L40N_GCLK10_1) ; also sheet 27
FPGA_L40P_1: U$6.P95(IO_L40P_GCLK11_1) ; also sheet 27
FPGA_L41N_1: U$6.P92(IO_L41N_GCLK8_1) ; also sheet 27
FPGA_L41N_3: U$6.P23(IO_L41N_GCLK26_3) ; also sheet 27
FPGA_L41P_1: U$6.P93(IO_L41P_GCLK9_IRDY1_1) ; also sheet 27
FPGA_L41P_3: U$6.P24(IO_L41P_GCLK27_3) ; also sheet 27
FPGA_L42N_3: U$6.P21(IO_L42N_GCLK24_3) ; also sheet 27
FPGA_L42N_GCLK6_TRDY1_1: U$6.P87(IO_L42N_GCLK6_TRDY1_1) ; also sheet 27
FPGA_L42P_1: U$6.P88(IO_L42P_GCLK7_1) ; also sheet 27
FPGA_L42P_3: U$6.P22(IO_L42P_GCLK25_TRDY2_3) ; also sheet 27
FPGA_L43N_1: U$6.P84(IO_L43N_GCLK4_1) ; also sheet 27
FPGA_L43N_3: U$6.P16(IO_L43N_GCLK22_IRDY2_3) ; also sheet 27
FPGA_L43P_1: U$6.P85(IO_L43P_GCLK5_1) ; also sheet 27
FPGA_L43P_3: U$6.P17(IO_L43P_GCLK23_3) ; also sheet 27
FPGA_L44N_3: U$6.P14(IO_L44N_GCLK20_3) ; also sheet 27
FPGA_L44P_3: U$6.P15(IO_L44P_GCLK21_3) ; also sheet 27
FPGA_L45N_1: U$6.P82(IO_L45N_1) ; also sheet 27
FPGA_L45P_1: U$6.P83(IO_L45P_1) ; also sheet 27
FPGA_L46N_1_MODULEA_ISOLATOR: U$6.P80(IO_L46N_1) ; also sheet 19
FPGA_L46P_1_MODULEA_ISOLATOR: U$6.P81(IO_L46P_1) ; also sheet 19
FPGA_L47N_1_MODULEH_ISOLATOR: U$6.P78(IO_L47N_1) ; also sheet 26
FPGA_L47P_1_MODULEH_ISOLATOR: U$6.P79(IO_L47P_1) ; also sheet 26
FPGA_L48N_2: U$6.P47(IO_L48N_RDWR_B_VREF_2) ; also sheet 27
FPGA_L48P_2: U$6.P48(IO_L48P_D7_2) ; also sheet 27
FPGA_L49N_2: U$6.P45(IO_L49N_D4_2) ; also sheet 27
FPGA_L49N_3: U$6.P11(IO_L49N_3) ; also sheet 27
FPGA_L49P_2: U$6.P46(IO_L49P_D3_2) ; also sheet 27
FPGA_L49P_3: U$6.P12(IO_L49P_3) ; also sheet 27
FPGA_L50N_3: U$6.P9(IO_L50N_3) ; also sheet 27
FPGA_L50P_3: U$6.P10(IO_L50P_3) ; also sheet 27
FPGA_L51N_3: U$6.P7(IO_L51N_3) ; also sheet 27
FPGA_L51P_3: U$6.P8(IO_L51P_3) ; also sheet 27
FPGA_L52N_3: U$6.P5(IO_L52N_3) ; also sheet 27
FPGA_L52P_3: U$6.P6(IO_L52P_3) ; also sheet 27
FPGA_L62N_0: U$6.P120(IO_L62N_VREF_0) ; also sheet 27
FPGA_L62N_2: U$6.P43(IO_L62N_D6_2) ; also sheet 27
FPGA_L62P_2: U$6.P44(IO_L62P_D5_2) ; also sheet 27
FPGA_L63N_0: U$6.P118(IO_L63N_SCP6_0) ; also sheet 27
FPGA_L63P_0: U$6.P119(IO_L63P_SCP7_0) ; also sheet 27
FPGA_L64N_0: U$6.P116(IO_L64N_SCP4_0) ; also sheet 27
FPGA_L64N_2: U$6.P40(IO_L64N_D9_2) ; also sheet 27
FPGA_L64P_0: U$6.P117(IO_L64P_SCP5_0) ; also sheet 27
FPGA_L64P_2: U$6.P41(IO_L64P_D8_2) ; also sheet 27
FPGA_L65N_0: U$6.P114(IO_L65N_SCP2_0) ; also sheet 27
FPGA_L65N_2: U$6.P38(IO_L65N_CSO_B_2)
FPGA_L65P_0: U$6.P115(IO_L65P_SCP3_0) ; also sheet 27
FPGA_L66N_0: U$6.P111(IO_L66N_SCP0_0) ; also sheet 27
FPGA_L66P_0: U$6.P112(IO_L66P_SCP1_0) ; also sheet 27
FPGA_L74N_1_MODULEB_ISOLATOR: U$6.P74(IO_L74N_DOUT_BUSY_1) ; also sheet 20
FPGA_L74P_1_MODULEB_ISOLATOR: U$6.P75(IO_L74P_AWAKE_1) ; also sheet 20
FPGA_L83N_3_MODULED_ISOLATOR: U$6.P1(IO_L83N_VREF_3) ; also sheet 22
FPGA_L83P_3_MODULED_ISOLATOR: U$6.P2(IO_L83P_3) ; also sheet 22
FPGA_MCU_AD1: U$6.P123(IO_L37N_GCLK12_0) ; also sheet 5
FPGA_MCU_AD2: U$6.P124(IO_L37P_GCLK13_0) ; also sheet 5
FPGA_MCU_AD3: U$6.P126(IO_L36N_GCLK14_0) ; also sheet 5
FPGA_MCU_AD4: U$6.P127(IO_L36P_GCLK15_0) ; also sheet 5
FPGA_MCU_AD5: U$6.P131(IO_L35N_GCLK16_0) ; also sheet 5
FPGA_MCU_AD6: U$6.P132(IO_L35P_GCLK17_0) ; also sheet 5
FPGA_MCU_AD7: U$6.P133(IO_L34N_GCLK18_0) ; also sheet 5
FPGA_MCU_ADO: U$6.P121(IO_L62P_0) ; also sheet 5
FPGA_MCU_CLK: U$6.P137(IO_L4N_0) ; also sheet 5
FPGA_MCU_RES1: U$6.P144(IO_L1P_HSWAPEN_0) ; also sheet 5
FPGA_MCU_RES2: U$6.P143(IO_L1N_VREF_0) ; also sheet 5
FPGA_MCU_RES3: U$6.P142(IO_L2P_0) ; also sheet 5
FPGA_MCU_RES4: U$6.P141(IO_L2N_0) ; also sheet 5
FPGA_MCU_RW: U$6.P134(IO_L34P_GCLK19_0) ; also sheet 5
FPGA_MCU_STAT: U$6.P138(IO_L4P_0) ; also sheet 5
FPGA_PROGRAM_B: R42.1 U$6.P39(IO_L65P_INIT_B_2)
FPGA_PROGRAM_B_2: R41.1 U$6.P37(PROGRAM_B_2)
FPGA_SUSPEND: R33.1 U$6.P73(SUSPEND)
GND: C21.2 C22.2 C23.2 C24.2 C25.2 C26.2 C27.2 C28.2 C29.2 C30.2 C31.2 C32.2 C33.2 C34.2 C35.2 C36.2 C37.2 C88.2 C89.2 L7.1 Q7.2(GND) R33.2 U$6.P3(GND) U$6.P13(GND) U$6.P25(GND) U$6.P49(GND) U$6.P54(GND) U$6.P68(GND) U$6.P77(GND) U$6.P91(GND) U$6.P96(GND) U$6.P108(GND) U$6.P113(GND) U$6.P130(GND) U$6.P136(GND) U$11.1(GND) ; also sheet 2,3,4,5,6,7,8,9,12,13,14,15,18,19,20,21,22,23,24,25,26,28
PP_3.3V_FPGA: C25.1 C26.1 C27.1 C28.1 C29.1 C30.1 C31.1 C32.1 C33.1 C34.1 C35.1 C36.1 C37.1 C89.1 Q7.1(OE) Q7.4(VCC) R34.2 R41.2 R42.2 U$6.P4(VCCO_3) U$6.P18(VCCO_3) U$6.P20(VCCAUX) U$6.P31(VCCO_3) U$6.P36(VCCAUX) U$6.P42(VCCO_2) U$6.P53(VCCAUX) U$6.P63(VCCO_2) U$6.P76(VCCO_1) U$6.P86(VCCO_1) U$6.P90(VCCAUX) U$6.P103(VCCO_1) U$6.P122(VCCO_0) U$6.P125(VCCO_0) U$6.P129(VCCAUX) U$6.P135(VCCO_0) U$11.3(VIN) ; also sheet 19,20,21,22,23,24,25,26
TCK: U$6.P109(TCK) ; also sheet 18
TDI: U$6.P110(TDI) ; also sheet 18
TDO: U$6.P106(TDO) ; also sheet 18
TMS: U$6.P107(TMS) ; also sheet 18
VCCINT: C21.1 C22.1 C23.1 C24.1 C88.1 U$6.P19(VCCINT) U$6.P28(VCCINT) U$6.P52(VCCINT) U$6.P89(VCCINT) U$6.P128(VCCINT) U$11.2(VOUT) U$11.4(TAB)

### Notes on the sheet
- FPGA Block
- Primary FPGA

## Sheet 18 of 28: FPGA - JTAG Programmer
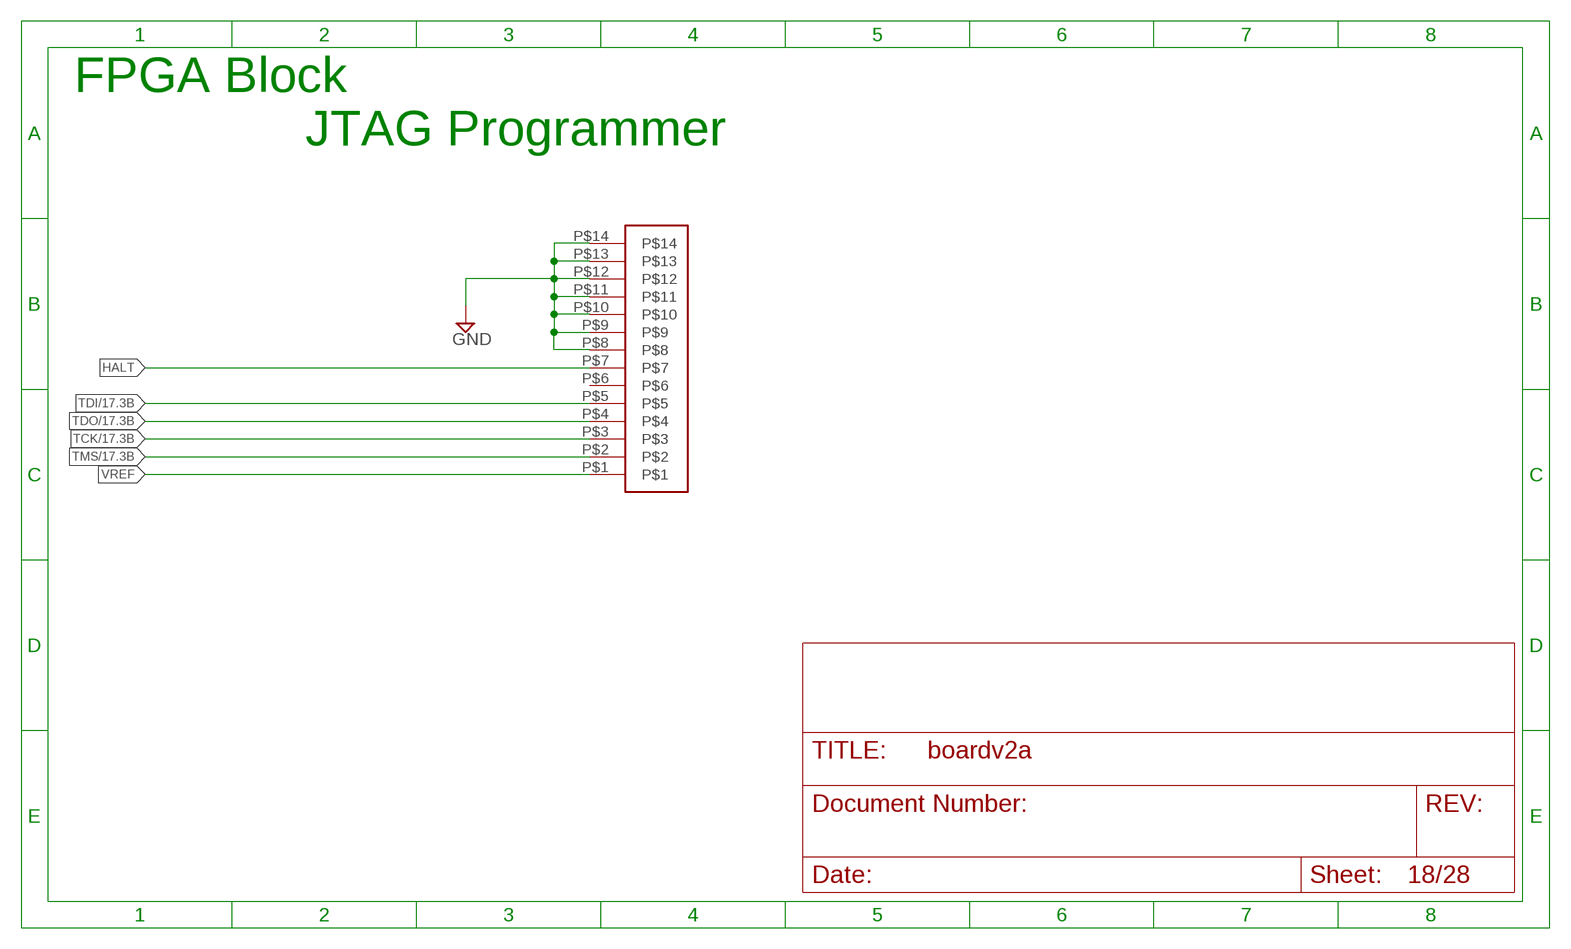
[diagram p19: schematic, sheet 18]

### Parts
U$7  JTAG14PIN  [JTAG14PIN]

### Nets
GND: U$7.P$8 U$7.P$9 U$7.P$10 U$7.P$11 U$7.P$12 U$7.P$13 U$7.P$14 ; also sheet 2,3,4,5,6,7,8,9,12,13,14,15,17,19,20,21,22,23,24,25,26,28
HALT: U$7.P$7
TCK: U$7.P$3 ; also sheet 17
TDI: U$7.P$5 ; also sheet 17
TDO: U$7.P$4 ; also sheet 17
TMS: U$7.P$2 ; also sheet 17
VREF: U$7.P$1
Unconnected: U$7.P$6

### Notes on the sheet
- FPGA Block
- JTAG Programmer

## Sheet 19 of 28: FPGA - Modular Connector A
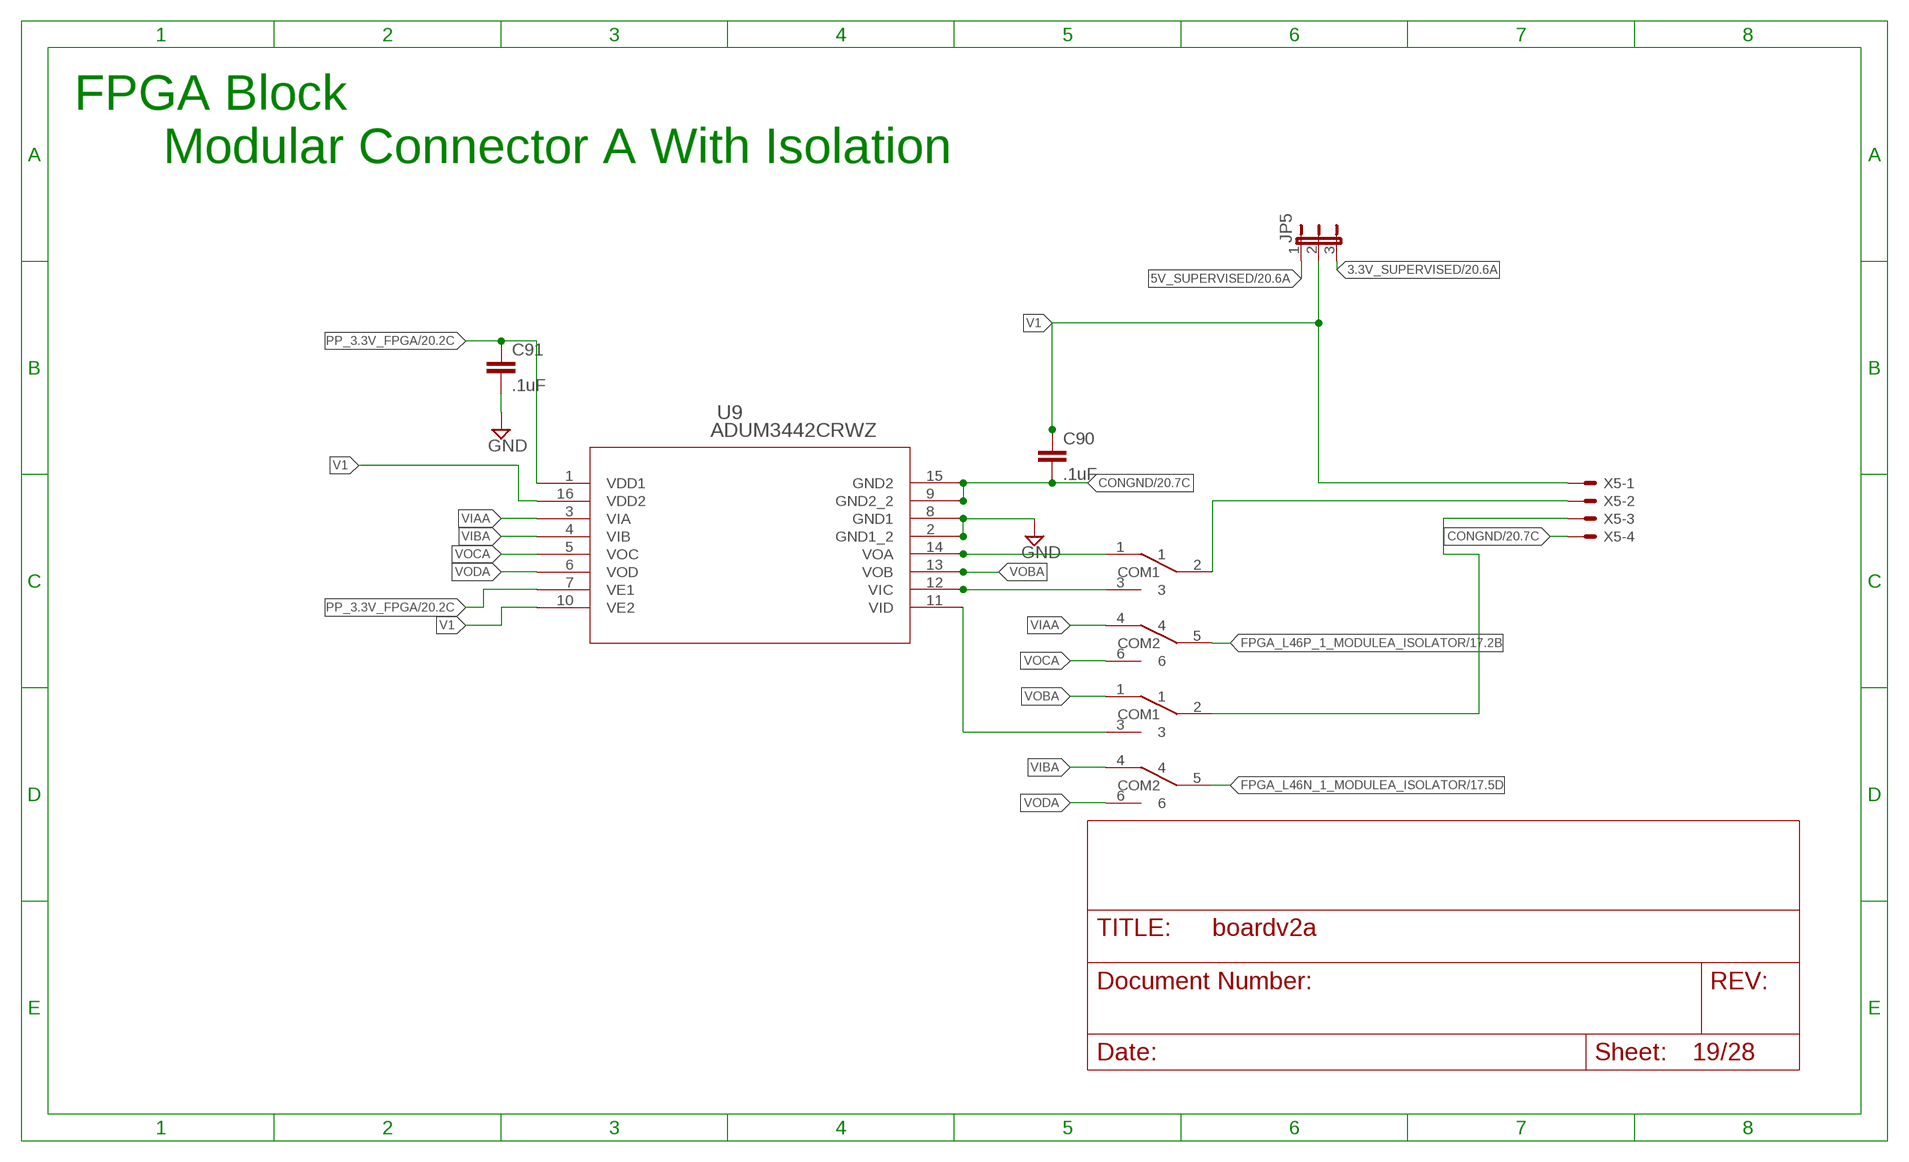
[diagram p20: schematic, sheet 19]

### Parts
C90  .1uF  CAP0603-CAP  [0603-CAP]
C91  .1uF  CAP0603-CAP  [0603-CAP]
JP5  JP2E  [JP2]
U9  ADUM3442CRWZ  [RW_16]
U$13  DPDTSWITCH  [JS202011]
U$14  DPDTSWITCH  [JS202011]
X5  KK-156-4  [KK-156-4]

### Nets
3.3V_SUPERVISED: JP5.3 ; also sheet 7,8,9,12,20,21,22,23,24,25,26
5V_SUPERVISED: JP5.1 ; also sheet 2,5,7,13,14,15,20,21,22,23,24,25,26
CONGND: C90.2 U9.9(GND2_2) U9.15(GND2) X5.4 ; also sheet 17,20,21,22,23,24,25,26
FPGA_L46N_1_MODULEA_ISOLATOR: U$13.5(COM2) ; also sheet 17
FPGA_L46P_1_MODULEA_ISOLATOR: U$14.5(COM2) ; also sheet 17
GND: C91.2 U9.2(GND1_2) U9.8(GND1) ; also sheet 2,3,4,5,6,7,8,9,12,13,14,15,17,18,20,21,22,23,24,25,26,28
N$64: U$14.2(COM1) X5.2
N$65: U$13.2(COM1) X5.3
N$66: U9.14(VOA) U$14.1
N$67: U9.12(VIC) U$14.3
N$68: U9.11(VID) U$13.3
PP_3.3V_FPGA: C91.1 U9.1(VDD1) U9.7(VE1) ; also sheet 17,20,21,22,23,24,25,26
V1: C90.1 JP5.2 U9.10(VE2) U9.16(VDD2) X5.1
VIAA: U9.3(VIA) U$14.4
VIBA: U9.4(VIB) U$13.4
VOBA: U9.13(VOB) U$13.1
VOCA: U9.5(VOC) U$14.6
VODA: U9.6(VOD) U$13.6

### Notes on the sheet
- FPGA Block
- Modular Connector A With Isolation

## Sheet 20 of 28: FPGA Modular Conenctor B
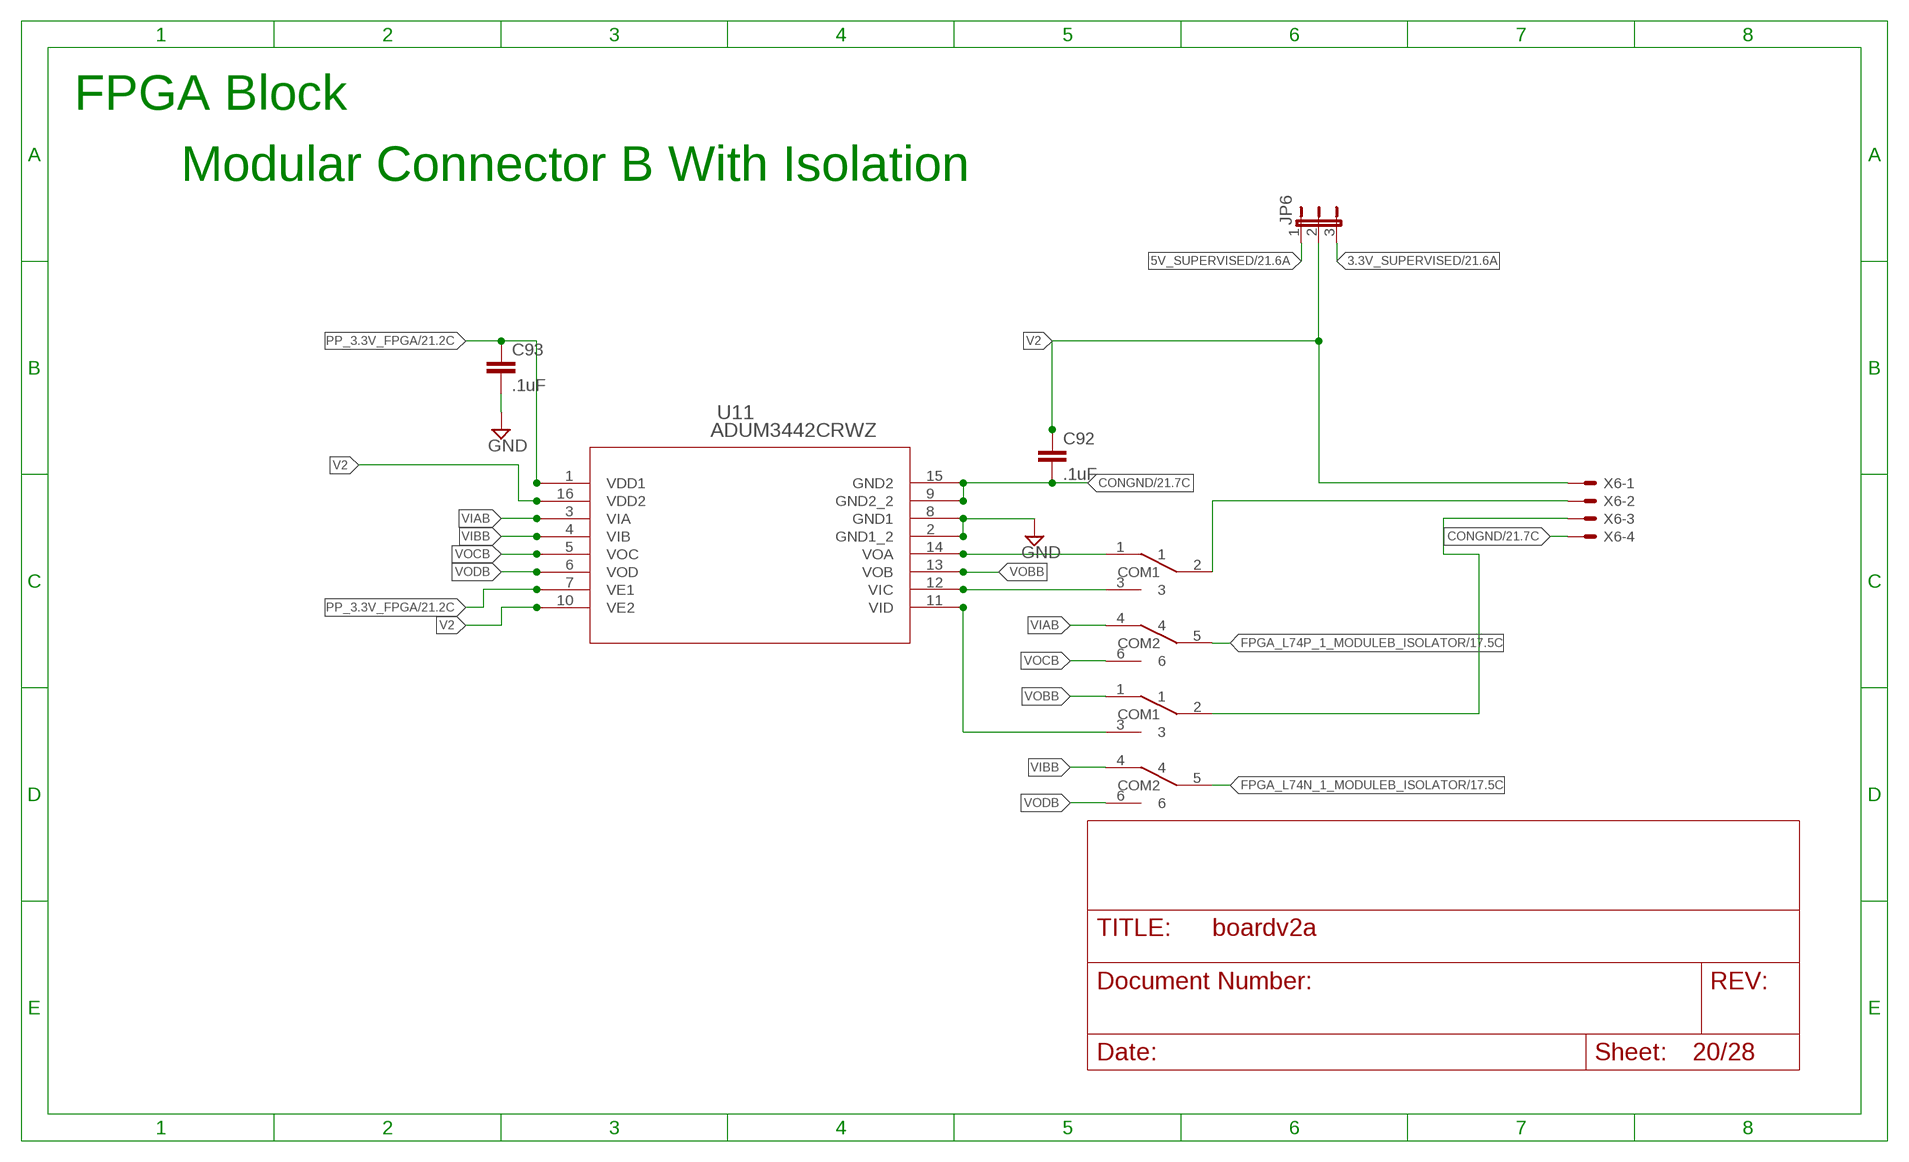
[diagram p21: schematic, sheet 20]

### Parts
C92  .1uF  CAP0603-CAP  [0603-CAP]
C93  .1uF  CAP0603-CAP  [0603-CAP]
JP6  JP2E  [JP2]
U11  ADUM3442CRWZ  [RW_16]
U$16  DPDTSWITCH  [JS202011]
U$17  DPDTSWITCH  [JS202011]
X6  KK-156-4  [KK-156-4]

### Nets
3.3V_SUPERVISED: JP6.3 ; also sheet 7,8,9,12,19,21,22,23,24,25,26
5V_SUPERVISED: JP6.1 ; also sheet 2,5,7,13,14,15,19,21,22,23,24,25,26
CONGND: C92.2 U11.9(GND2_2) U11.15(GND2) X6.4 ; also sheet 17,19,21,22,23,24,25,26
FPGA_L74N_1_MODULEB_ISOLATOR: U$16.5(COM2) ; also sheet 17
FPGA_L74P_1_MODULEB_ISOLATOR: U$17.5(COM2) ; also sheet 17
GND: C93.2 U11.2(GND1_2) U11.8(GND1) ; also sheet 2,3,4,5,6,7,8,9,12,13,14,15,17,18,19,21,22,23,24,25,26,28
N$69: U$17.2(COM1) X6.2
N$70: U$16.2(COM1) X6.3
N$71: U11.14(VOA) U$17.1
N$82: U11.12(VIC) U$17.3
N$83: U11.11(VID) U$16.3
PP_3.3V_FPGA: C93.1 U11.1(VDD1) U11.7(VE1) ; also sheet 17,19,21,22,23,24,25,26
V2: C92.1 JP6.2 U11.10(VE2) U11.16(VDD2) X6.1
VIAB: U11.3(VIA) U$17.4
VIBB: U11.4(VIB) U$16.4
VOBB: U11.13(VOB) U$16.1
VOCB: U11.5(VOC) U$17.6
VODB: U11.6(VOD) U$16.6

### Notes on the sheet
- FPGA Block
- Modular Connector B With Isolation

## Sheet 21 of 28: FPGA - Modular Connector C
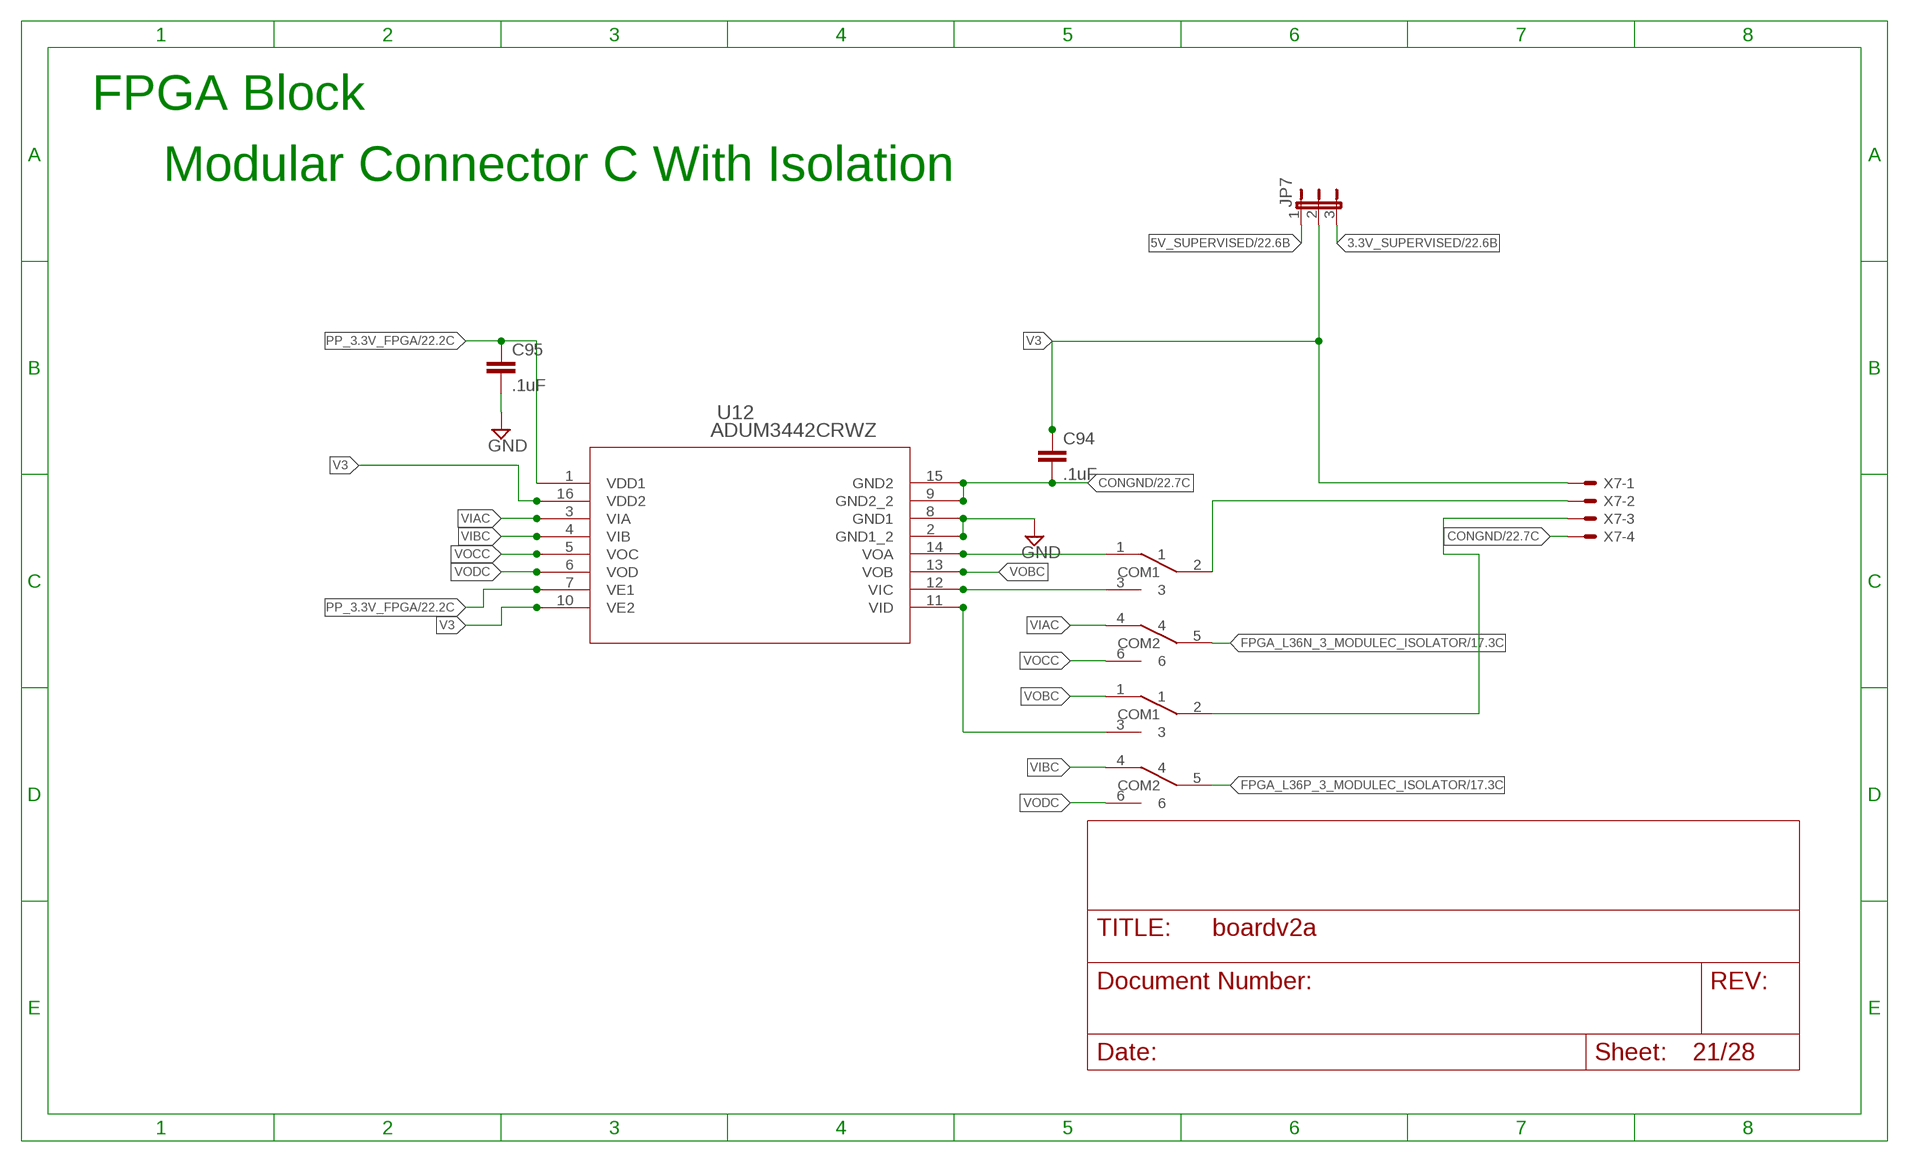
[diagram p22: schematic, sheet 21]

### Parts
C94  .1uF  CAP0603-CAP  [0603-CAP]
C95  .1uF  CAP0603-CAP  [0603-CAP]
JP7  JP2E  [JP2]
U12  ADUM3442CRWZ  [RW_16]
U$18  DPDTSWITCH  [JS202011]
U$19  DPDTSWITCH  [JS202011]
X7  KK-156-4  [KK-156-4]

### Nets
3.3V_SUPERVISED: JP7.3 ; also sheet 7,8,9,12,19,20,22,23,24,25,26
5V_SUPERVISED: JP7.1 ; also sheet 2,5,7,13,14,15,19,20,22,23,24,25,26
CONGND: C94.2 U12.9(GND2_2) U12.15(GND2) X7.4 ; also sheet 17,19,20,22,23,24,25,26
FPGA_L36N_3_MODULEC_ISOLATOR: U$19.5(COM2) ; also sheet 17
FPGA_L36P_3_MODULEC_ISOLATOR: U$18.5(COM2) ; also sheet 17
GND: C95.2 U12.2(GND1_2) U12.8(GND1) ; also sheet 2,3,4,5,6,7,8,9,12,13,14,15,17,18,19,20,22,23,24,25,26,28
N$84: U$19.2(COM1) X7.2
N$85: U$18.2(COM1) X7.3
N$86: U12.14(VOA) U$19.1
N$87: U12.12(VIC) U$19.3
N$88: U12.11(VID) U$18.3
PP_3.3V_FPGA: C95.1 U12.1(VDD1) U12.7(VE1) ; also sheet 17,19,20,22,23,24,25,26
V3: C94.1 JP7.2 U12.10(VE2) U12.16(VDD2) X7.1
VIAC: U12.3(VIA) U$19.4
VIBC: U12.4(VIB) U$18.4
VOBC: U12.13(VOB) U$18.1
VOCC: U12.5(VOC) U$19.6
VODC: U12.6(VOD) U$18.6

### Notes on the sheet
- FPGA Block
- Modular Connector C With Isolation

## Sheet 22 of 28: FPGA - Modular Conenctor D
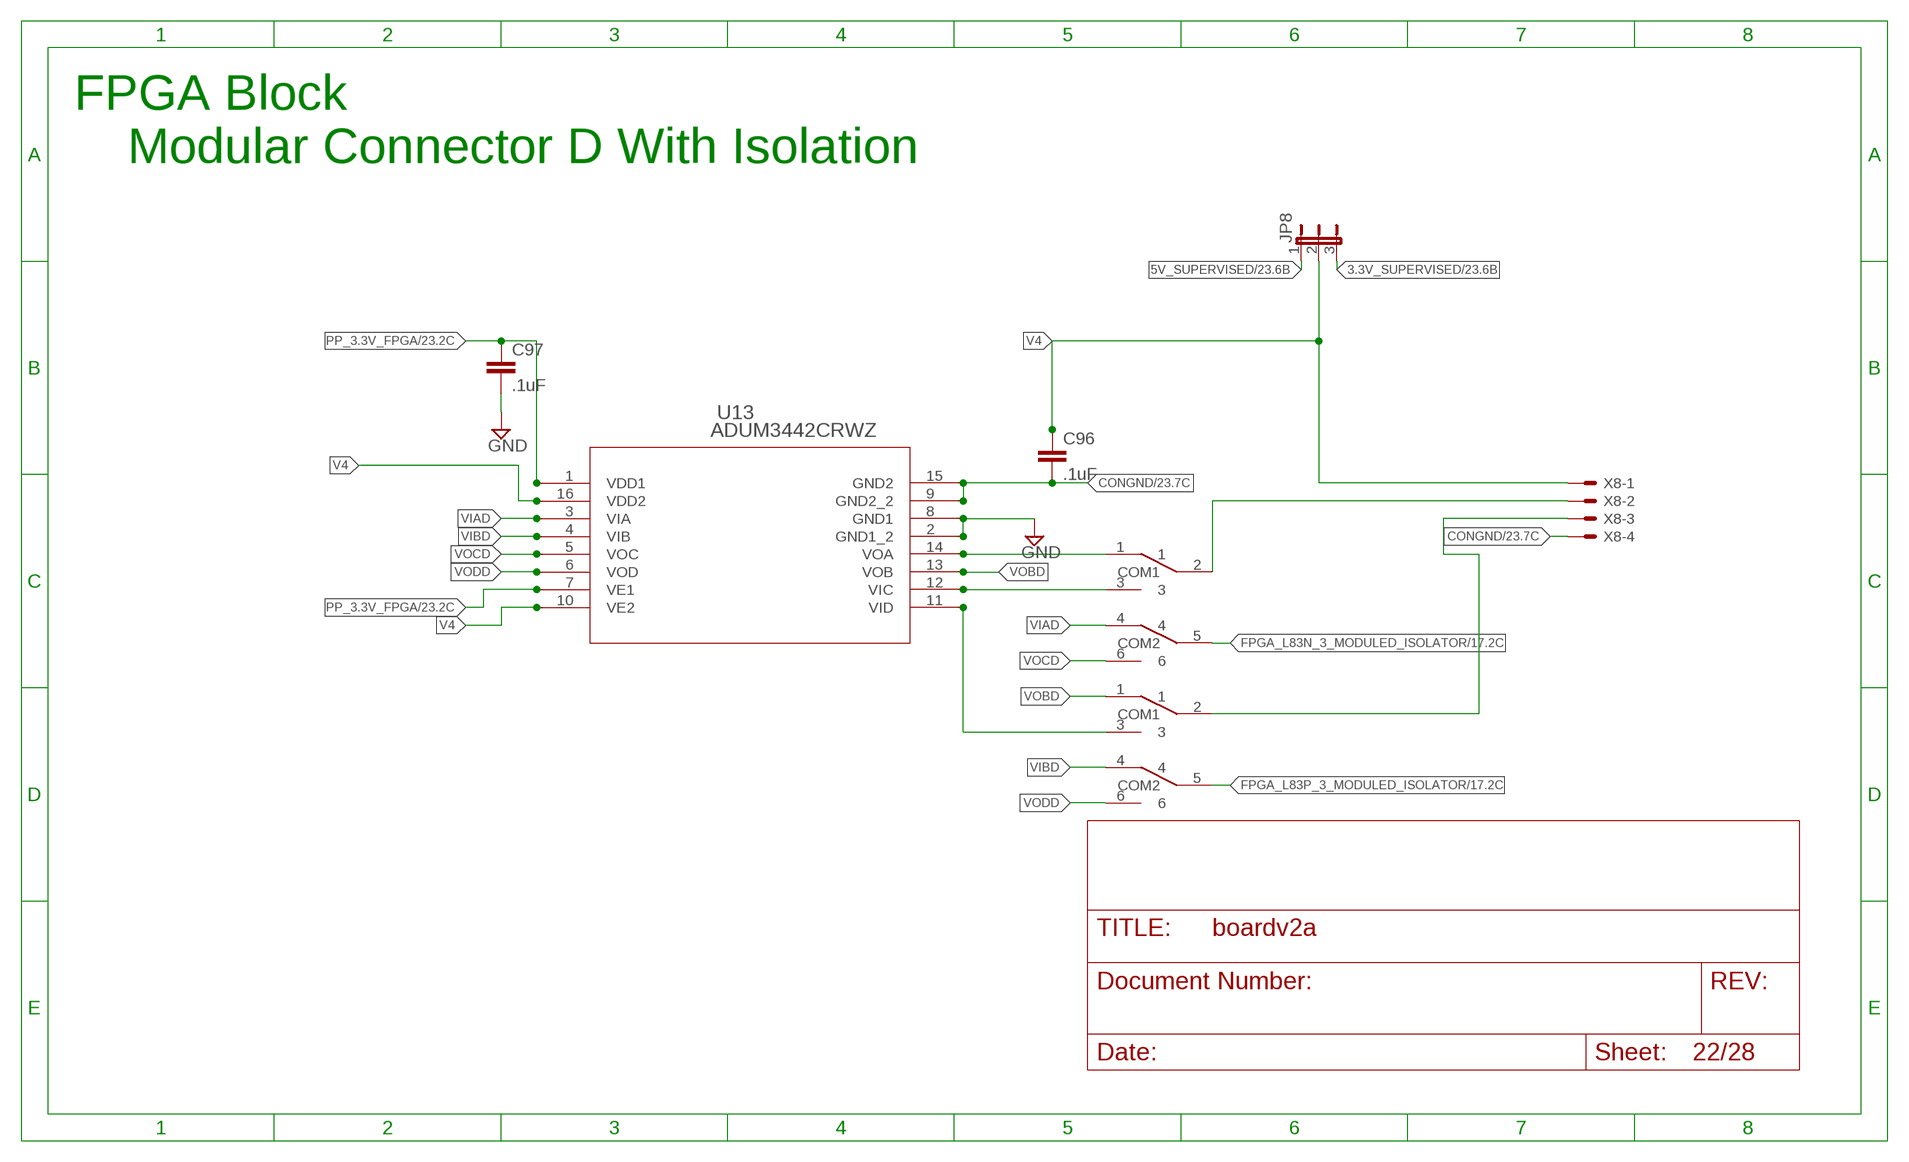
[diagram p23: schematic, sheet 22]

### Parts
C96  .1uF  CAP0603-CAP  [0603-CAP]
C97  .1uF  CAP0603-CAP  [0603-CAP]
JP8  JP2E  [JP2]
U13  ADUM3442CRWZ  [RW_16]
U$20  DPDTSWITCH  [JS202011]
U$23  DPDTSWITCH  [JS202011]
X8  KK-156-4  [KK-156-4]

### Nets
3.3V_SUPERVISED: JP8.3 ; also sheet 7,8,9,12,19,20,21,23,24,25,26
5V_SUPERVISED: JP8.1 ; also sheet 2,5,7,13,14,15,19,20,21,23,24,25,26
CONGND: C96.2 U13.9(GND2_2) U13.15(GND2) X8.4 ; also sheet 17,19,20,21,23,24,25,26
FPGA_L83N_3_MODULED_ISOLATOR: U$23.5(COM2) ; also sheet 17
FPGA_L83P_3_MODULED_ISOLATOR: U$20.5(COM2) ; also sheet 17
GND: C97.2 U13.2(GND1_2) U13.8(GND1) ; also sheet 2,3,4,5,6,7,8,9,12,13,14,15,17,18,19,20,21,23,24,25,26,28
N$89: U$23.2(COM1) X8.2
N$90: U$20.2(COM1) X8.3
N$91: U13.14(VOA) U$23.1
N$92: U13.12(VIC) U$23.3
N$93: U13.11(VID) U$20.3
PP_3.3V_FPGA: C97.1 U13.1(VDD1) U13.7(VE1) ; also sheet 17,19,20,21,23,24,25,26
V4: C96.1 JP8.2 U13.10(VE2) U13.16(VDD2) X8.1
VIAD: U13.3(VIA) U$23.4
VIBD: U13.4(VIB) U$20.4
VOBD: U13.13(VOB) U$20.1
VOCD: U13.5(VOC) U$23.6
VODD: U13.6(VOD) U$20.6

### Notes on the sheet
- FPGA Block
- Modular Connector D With Isolation